# Altium project PPC_notebook_electrical_schematics_v0.7.PrjPcb (part 1 of 14)
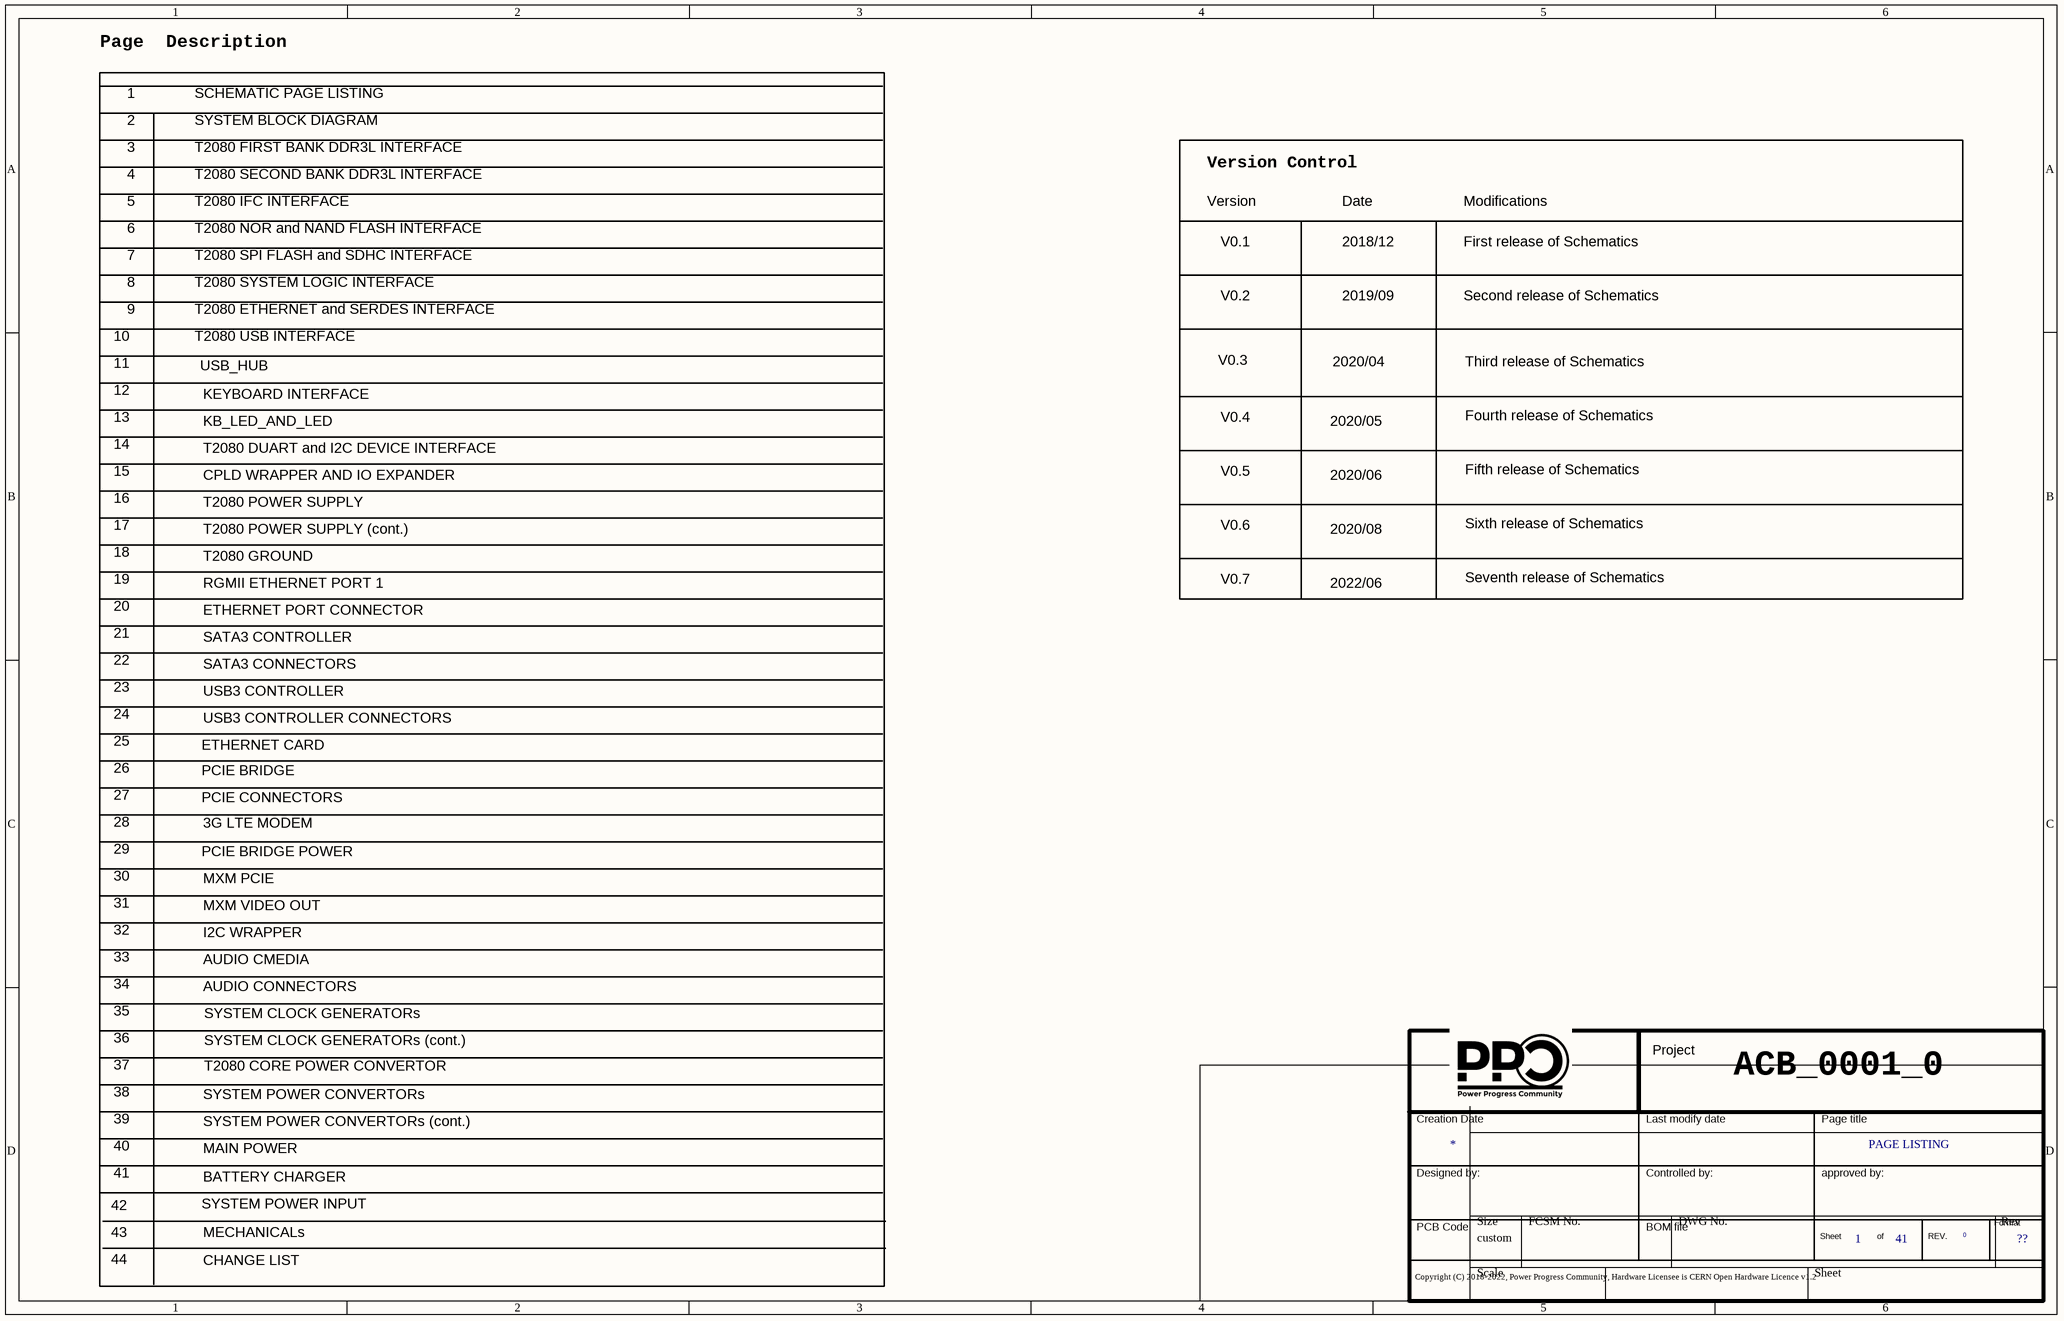
[diagram p0: 01 Page Listing.SchDoc]
44 sheets, 2242 parts. Net scope: flat (ports and power ports of the same name join across sheets).
Sheets:
  01 Page Listing.SchDoc
  02 Block Diagram.SchDoc
  03B_DDR3_2.SchDoc
  03 DDR3.SchDoc
  04 IFC.SchDoc
  05 Flash.SchDoc
  06 SPI&SDHC.SchDoc
  07 SYS.SchDoc
  08 EC&SD.SchDoc
  09A_USB_HUB.SchDoc
  09B KEYBOARD.SchDoc
  09C_KB_LED_AND_LED.SchDoc
  09 USB.SchDoc
  10B_WRAPPER.SchDoc
  10 UART&I2C.SchDoc
  11 Proc Pwr1.SchDoc
  12 Proc Pwr2.SchDoc
  13 Proc Gnd.SchDoc
  14 EC1 PHY.SchDoc
  15_ETHERNET_CONN.SchDoc
  16B Sata Connectors.SchDoc
  16 SATA3 CONTROLLER.SchDoc
  17 USB3 CONTROLLER.SchDoc
  18B_ETHERNET CARD.SchDoc
  18 USB3_ports.SchDoc
  19B WLAN_CONNECTOR.SchDoc
  19C_3G_LTE_MODEM.SchDoc
  19 PCIE BRIDGE.SchDoc
  20 PCIE BRIDGE POWER.SchDoc
  21 MXM_PCIe.SchDoc
  22 MXM_VIDEO_OUT.SchDoc
  23 I2C WRAP.SchDoc
  24 AUDIO CMEDIA.SchDoc
  25 AUDIO_CONN.SchDoc
  26 Clock 1.SchDoc
  27 Clock 2.SchDoc
  28 Core Pwr.SchDoc
  29 Other Pwr 1.SchDoc
  30A Other Pwr 2.SchDoc
  30B Main Power.SchDoc
  30C_battery_Charger.SchDoc
  31 Pwr In.SchDoc
  32 MEC.SchDoc
  33 Change List.SchDoc

## Sheet 01 Page Listing.SchDoc
size 386 x 246 mm

### Parts
(Parts that share a designator on the sheet are numbered #1, #2 ... from top to bottom, then left to right.)
*#1  Doc: PAGE LISTING  Page Count: 41  Page Number: 1  Page Size: ??  RevCode: 0  (hidden comment: Title_block_PPC)  (graphical)

### Notes on the sheet
- Page  Description
- 1
- 2
- SCHEMATIC PAGE LISTING
- SYSTEM BLOCK DIAGRAM
- 3
- 4
- T2080 FIRST BANK DDR3L INTERFACE
- T2080 SECOND BANK DDR3L INTERFACE
- Version Control
- 5
- 6
- 7
- T2080 IFC INTERFACE
- T2080 NOR and NAND FLASH INTERFACE
- T2080 SPI FLASH and SDHC INTERFACE
- Version
- V0.1
- Date
- 2018/12
- Modifications
- First release of Schematics
- 8
- 9
- T2080 SYSTEM LOGIC INTERFACE
- T2080 ETHERNET and SERDES INTERFACE
- V0.2
- 2019/09
- Second release of Schematics
- 10
- 11
- 12
- T2080 USB INTERFACE
- USB_HUB
- KEYBOARD INTERFACE
- V0.3
- 2020/04
- Third release of Schematics
- 13
- 14
- KB_LED_AND_LED
- T2080 DUART and I2C DEVICE INTERFACE
- V0.4
- 2020/05
- Fourth release of Schematics
- 15
- 16
- 17
- CPLD WRAPPER AND IO EXPANDER
- T2080 POWER SUPPLY (cont.)
- T2080 POWER SUPPLY
- V0.5
- V0.6
- 2020/06
- 2020/08
- Fifth release of Schematics
- Sixth release of Schematics
- 18
- 19
- RGMII ETHERNET PORT 1
- T2080 GROUND
- V0.7
- 2022/06
- Seventh release of Schematics
- 20
- 21
- 22
- ETHERNET PORT CONNECTOR
- SATA3 CONTROLLER
- SATA3 CONNECTORS
- 23
- 24
- USB3 CONTROLLER CONNECTORS
- USB3 CONTROLLER
- 25
- 26
- 27
- PCIE CONNECTORS
- PCIE BRIDGE
- ETHERNET CARD
- 28
- 29
- PCIE BRIDGE POWER
- 3G LTE MODEM
- 30
- 31
- 32
- MXM PCIE
- MXM VIDEO OUT
- I2C WRAPPER
- 33
- 34
- AUDIO CMEDIA
- AUDIO CONNECTORS
- 35
- 36
- 37
- T2080 CORE POWER CONVERTOR
- SYSTEM CLOCK GENERATORs (cont.)
- SYSTEM CLOCK GENERATORs
- 38
- 39
- SYSTEM POWER CONVERTORs
- SYSTEM POWER CONVERTORs (cont.)
- ACB_0001_0
- 40
- 41
- SYSTEM POWER INPUT
- MAIN POWER
- BATTERY CHARGER
- 42
- 43
- 44
- MECHANICALs
- CHANGE LIST

### Library data of the parts
*#1 = Title_block_PPC: Title: T2080PCIe; Author: MICETEK; Page Create Date: March  8, 1995; Page Title: ?; Page Modify Date: *

## Sheet 02 Block Diagram.SchDoc
size 1188 x 840 mm
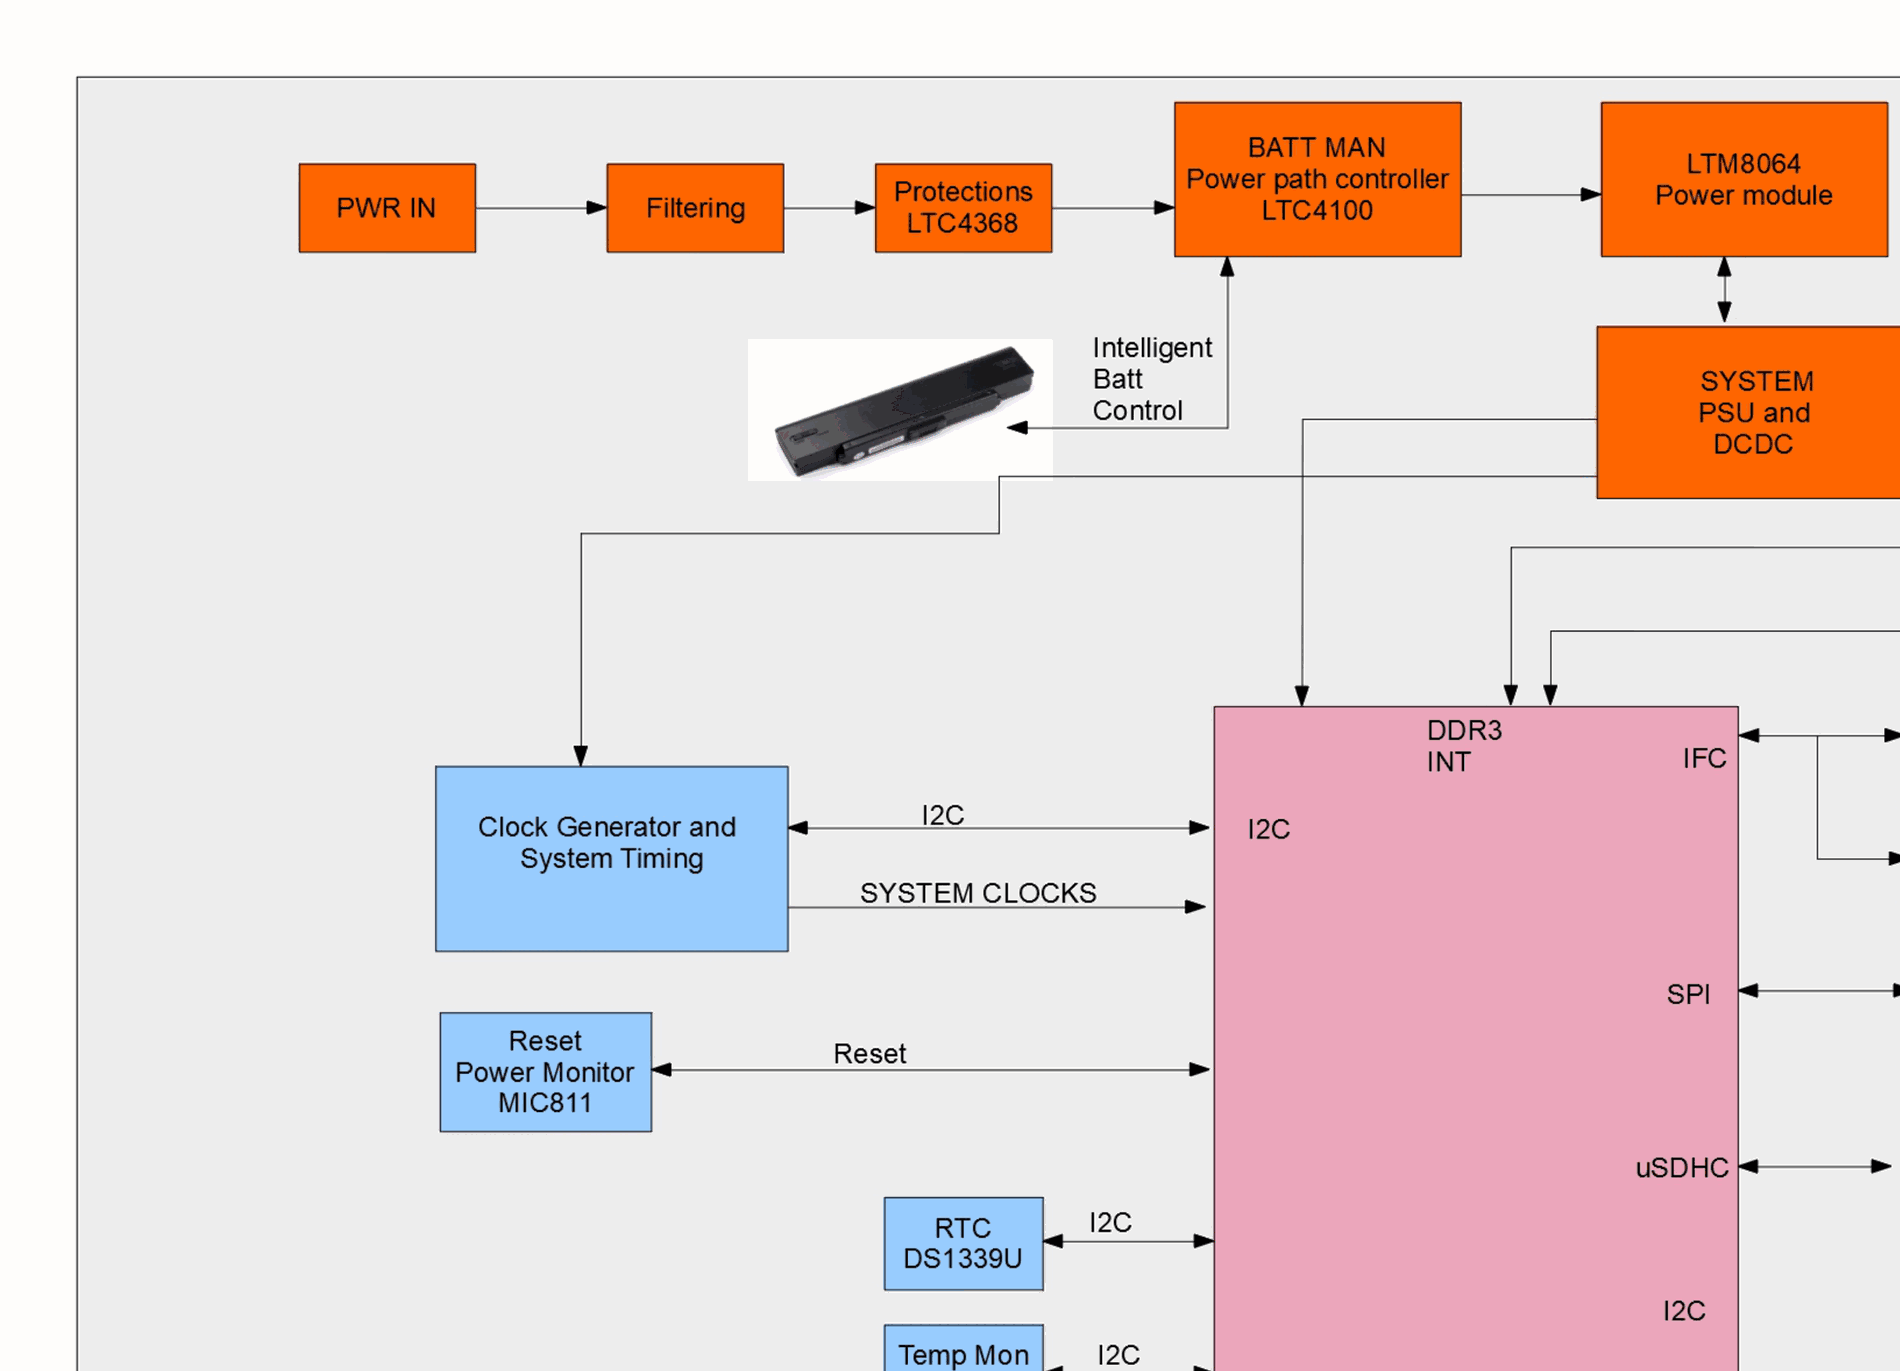
[diagram p1: 02 Block Diagram.SchDoc, top left]
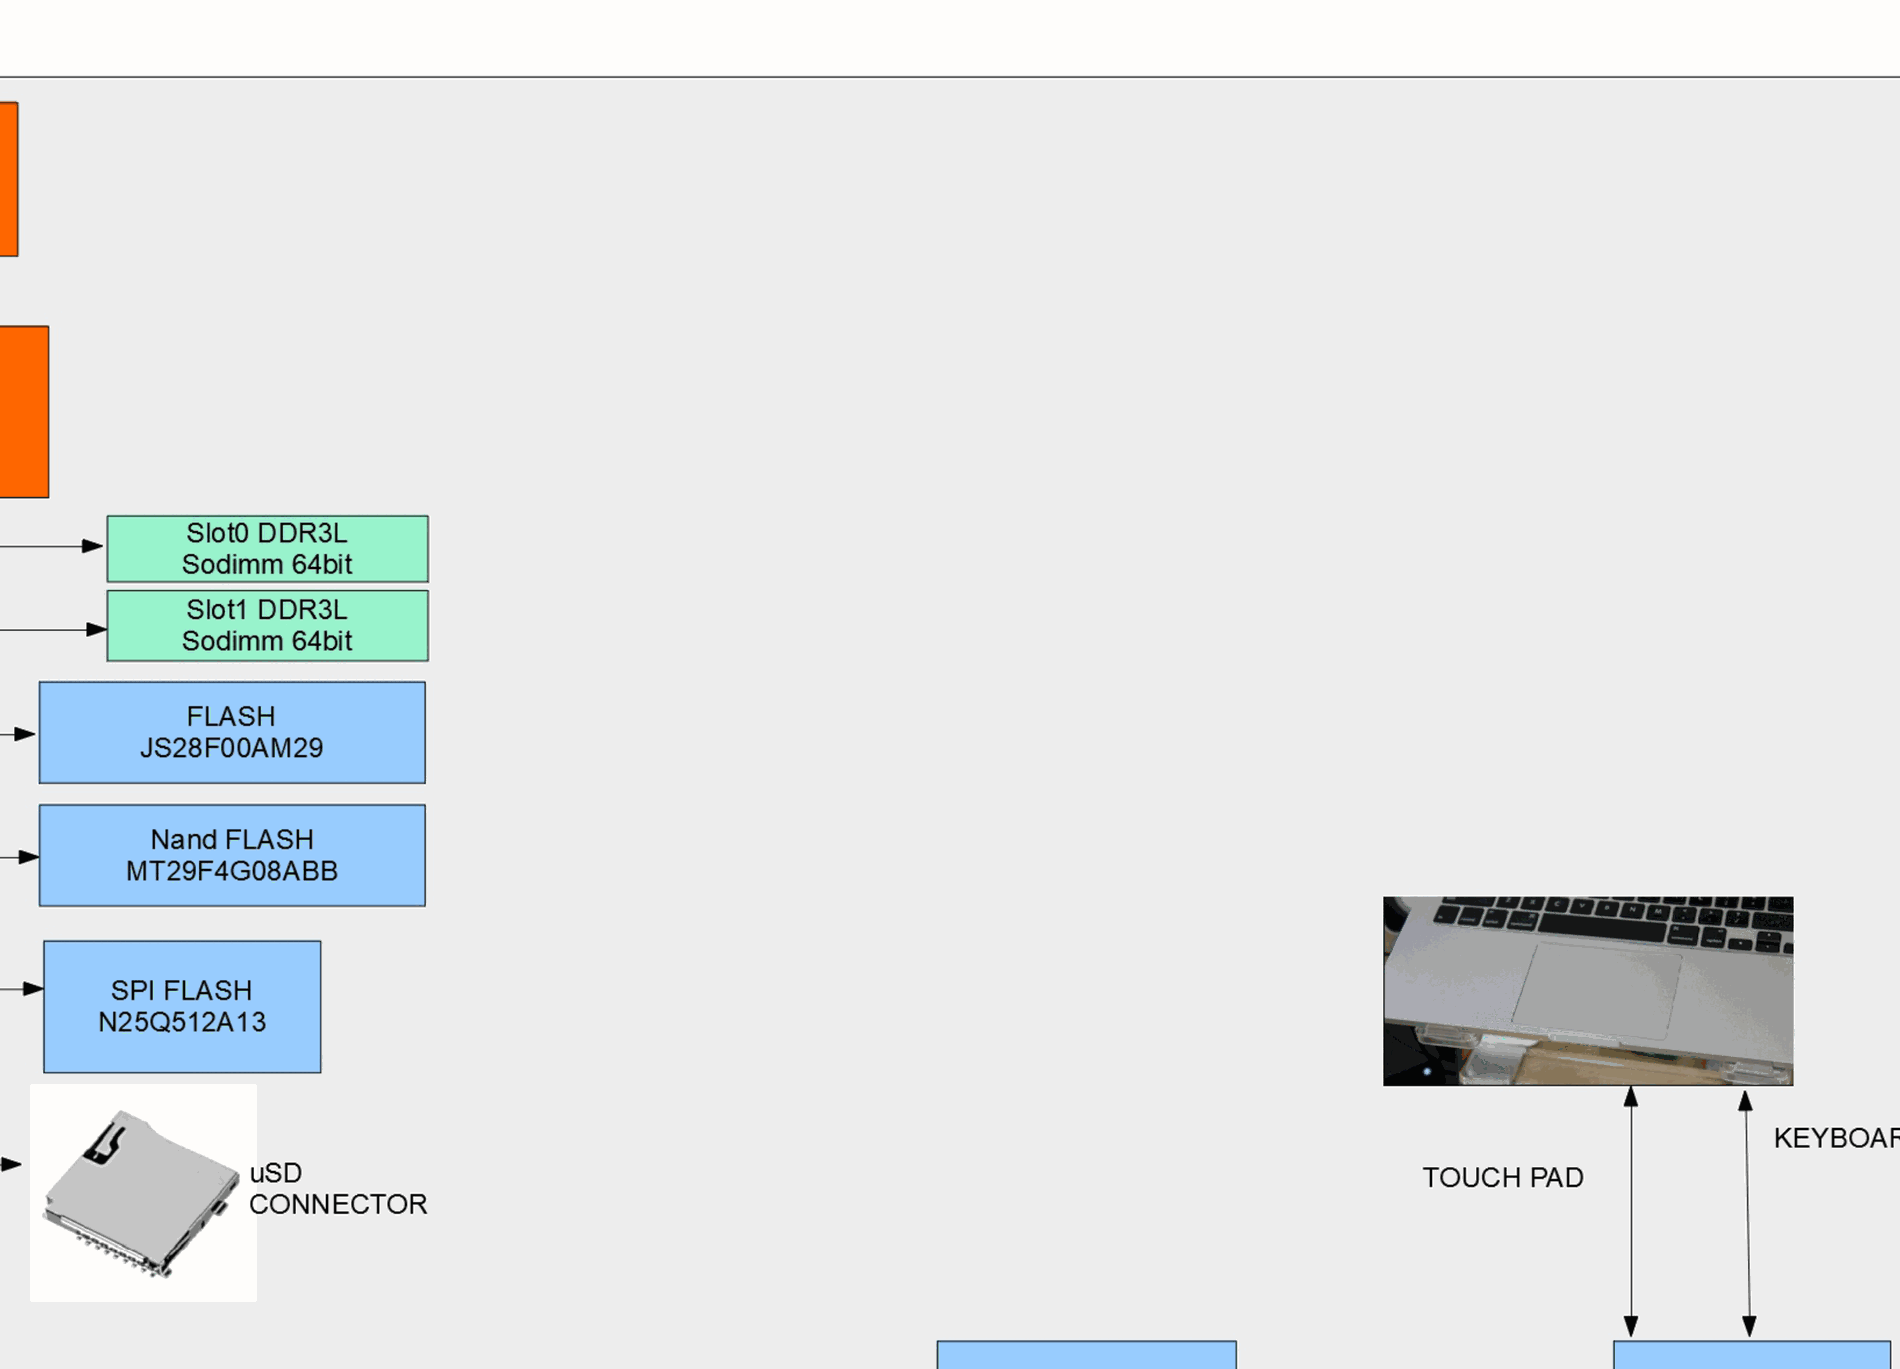
[diagram p2: 02 Block Diagram.SchDoc, top middle]
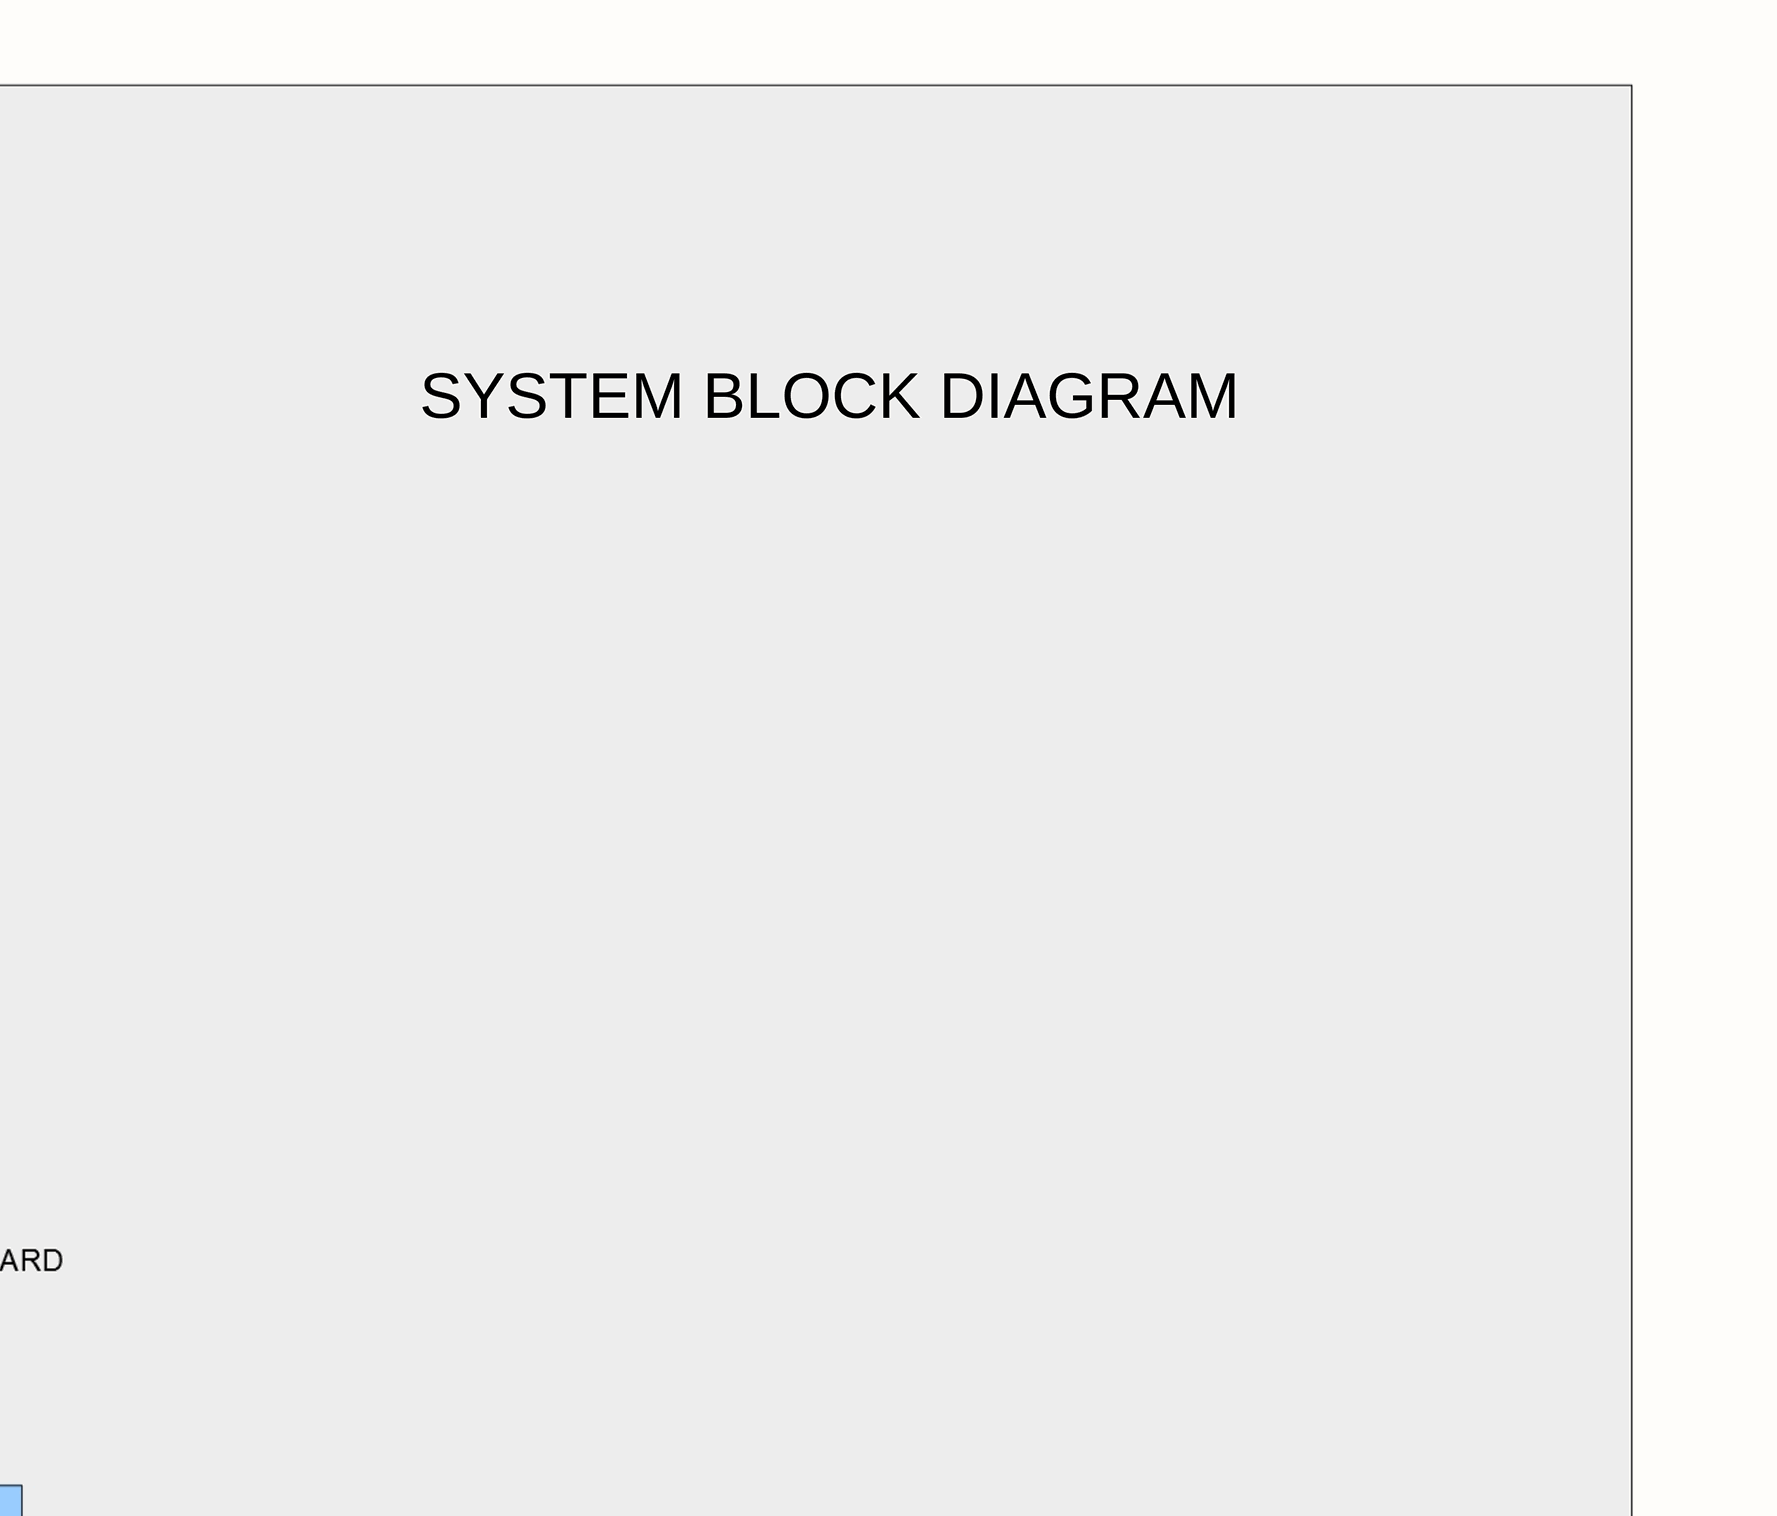
[diagram p3: 02 Block Diagram.SchDoc, top right]
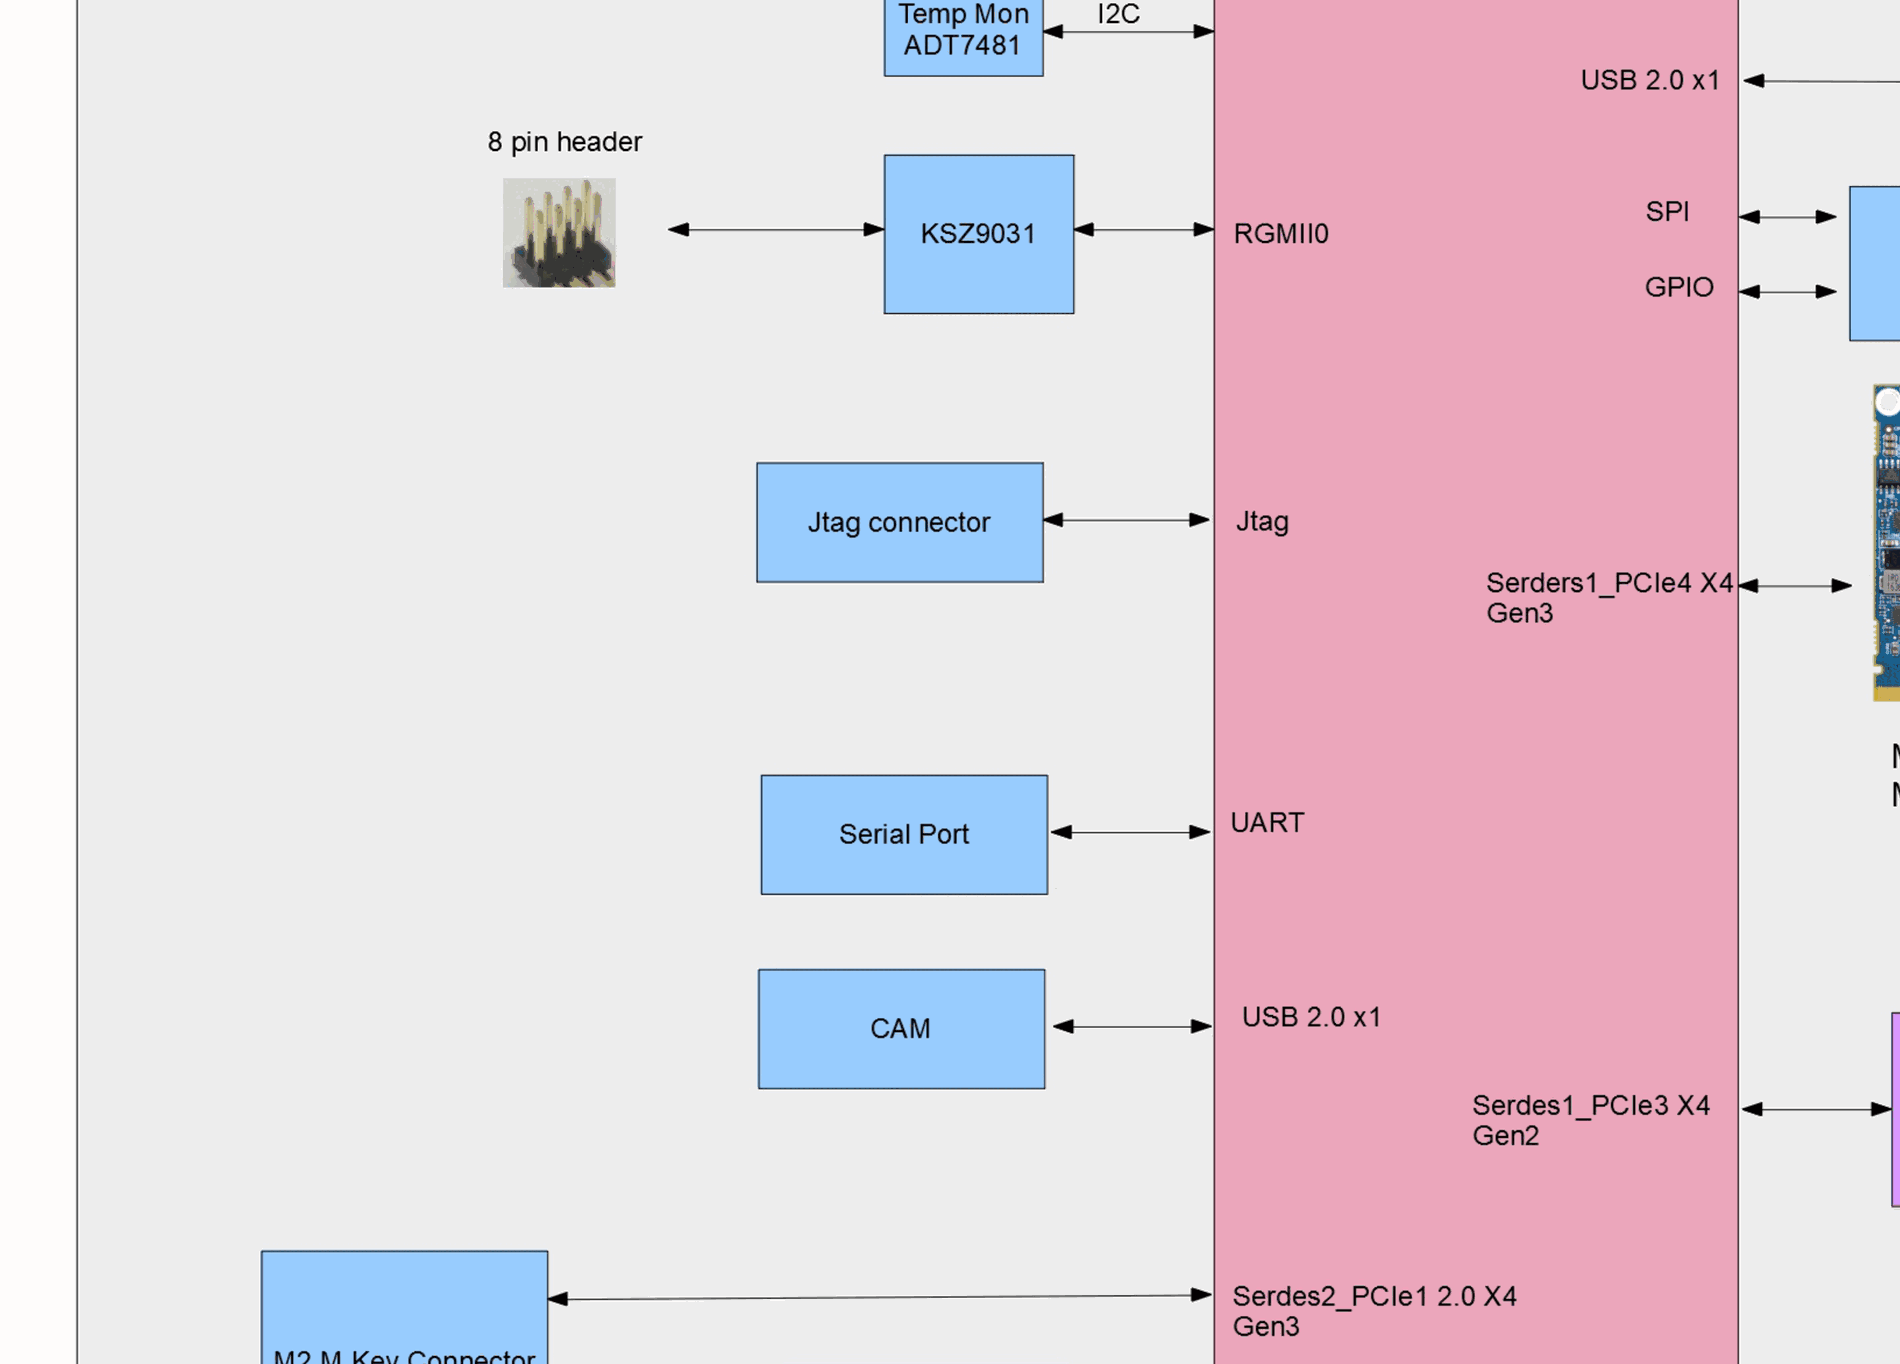
[diagram p4: 02 Block Diagram.SchDoc, centre left]
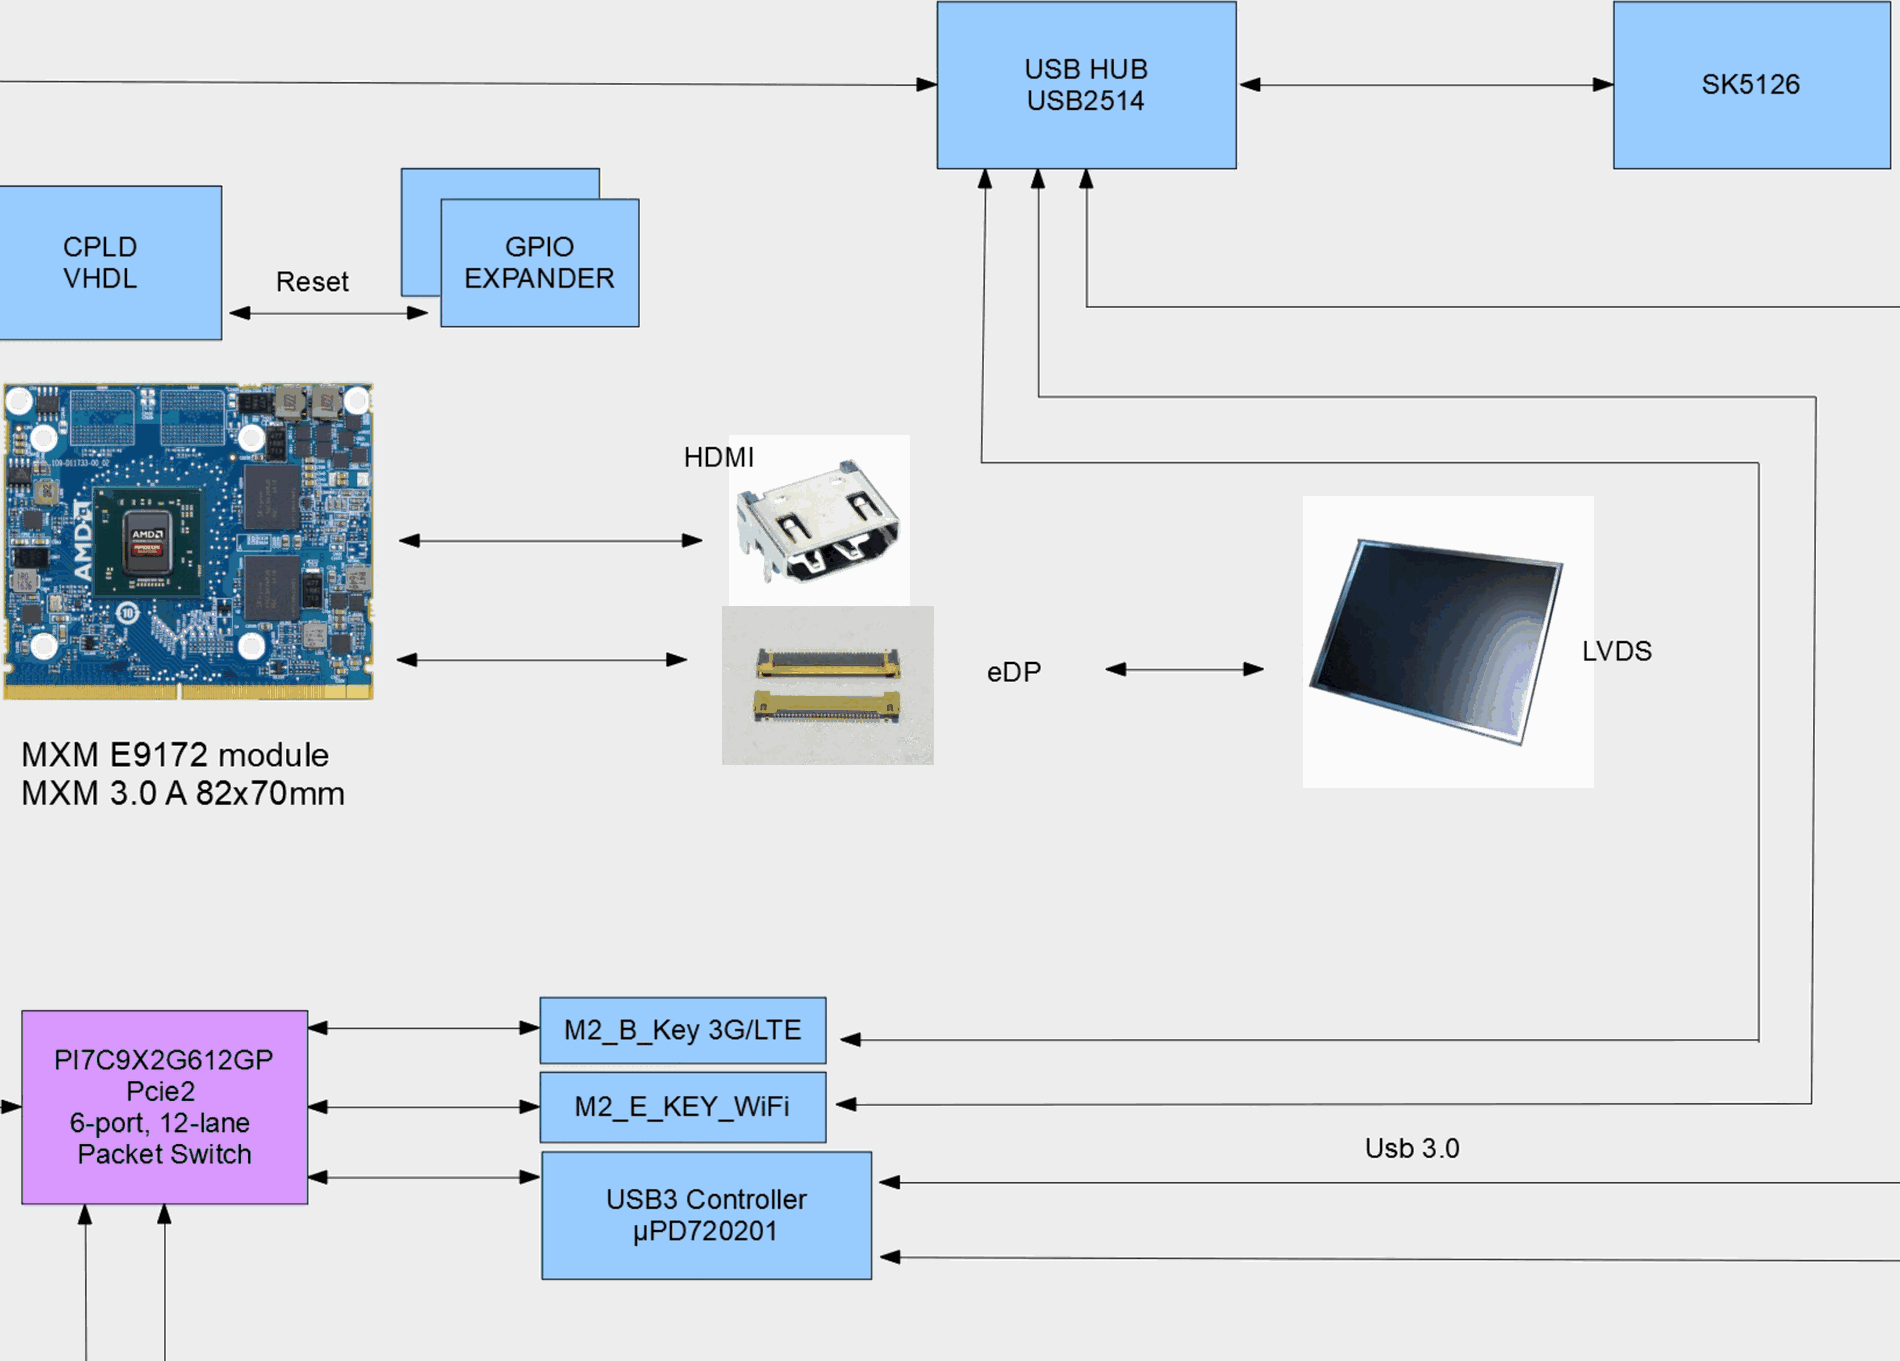
[diagram p5: 02 Block Diagram.SchDoc, centre middle]
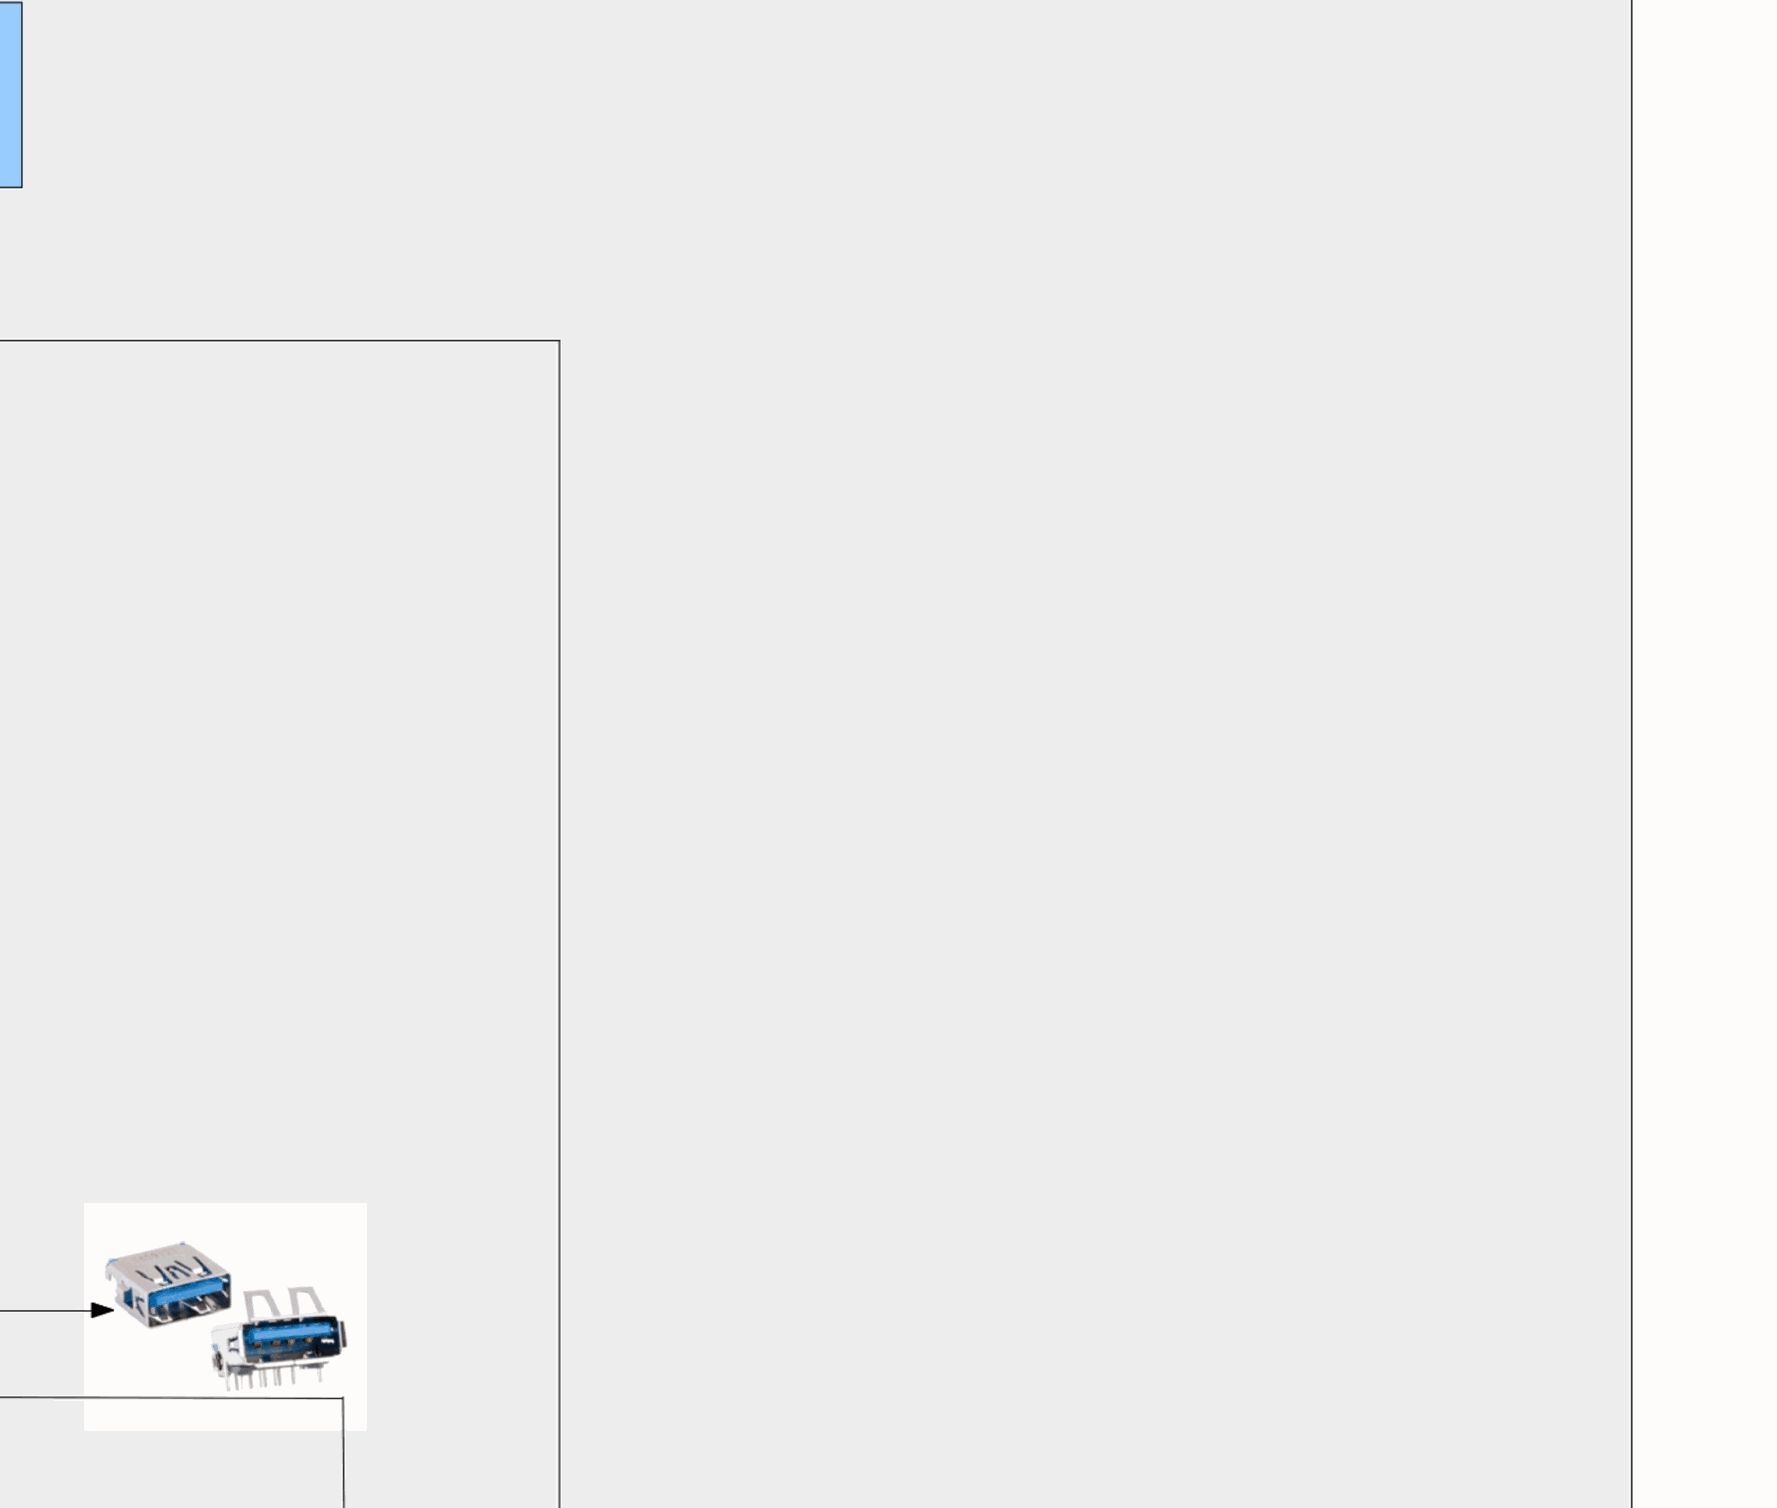
[diagram p6: 02 Block Diagram.SchDoc, centre right]
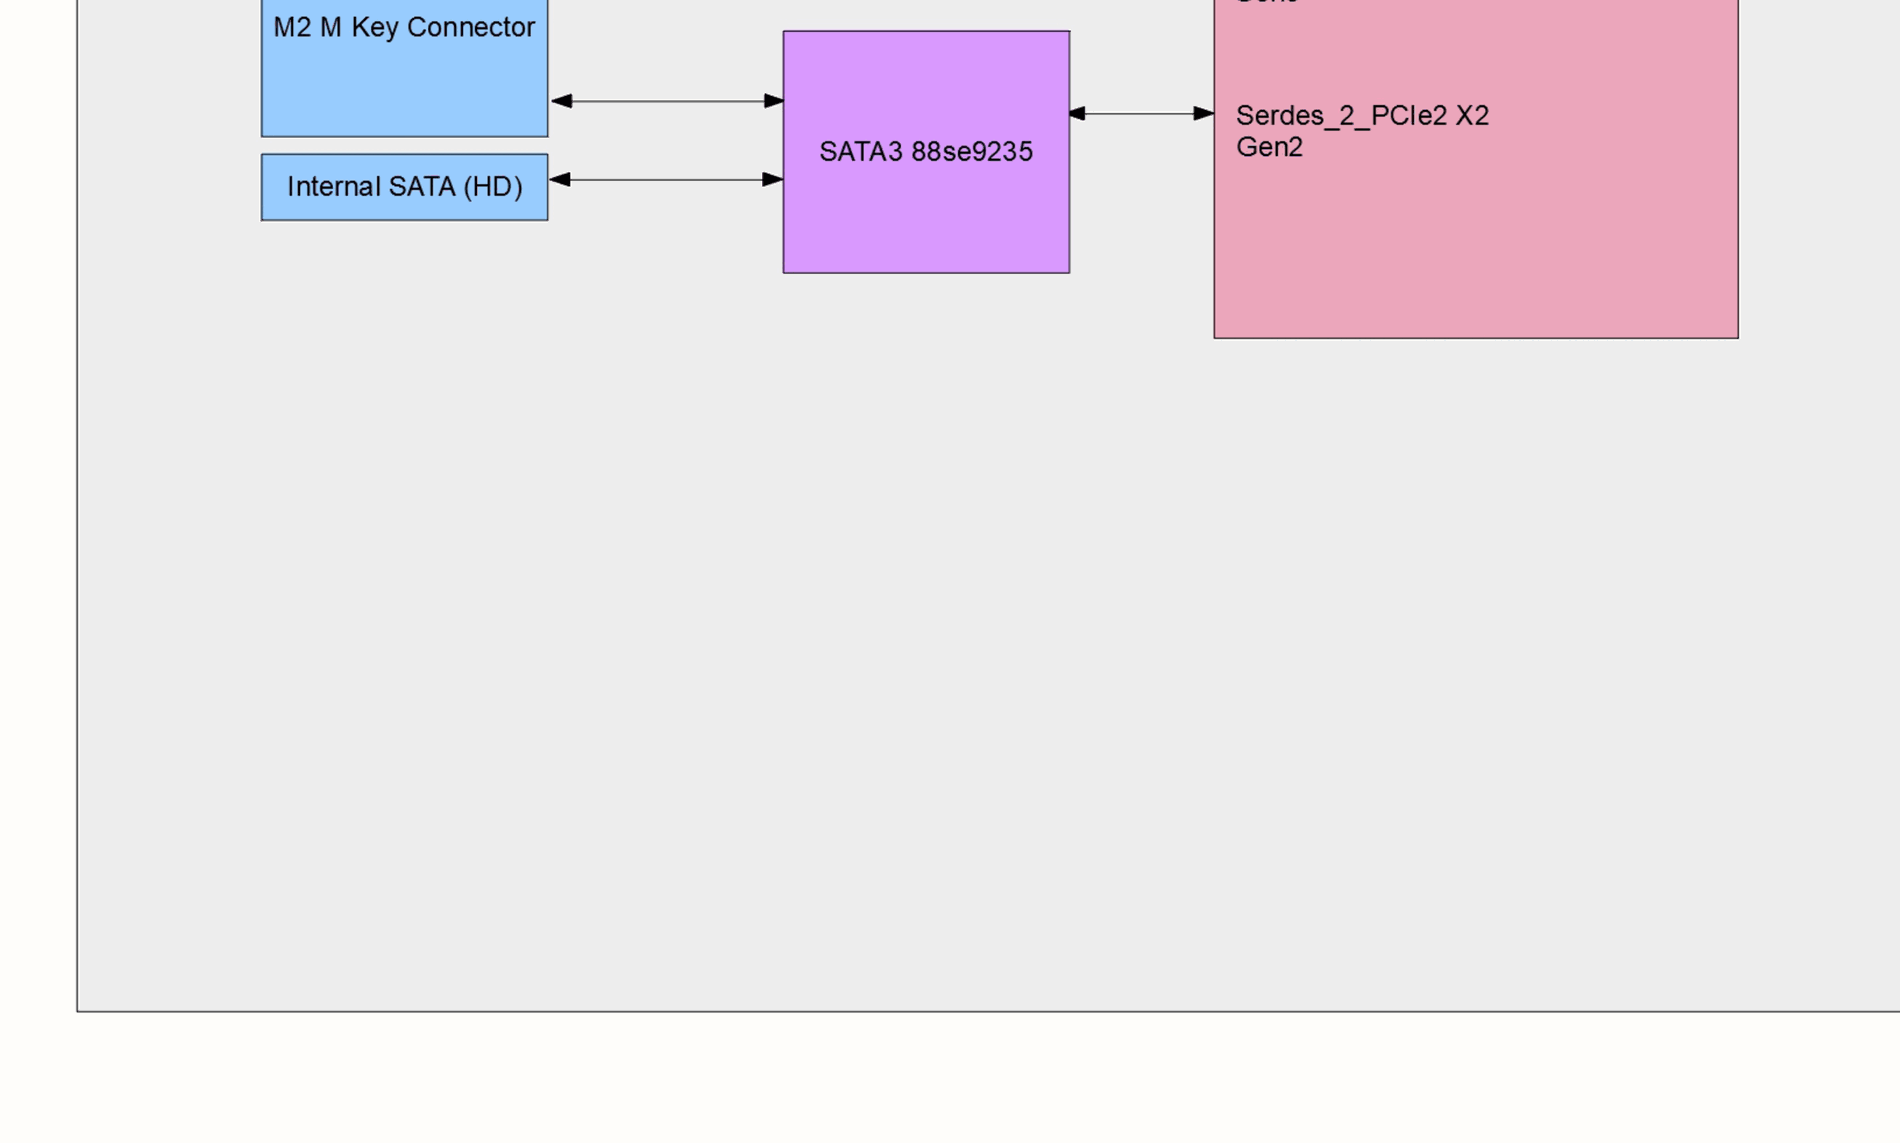
[diagram p7: 02 Block Diagram.SchDoc, bottom left]
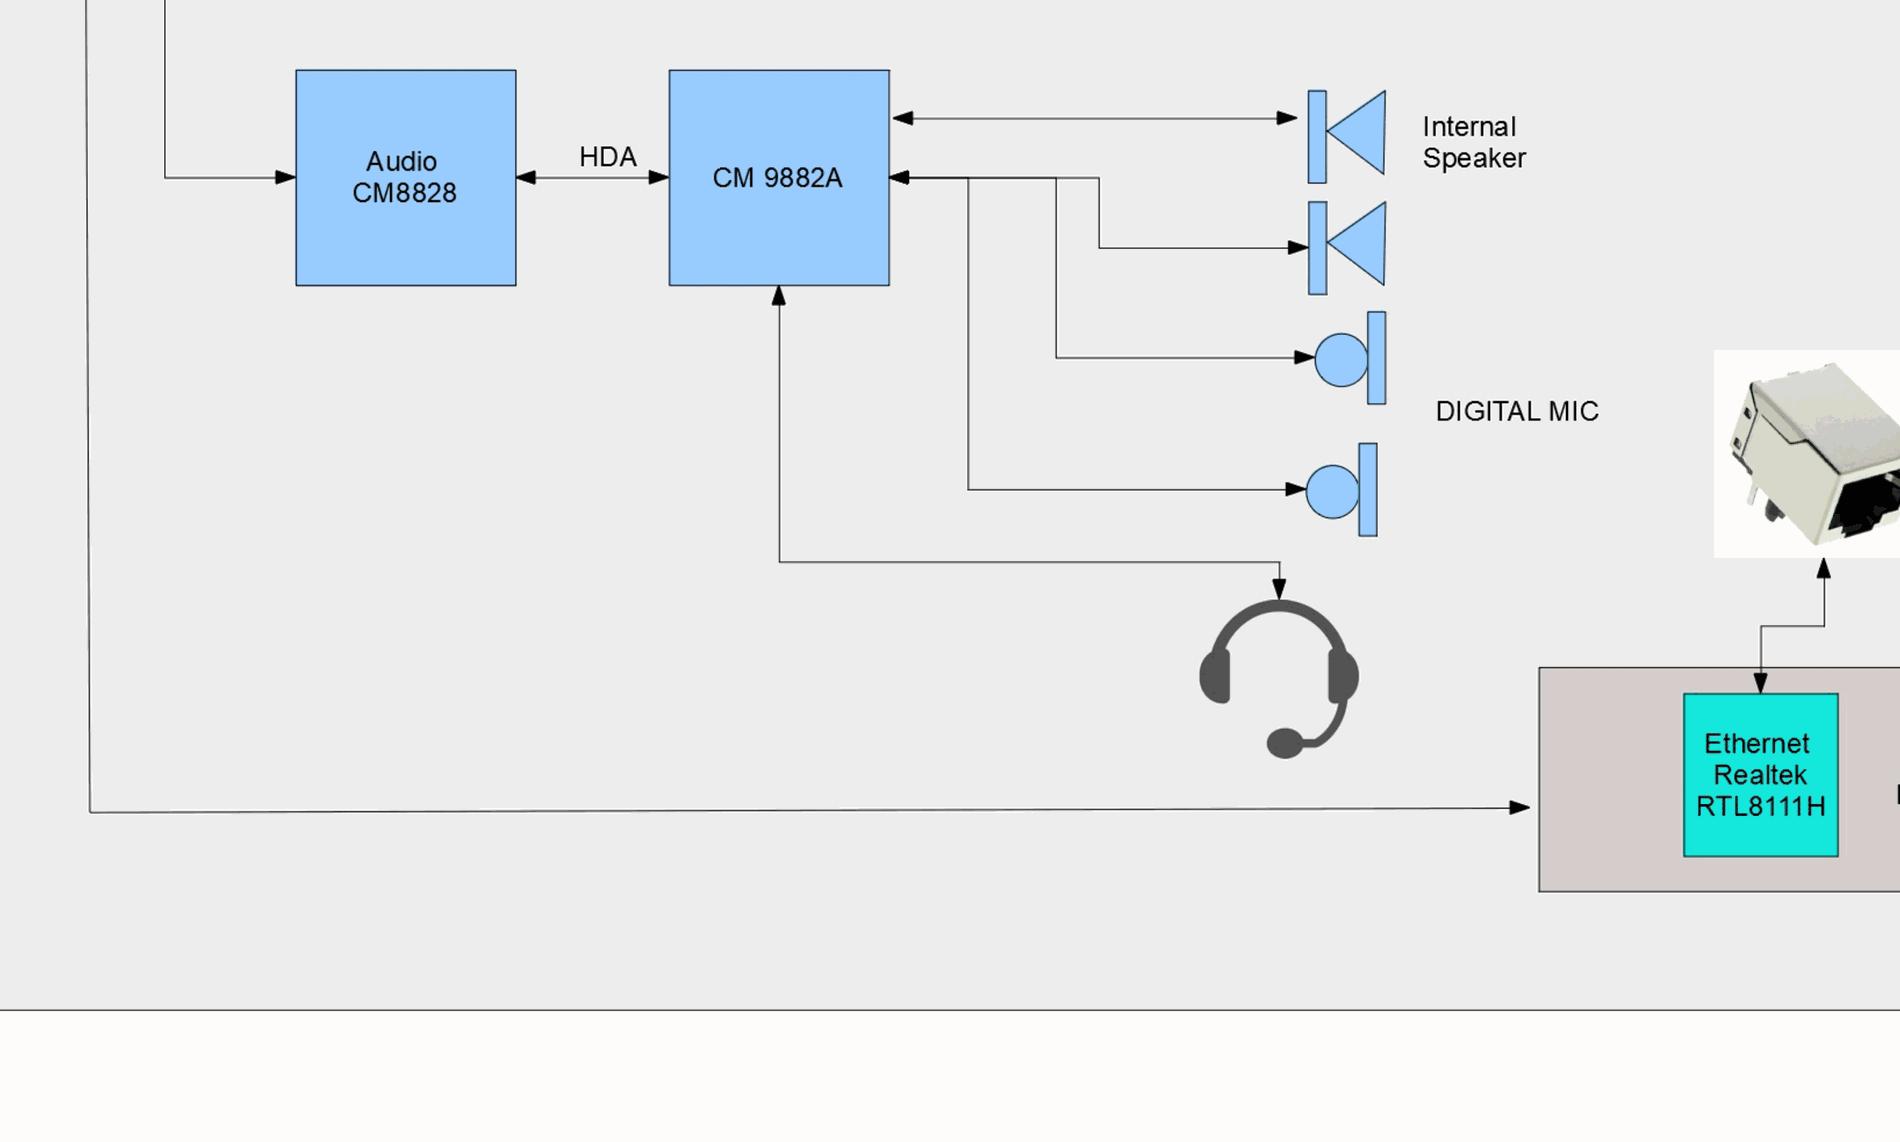
[diagram p8: 02 Block Diagram.SchDoc, bottom middle]
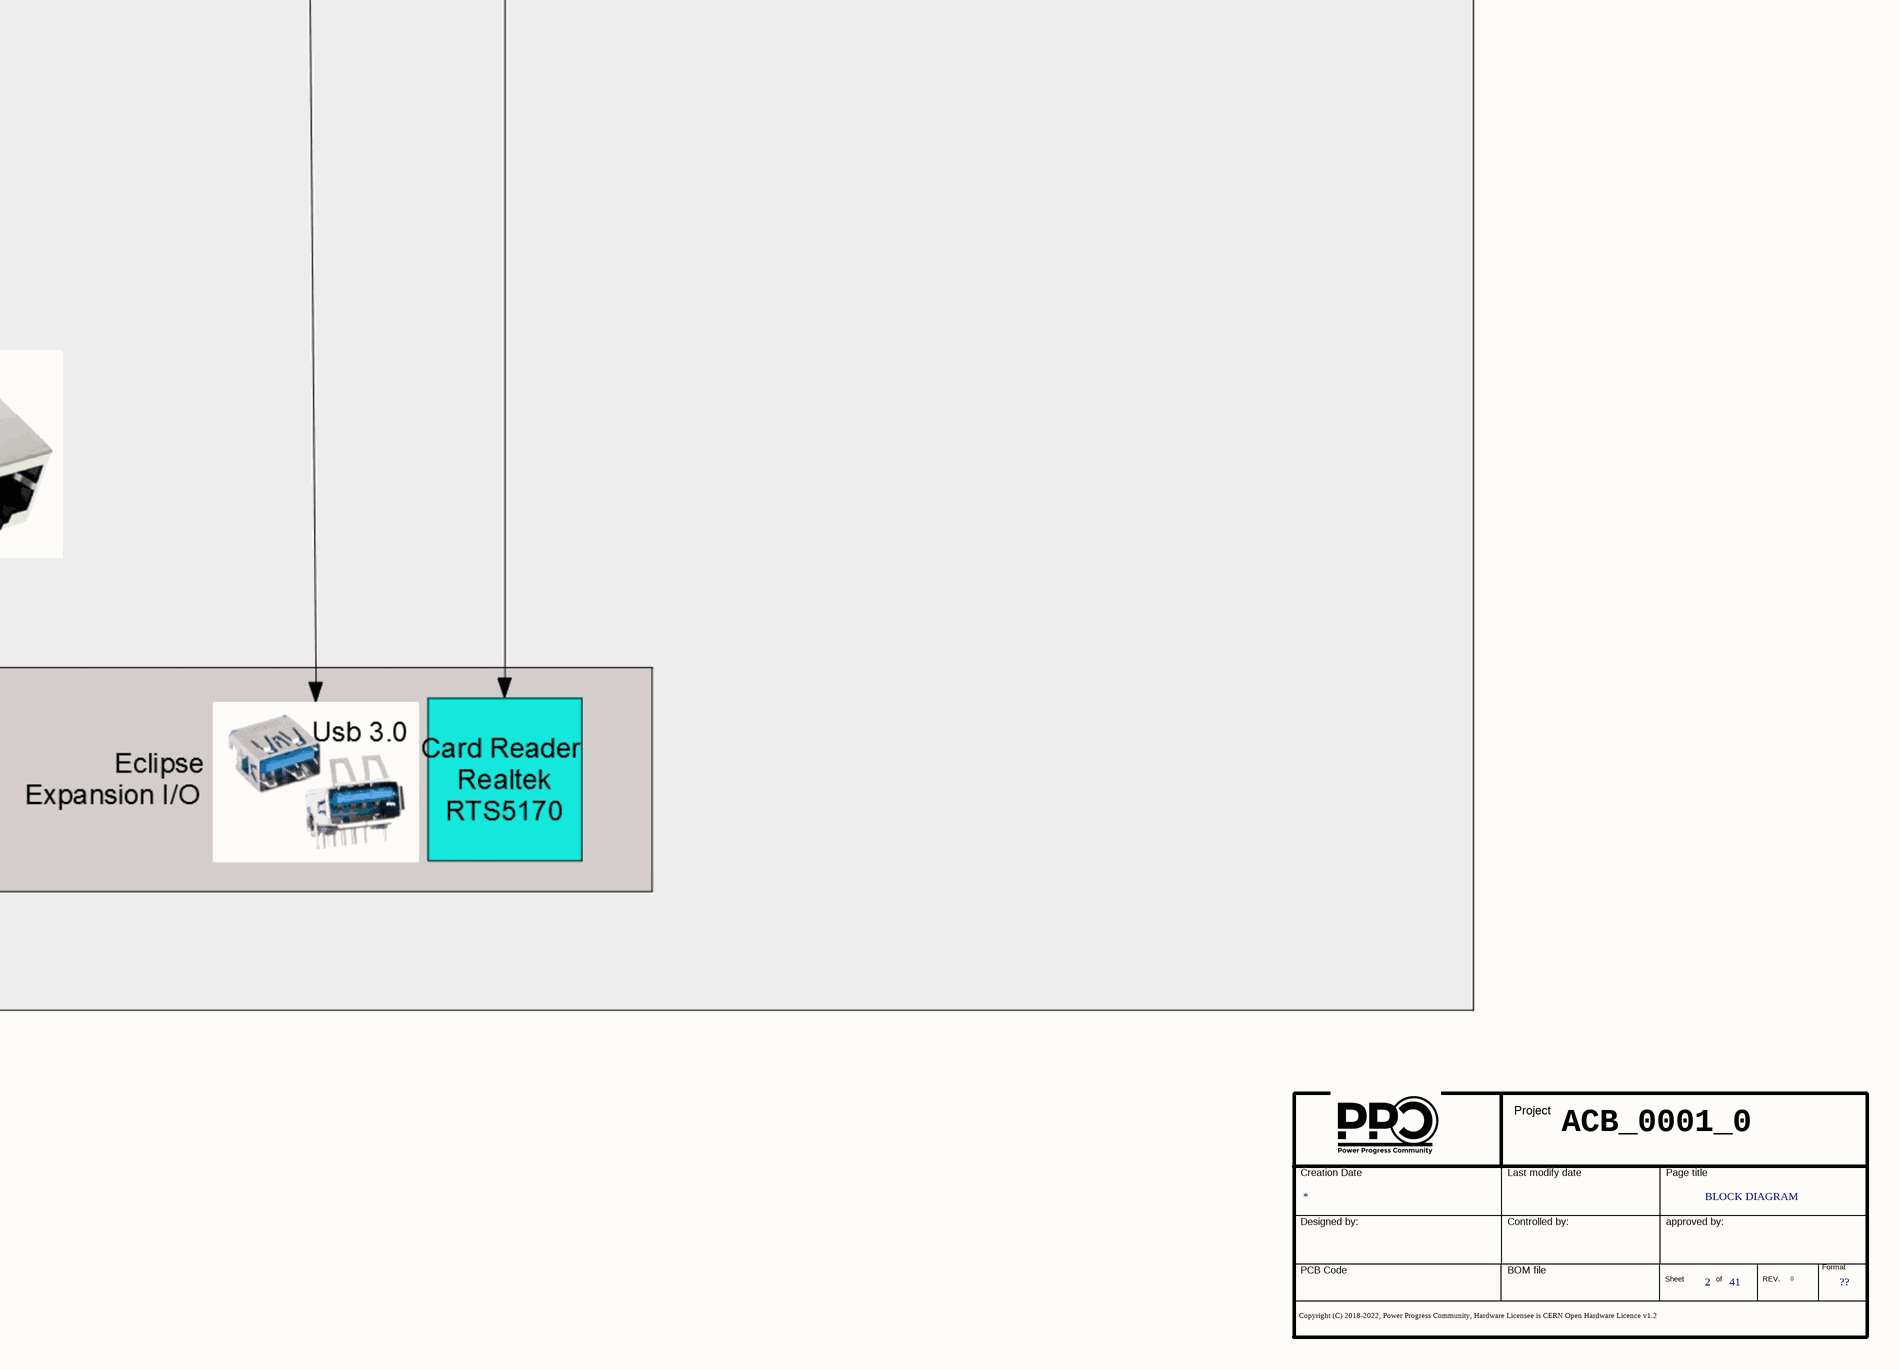
[diagram p9: 02 Block Diagram.SchDoc, bottom right]

### Parts
(Parts that share a designator on the sheet are numbered #1, #2 ... from top to bottom, then left to right.)
*#2  Doc: BLOCK DIAGRAM  Page Count: 41  Page Number: 2  Page Size: ??  RevCode: 0  (hidden comment: Title_block_PPC)  (graphical)

### Notes on the sheet
- SYSTEM BLOCK DIAGRAM
- ACB_0001_0

### Library data of the parts
*#2 = Title_block_PPC: Title: T2080PCIe; Author: MICETEK; Page Create Date: March  8, 1995; Page Title: ?; Page Modify Date: *

## Sheet 03B_DDR3_2.SchDoc
size 420 x 297 mm
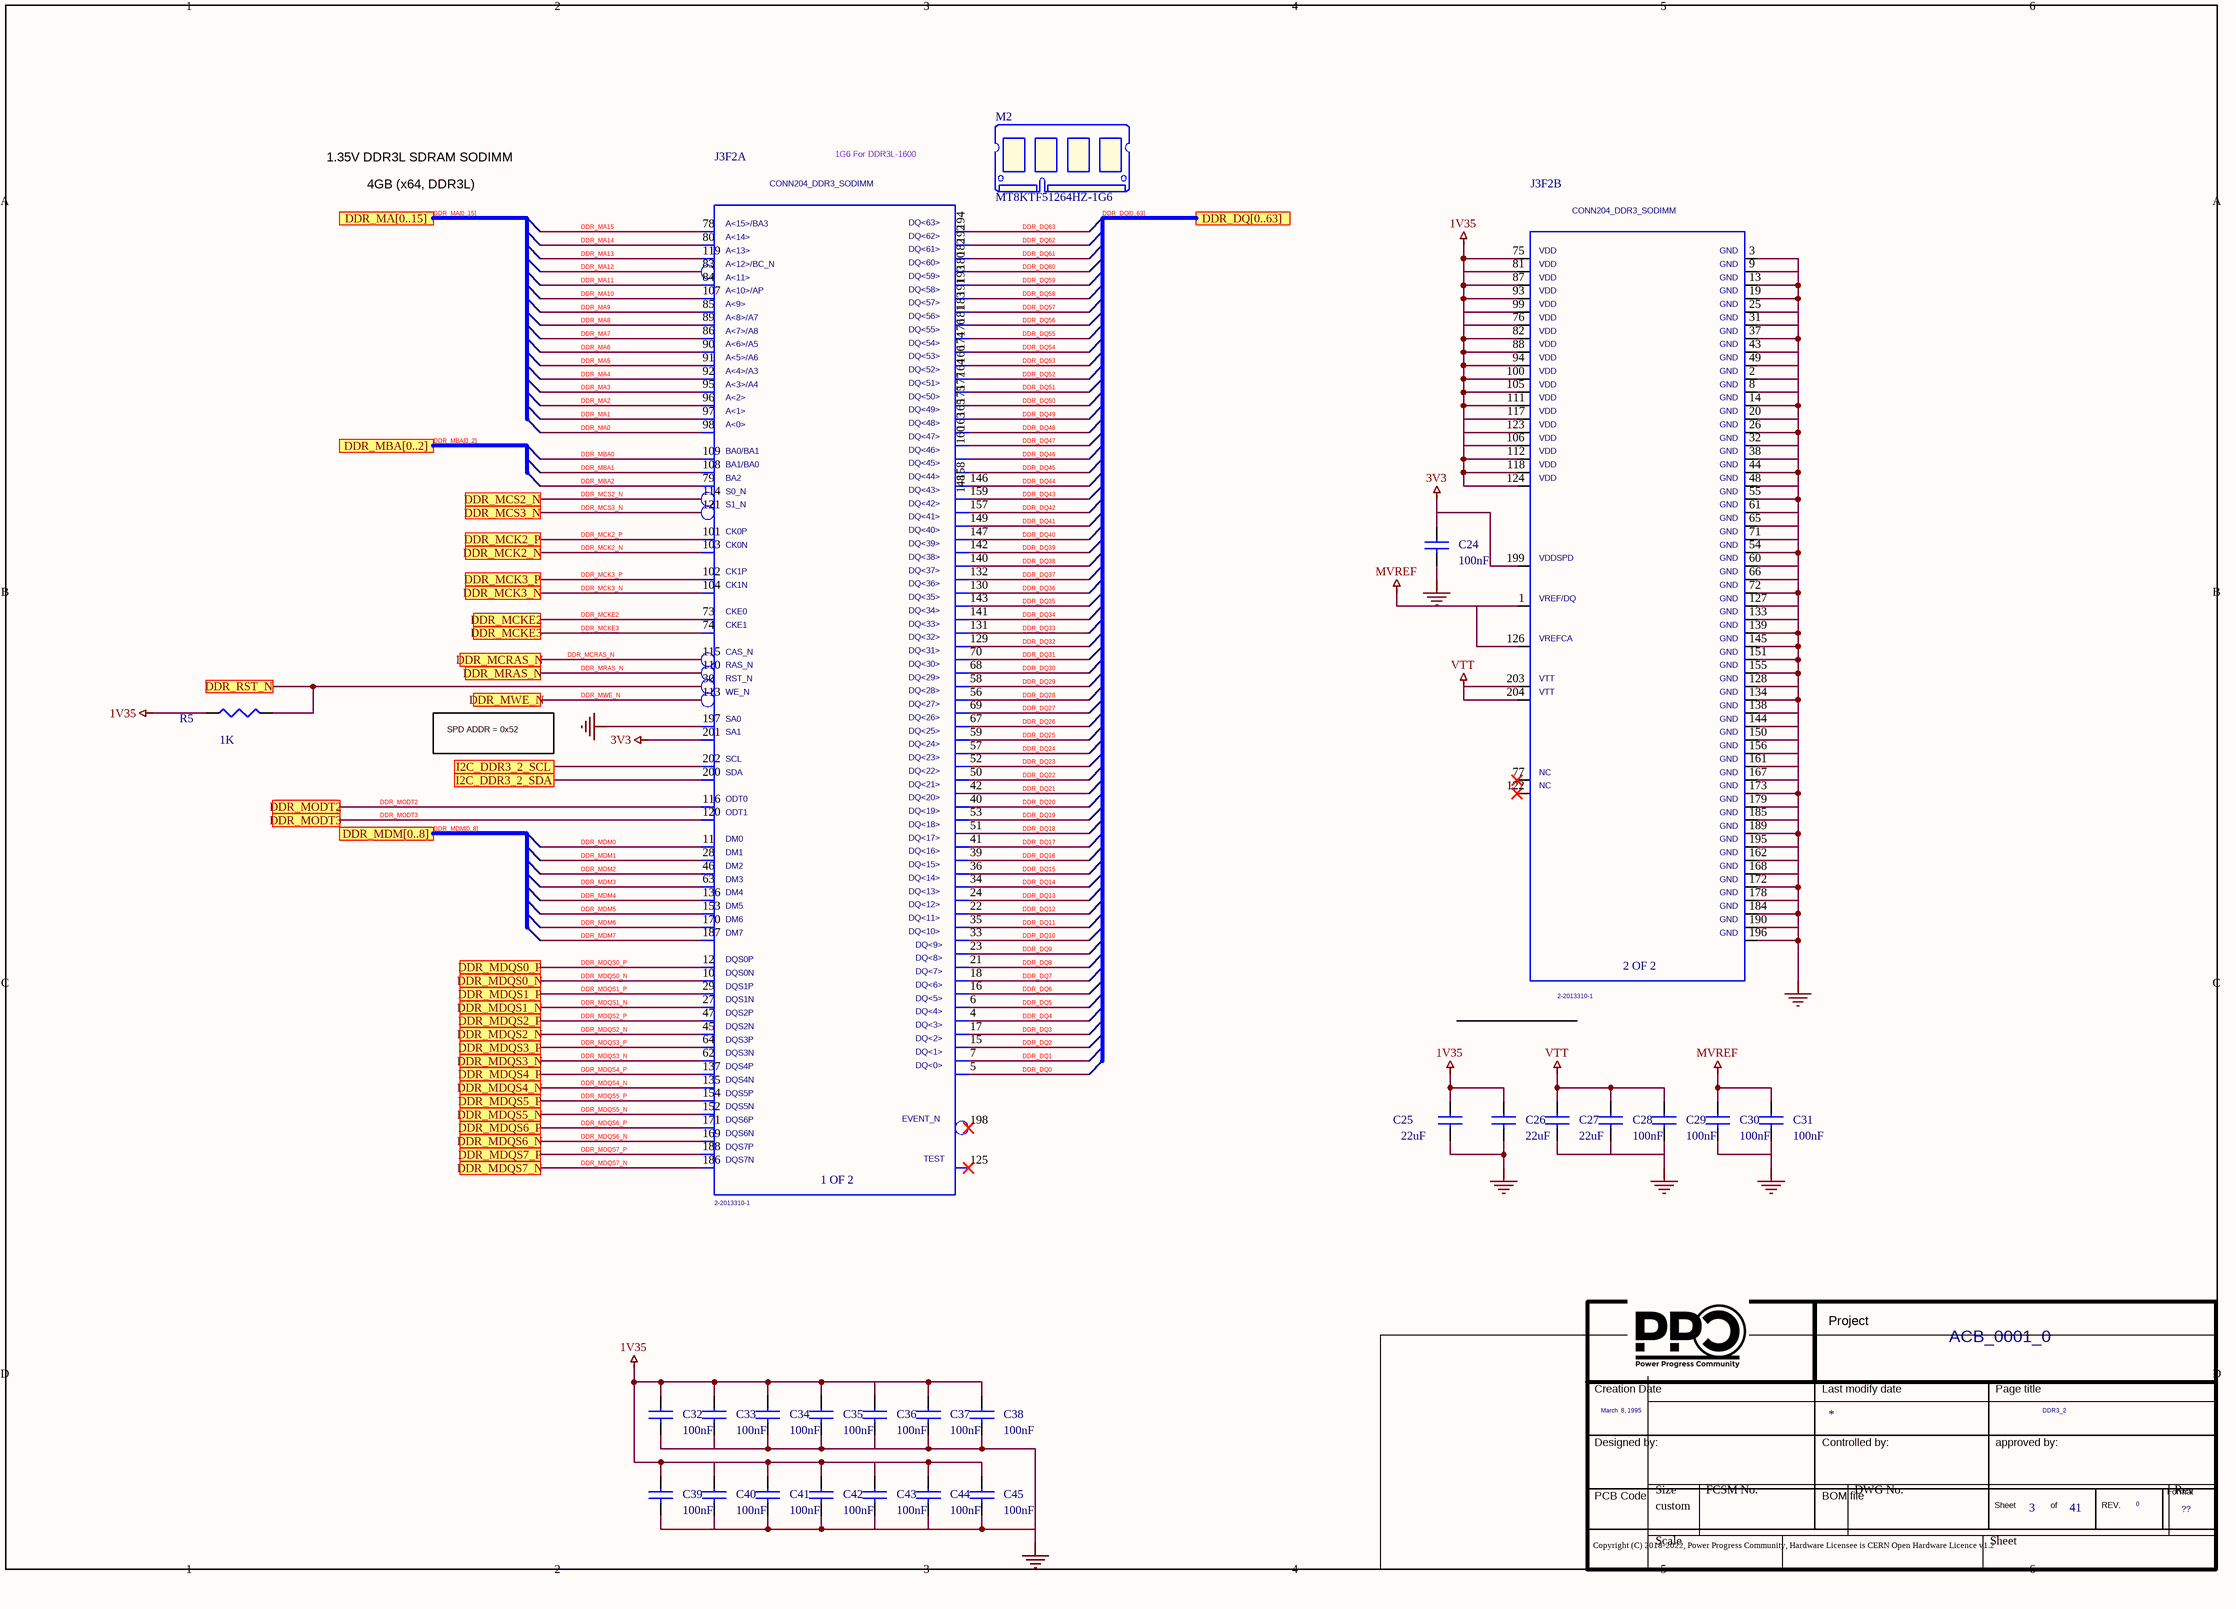
[diagram p10: 03B_DDR3_2.SchDoc]

### Parts
(Parts that share a designator on the sheet are numbered #1, #2 ... from top to bottom, then left to right.)
*#3  Page Count: 41  Page Create Date: March  8, 1995  Page Number: 3  Page Size: ??  Page Title: DDR3_2  RevCode: 0  Title: ACB_0001_0  (hidden comment: Title_block_PPC)  (graphical)
C24  100nF  [SMD_0402]
C25  22uF  [SMD_0805]
C26  22uF  [SMD_0805]
C27  22uF  [SMD_0805]
C28  100nF  [SMD_0402]
C29  100nF  [SMD_0402]
C30  100nF  [SMD_0402]
C31  100nF  [SMD_0402]
C32  100nF  [SMD_0402]
C33  100nF  [SMD_0402]
C34  100nF  [SMD_0402]
C35  100nF  [SMD_0402]
C36  100nF  [SMD_0402]
C37  100nF  [SMD_0402]
C38  100nF  [SMD_0402]
C39  100nF  [SMD_0402]
C40  100nF  [SMD_0402]
C41  100nF  [SMD_0402]
C42  100nF  [SMD_0402]
C43  100nF  [SMD_0402]
C44  100nF  [SMD_0402]
C45  100nF  [SMD_0402]
J3F2  2-2013310-1  PART_SYM_NUM: 1 OF 2  [204 PIN PASSO 0.6mm]  (parts A,B of 2)
M2  MT8KTF51264HZ-1G6  [none]
R5  1K  [SMD_0402]

### Ports
DDR_DQ[0..63], DDR_MA[0..15], DDR_MBA[0..2], DDR_MCK2_N, DDR_MCK2_P, DDR_MCK3_N, DDR_MCK3_P, DDR_MCKE2, DDR_MCKE3, DDR_MCRAS_N, DDR_MCS2_N, DDR_MCS3_N, DDR_MDM[0..8], DDR_MDQS0_N, DDR_MDQS0_P, DDR_MDQS1_N, DDR_MDQS1_P, DDR_MDQS2_N, DDR_MDQS2_P, DDR_MDQS3_N, DDR_MDQS3_P, DDR_MDQS4_N, DDR_MDQS4_P, DDR_MDQS5_N, DDR_MDQS5_P, DDR_MDQS6_N, DDR_MDQS6_P, DDR_MDQS7_N, DDR_MDQS7_P, DDR_MODT2, DDR_MODT3, DDR_MRAS_N, DDR_MWE_N, DDR_RST_N, I2C_DDR3_2_SCL, I2C_DDR3_2_SDA

### Nets
1V35: C25.1 C26.1 C32.1 C33.1 C34.1 C35.1 C36.1 C37.1 C38.1 C39.1 C40.1 C41.1 C42.1 C43.1 C44.1 C45.1 J3F2.75(VDD_75) J3F2.76(VDD_76) J3F2.81(VDD_81) J3F2.82(VDD_82) J3F2.87(VDD_87) J3F2.88(VDD_88) J3F2.93(VDD_93) J3F2.94(VDD_94) J3F2.99(VDD_99) J3F2.100(VDD_100) J3F2.105(VDD_105) J3F2.106(VDD_106) J3F2.111(VDD_111) J3F2.112(VDD_112) J3F2.117(VDD_117) J3F2.118(VDD_118) J3F2.123(VDD_123) J3F2.124(VDD_124) R5.1
3V3: C24.1 J3F2.199(VDDSPD) J3F2.201(SA1)
GND: C24.2 C25.2 C26.2 C27.2 C28.2 C29.2 C30.2 C31.2 C32.2 C33.2 C34.2 C35.2 C36.2 C37.2 C38.2 C39.2 C40.2 C41.2 C42.2 C43.2 C44.2 C45.2 J3F2.2(GND_2) J3F2.3(GND_3) J3F2.8(GND_8) J3F2.9(GND_9) J3F2.13(GND_13) J3F2.14(GND_14) J3F2.19(GND_19) J3F2.20(GND_20) J3F2.25(GND_25) J3F2.26(GND_26) J3F2.31(GND_31) J3F2.32(GND_32) J3F2.37(GND_37) J3F2.38(GND_38) J3F2.43(GND_43) J3F2.44(GND_44) J3F2.48(GND_48) J3F2.49(GND_49) J3F2.54(GND_54) J3F2.55(GND_55) J3F2.60(GND_60) J3F2.61(GND_61) J3F2.65(GND_65) J3F2.66(GND_66) J3F2.71(GND_71) J3F2.72(GND_72) J3F2.127(GND_127) J3F2.128(GND_128) J3F2.133(GND_133) J3F2.134(GND_134) J3F2.138(GND_138) J3F2.139(GND_139) J3F2.144(GND_144) J3F2.145(GND_145) J3F2.150(GND_150) J3F2.151(GND_151) J3F2.155(GND_155) J3F2.156(GND_156) J3F2.161(GND_161) J3F2.162(GND_162) J3F2.167(GND_167) J3F2.168(GND_168) J3F2.172(GND_172) J3F2.173(GND_173) J3F2.178(GND_178) J3F2.179(GND_179) J3F2.184(GND_184) J3F2.185(GND_185) J3F2.189(GND_189) J3F2.190(GND_190) J3F2.195(GND_195) J3F2.196(GND_196) J3F2.197(SA0)
MVREF: C30.1 C31.1 J3F2.1(VREF_DQ) J3F2.126(VREFCA)
VTT: C27.1 C28.1 C29.1 J3F2.203(VTT_203) J3F2.204(VTT_204)
DDR_DQ0: J3F2.5(DQ[0])
DDR_DQ1: J3F2.7(DQ[1])
DDR_DQ2: J3F2.15(DQ[2])
DDR_DQ3: J3F2.17(DQ[3])
DDR_DQ4: J3F2.4(DQ[4])
DDR_DQ5: J3F2.6(DQ[5])
DDR_DQ6: J3F2.16(DQ[6])
DDR_DQ7: J3F2.18(DQ[7])
DDR_DQ8: J3F2.21(DQ[8])
DDR_DQ9: J3F2.23(DQ[9])
DDR_DQ10: J3F2.33(DQ[10])
DDR_DQ11: J3F2.35(DQ[11])
DDR_DQ12: J3F2.22(DQ[12])
DDR_DQ13: J3F2.24(DQ[13])
DDR_DQ14: J3F2.34(DQ[14])
DDR_DQ15: J3F2.36(DQ[15])
DDR_DQ16: J3F2.39(DQ[16])
DDR_DQ17: J3F2.41(DQ[17])
DDR_DQ18: J3F2.51(DQ[18])
DDR_DQ19: J3F2.53(DQ[19])
DDR_DQ20: J3F2.40(DQ[20])
DDR_DQ21: J3F2.42(DQ[21])
DDR_DQ22: J3F2.50(DQ[22])
DDR_DQ23: J3F2.52(DQ[23])
DDR_DQ24: J3F2.57(DQ[24])
DDR_DQ25: J3F2.59(DQ[25])
DDR_DQ26: J3F2.67(DQ[26])
DDR_DQ27: J3F2.69(DQ[27])
DDR_DQ28: J3F2.56(DQ[28])
DDR_DQ29: J3F2.58(DQ[29])
DDR_DQ30: J3F2.68(DQ[30])
DDR_DQ31: J3F2.70(DQ[31])
DDR_DQ32: J3F2.129(DQ[32])
DDR_DQ33: J3F2.131(DQ[33])
DDR_DQ34: J3F2.141(DQ[34])
DDR_DQ35: J3F2.143(DQ[35])
DDR_DQ36: J3F2.130(DQ[36])
DDR_DQ37: J3F2.132(DQ[37])
DDR_DQ38: J3F2.140(DQ[38])
DDR_DQ39: J3F2.142(DQ[39])
DDR_DQ40: J3F2.147(DQ[40])
DDR_DQ41: J3F2.149(DQ[41])
DDR_DQ42: J3F2.157(DQ[42])
DDR_DQ43: J3F2.159(DQ[43])
DDR_DQ44: J3F2.146(DQ[44])
DDR_DQ45: J3F2.148(DQ[45])
DDR_DQ46: J3F2.158(DQ[46])
DDR_DQ47: J3F2.160(DQ[47])
DDR_DQ48: J3F2.163(DQ[48])
DDR_DQ49: J3F2.165(DQ[49])
DDR_DQ50: J3F2.175(DQ[50])
DDR_DQ51: J3F2.177(DQ[51])
DDR_DQ52: J3F2.164(DQ[52])
DDR_DQ53: J3F2.166(DQ[53])
DDR_DQ54: J3F2.174(DQ[54])
DDR_DQ55: J3F2.176(DQ[55])
DDR_DQ56: J3F2.181(DQ[56])
DDR_DQ57: J3F2.183(DQ[57])
DDR_DQ58: J3F2.191(DQ[58])
DDR_DQ59: J3F2.193(DQ[59])
DDR_DQ60: J3F2.180(DQ[60])
DDR_DQ61: J3F2.182(DQ[61])
DDR_DQ62: J3F2.192(DQ[62])
DDR_DQ63: J3F2.194(DQ[63])
DDR_MA0: J3F2.98(A[0])
DDR_MA1: J3F2.97(A[1])
DDR_MA2: J3F2.96(A[2])
DDR_MA3: J3F2.95(A[3])
DDR_MA4: J3F2.92(A[4])
DDR_MA5: J3F2.91(A[5])
DDR_MA6: J3F2.90(A[6])
DDR_MA7: J3F2.86(A[7])
DDR_MA8: J3F2.89(A[8])
DDR_MA9: J3F2.85(A[9])
DDR_MA10: J3F2.107(A[10])
DDR_MA11: J3F2.84(A[11])
DDR_MA12: J3F2.83(A[12])
DDR_MA13: J3F2.119(A[13])
DDR_MA14: J3F2.80(A[14])
DDR_MA15: J3F2.78(A[15])
DDR_MBA0: J3F2.109(BA0_BA1)
DDR_MBA1: J3F2.108(BA1_BA0)
DDR_MBA2: J3F2.79(BA2)
DDR_MCK2_N: J3F2.103(CK0N) ; port DDR_MCK2_N
DDR_MCK2_P: J3F2.101(CK0P) ; port DDR_MCK2_P
DDR_MCK3_N: J3F2.104(CK1N) ; port DDR_MCK3_N
DDR_MCK3_P: J3F2.102(CK1P) ; port DDR_MCK3_P
DDR_MCKE2: J3F2.73(CKE0) ; port DDR_MCKE2
DDR_MCKE3: J3F2.74(CKE1) ; port DDR_MCKE3
DDR_MCRAS_N: J3F2.115(CAS_N) ; port DDR_MCRAS_N
DDR_MCS2_N: J3F2.114(S0_N) ; port DDR_MCS2_N
DDR_MCS3_N: J3F2.121(S1_N) ; port DDR_MCS3_N
DDR_MDM0: J3F2.11(DM0)
DDR_MDM1: J3F2.28(DM1)
DDR_MDM2: J3F2.46(DM2)
DDR_MDM3: J3F2.63(DM3)
DDR_MDM4: J3F2.136(DM4)
DDR_MDM5: J3F2.153(DM5)
DDR_MDM6: J3F2.170(DM6)
DDR_MDM7: J3F2.187(DM7)
DDR_MDQS0_N: J3F2.10(DQS0N) ; port DDR_MDQS0_N
DDR_MDQS0_P: J3F2.12(DQS0P) ; port DDR_MDQS0_P
DDR_MDQS1_N: J3F2.27(DQS1N) ; port DDR_MDQS1_N
DDR_MDQS1_P: J3F2.29(DQS1P) ; port DDR_MDQS1_P
DDR_MDQS2_N: J3F2.45(DQS2N) ; port DDR_MDQS2_N
DDR_MDQS2_P: J3F2.47(DQS2P) ; port DDR_MDQS2_P
DDR_MDQS3_N: J3F2.62(DQS3N) ; port DDR_MDQS3_N
DDR_MDQS3_P: J3F2.64(DQS3P) ; port DDR_MDQS3_P
DDR_MDQS4_N: J3F2.135(DQS4N) ; port DDR_MDQS4_N
DDR_MDQS4_P: J3F2.137(DQS4P) ; port DDR_MDQS4_P
DDR_MDQS5_N: J3F2.152(DQS5N) ; port DDR_MDQS5_N
DDR_MDQS5_P: J3F2.154(DQS5P) ; port DDR_MDQS5_P
DDR_MDQS6_N: J3F2.169(DQS6N) ; port DDR_MDQS6_N
DDR_MDQS6_P: J3F2.171(DQS6P) ; port DDR_MDQS6_P
DDR_MDQS7_N: J3F2.186(DQS7N) ; port DDR_MDQS7_N
DDR_MDQS7_P: J3F2.188(DQS7P) ; port DDR_MDQS7_P
DDR_MODT2: J3F2.116(ODT0) ; port DDR_MODT2
DDR_MODT3: J3F2.120(ODT1) ; port DDR_MODT3
DDR_MRAS_N: J3F2.110(RAS_N) ; port DDR_MRAS_N
DDR_MWE_N: J3F2.113(WE_N) ; port DDR_MWE_N
NetJ3F1_30: J3F2.30(RST_N) R5.2 ; port DDR_RST_N
NetJ3F2_200: J3F2.200(SDA) ; port I2C_DDR3_2_SDA
NetJ3F2_202: J3F2.202(SCL) ; port I2C_DDR3_2_SCL

Not connected (* = marked no-connect by the designer): J3F2 77(NC_77)* 122(NC_122)* 125(TEST)* 198(EVENT_N)*

### Buses and harness runs
bus DDR_DQ[0..63] = port DDR_DQ[0..63]
bus DDR_MA[0..15] = port DDR_MA[0..15]
bus DDR_MBA[0..2] = port DDR_MBA[0..2]
bus DDR_MDM[0..8] = port DDR_MDM[0..8]

### Notes on the sheet
- 1.35V DDR3L SDRAM SODIMM
- 4GB (x64, DDR3L)
- 1G6 For DDR3L-1600
- SPD ADDR = 0x52
- (in symbol CONN204_DDR3_SODIMM, part A) A<15>/BA3; DQ<63>; A<14>; DQ<62>; A<13>; DQ<61>; A<12>/BC_N; DQ<60>; A<11>; DQ<59>; A<10>/AP; DQ<58>; A<9>; DQ<57>; A<8>/A7; DQ<56>; A<7>/A8; DQ<55>; A<6>/A5; DQ<54>; A<5>/A6; DQ<53>; A<4>/A3; DQ<52>; A<3>/A4; DQ<51>; A<2>; DQ<50>; A<1>; DQ<49>; A<0>; DQ<48>; DQ<47>; BA0/BA1; DQ<46>; BA1/BA0; DQ<45>; DQ<44>; DQ<43>; DQ<42>; DQ<41>; DQ<40>; DQ<39>; DQ<38>; DQ<37>; DQ<36>; DQ<35>; DQ<34>; DQ<33>; DQ<32>; DQ<31>; DQ<30>; DQ<29>; DQ<28>; DQ<27>; DQ<26>; DQ<25>; DQ<24>; DQ<23>; DQ<22>; DQ<21>; DQ<20>; DQ<19>; DQ<18>; DQ<17>; DQ<16>; DQ<15>; DQ<14>; DQ<13>; DQ<12>; DQ<11>; DQ<10>; DQ<9>; DQ<8>; DQ<7>; DQ<6>; DQ<5>; DQ<4>; DQ<3>; DQ<2>; DQ<1>; DQ<0>
- (in symbol CONN204_DDR3_SODIMM, part B) VDD; GND; VREF/DQ; VTT; NC

### Library data of the parts
C24 C28-C45 = CAP NP_Dup3: COND.CER. 100NF 50V 0402 X7R SMD; Part Number: PASSIVE_24; Manufacturer 1: TDK; Manufacturer Part Number 1: CGA2B3X7R1H104M050BD; RSM: RC0402; Part Type: Capacitors\Ceramic\SMD\0402; PCB Footprint: SMD_0402
C25 = CAP NP_Dup3: 22UF 35V 20% 0805; Part Number: PASSIVE_224; Manufacturer 1: TDK; Manufacturer Part Number 1: C2012X5R1V226M125AC; RSM: RC0805; PCB Footprint: SMD_0805; Part Type: Capacitors\Ceramic\SMD\0805
C26 C27 = CAP NP_Dup3: 22UF 35V 20% 0805; Manufacturer Part Number 1: C2012X5R1V226M125AC; Manufacturer 1: TDK; Part Number: PASSIVE_224; RSM: RC0805; PCB Footprint: SMD_0805; Part Type: Capacitors\Ceramic\SMD\0805
J3F2 = CONN204_DDR3_SODIMM: DIMM EMBOSS TAPE DDR3 204P 9.2H STD; PART_NUMBER: E85705-003; Manufacturer 1: TE; Part Number: CONNECTORS_696; CDS_PART_NAME: CONN204_DDR3_SODIMM_SMLF-E85705-003; OriginalSymbolOrigin: (-500,1850); PACK_TYPE: SMLF; RSM: TE-2-2013310-1; CDS_LIB: lf_for_review_only; DRAWING: @OXBOW_HILL_LIB.OXBOW_HILL(SCH_1):PAGE284; LOCATION: J3F1; PHYS_PAGE: 28; ROT: 0; VER: 1; XY: (900,1475); CaptureCellPackProp: CONN204_DDR3_SODIMMA; MATERIAL: CONN; PCB Footprint: 204 PIN PASSO 0.6mm; Distributor 1: MOUSER(571-2-2013310-1); Manufacturer Part Number 1: 2-2013310-1; Part Type: DIMM; CDS_PHYS_PART_NAME: CONN204_DDR3_SODIMM_SMLF-E85705-003; CHIPS_PART_NAME: CONN204_DDR3_SODIMM; SEC_TYPE: SMLF
M2 = DDR_MDL: MPN: MT18KSF51272HZ-1G6; Vendor: Micron; PCB Footprint: none; TYPE: MEC
R5 = R_Dup6: RESIS.CHIP 1K 1% 0402 SMD; Manufacturer 1: ROYAL OHM; Part Number: PASSIVE_628; RSM: RC0402; Manufacturer Part Number 1: RESIS.CHIP 1K 1% 0402 SMD; Part Type: Resistors\Fixed\SMD\0402\1%; PCB Footprint: SMD_0402
*#3 = Title_block_PPC: Page Modify Date: *

## Sheet 03 DDR3.SchDoc
size 420 x 297 mm
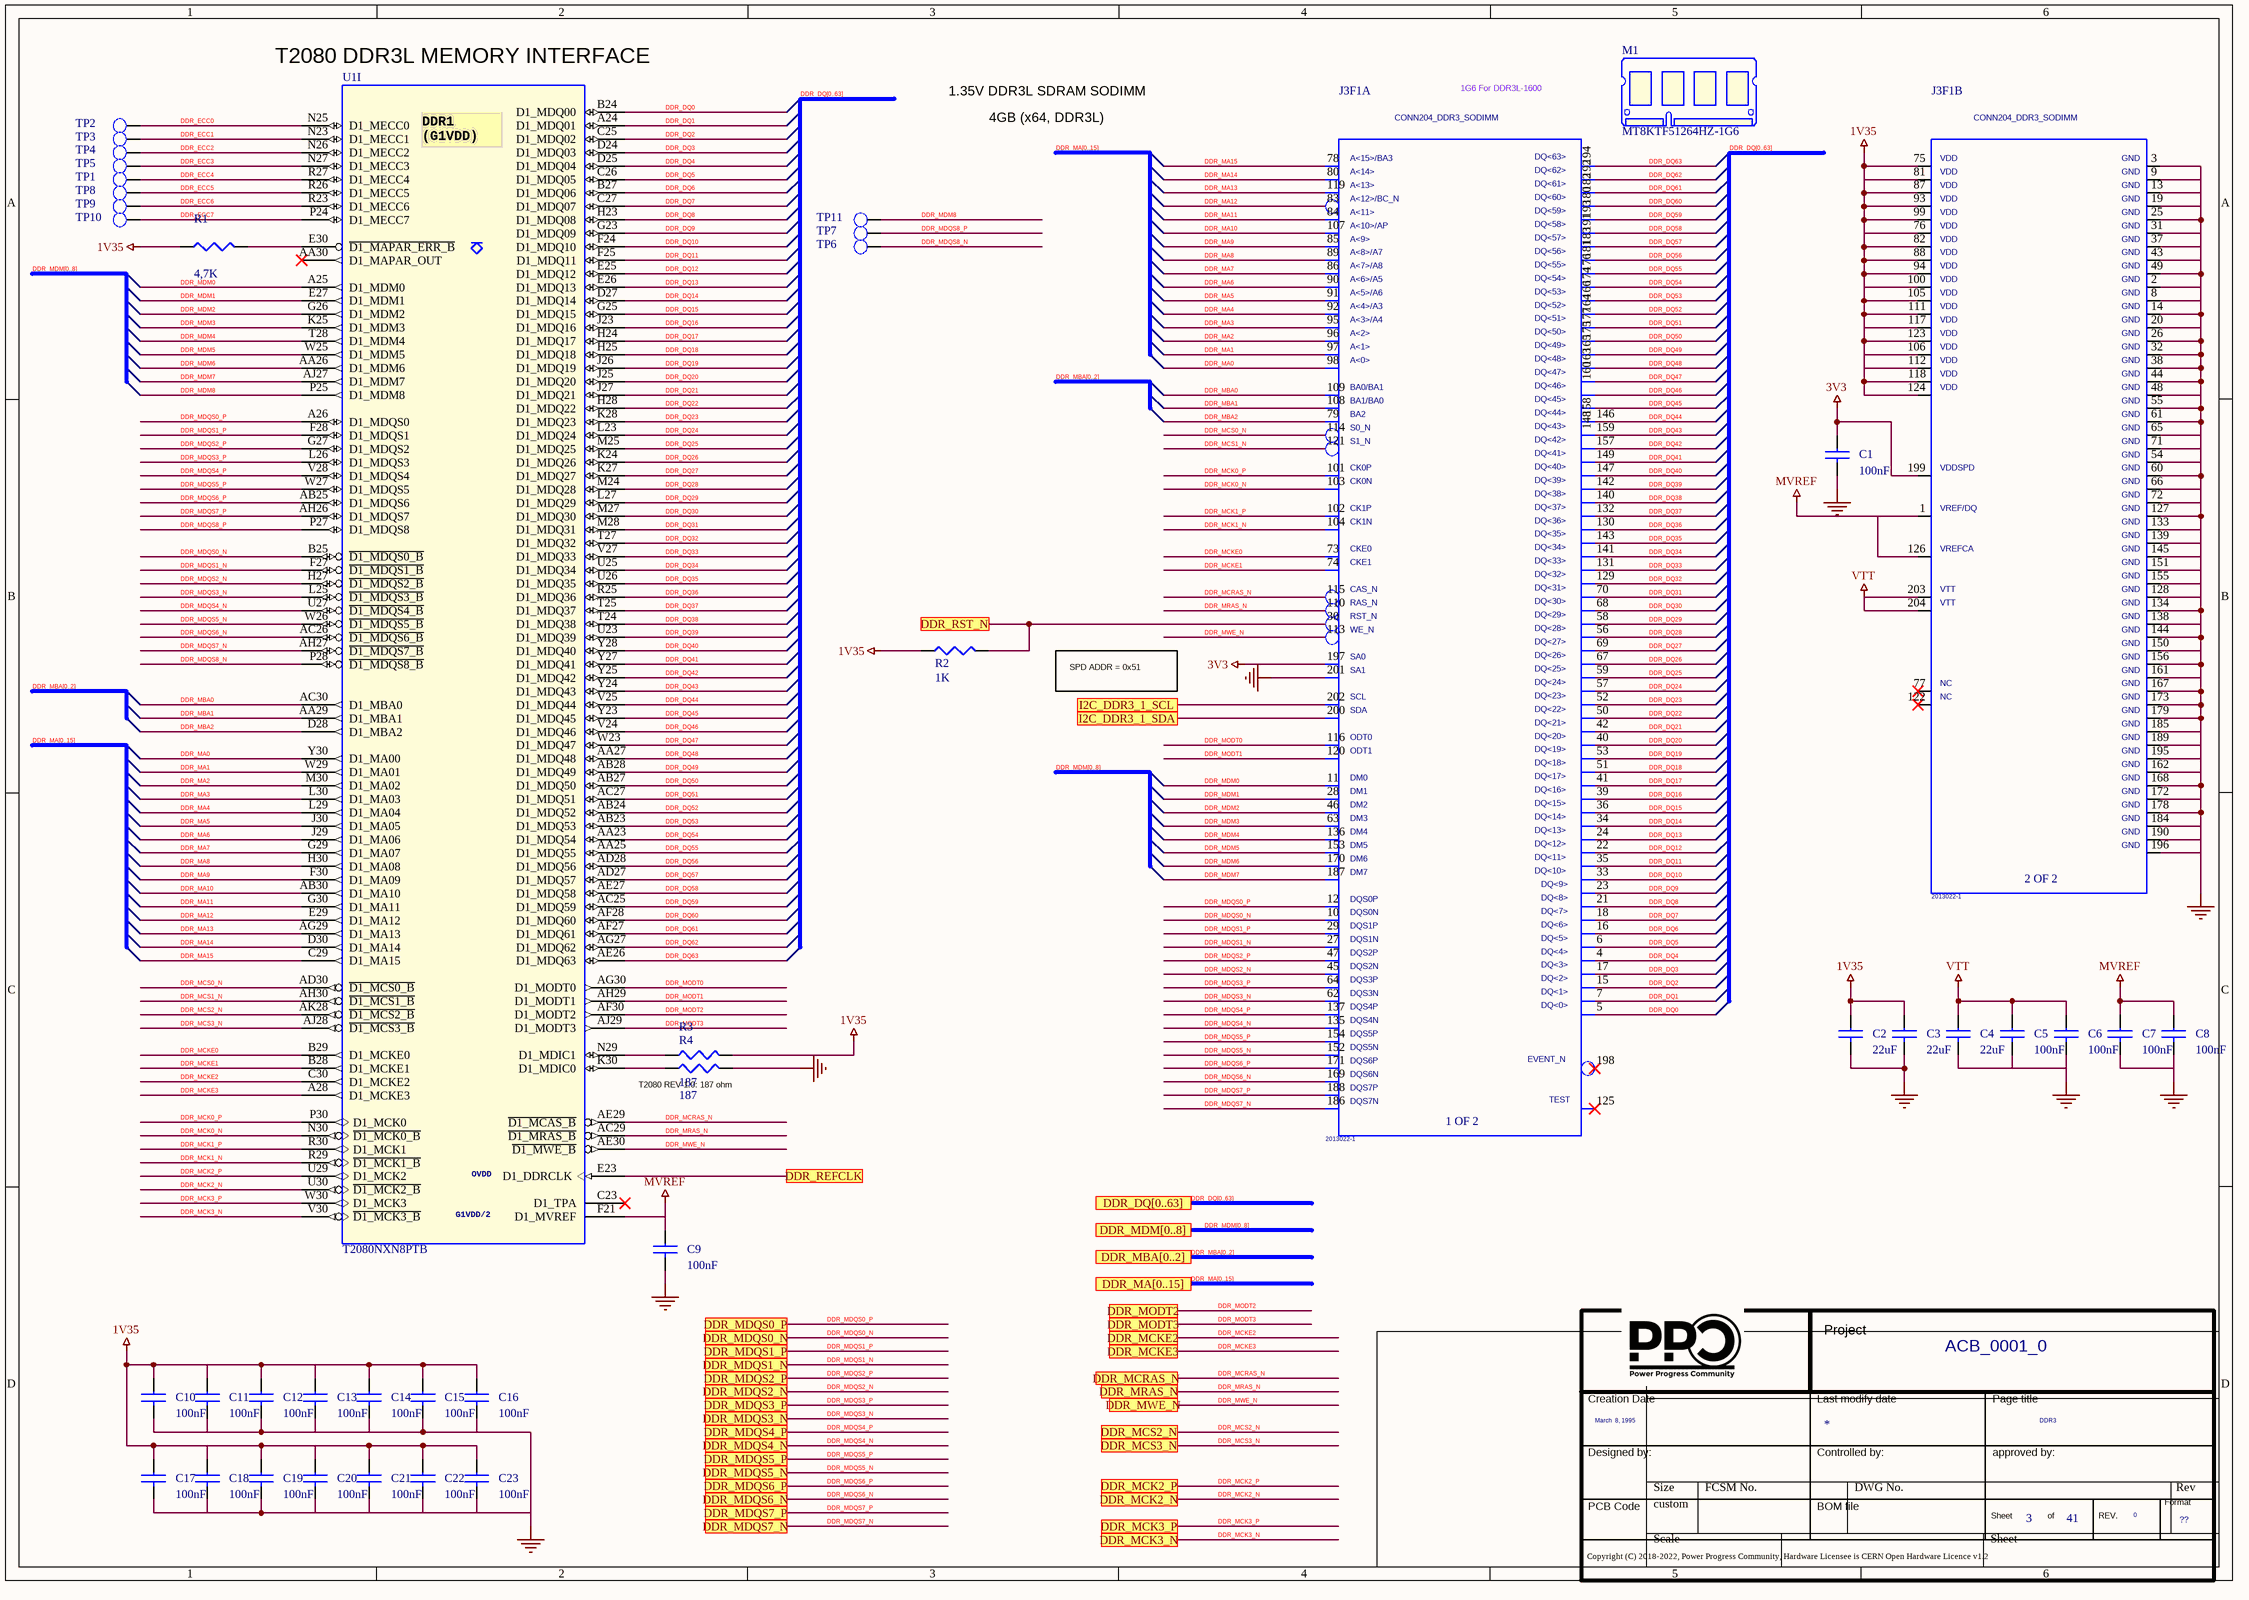
[diagram p11: 03 DDR3.SchDoc]

### Parts
(Parts that share a designator on the sheet are numbered #1, #2 ... from top to bottom, then left to right.)
*#4  Page Count: 41  Page Create Date: March  8, 1995  Page Number: 3  Page Size: ??  Page Title: DDR3  RevCode: 0  Title: ACB_0001_0  (hidden comment: Title_block_PPC)  (graphical)
C1  100nF  [SMD_0402]
C2  22uF  [SMD_0805]
C3  22uF  [SMD_0805]
C4  22uF  [SMD_0805]
C5  100nF  [SMD_0402]
C6  100nF  [SMD_0402]
C7  100nF  [SMD_0402]
C8  100nF  [SMD_0402]
C9  100nF  [SMD_0402]
C10  100nF  [SMD_0402]
C11  100nF  [SMD_0402]
C12  100nF  [SMD_0402]
C13  100nF  [SMD_0402]
C14  100nF  [SMD_0402]
C15  100nF  [SMD_0402]
C16  100nF  [SMD_0402]
C17  100nF  [SMD_0402]
C18  100nF  [SMD_0402]
C19  100nF  [SMD_0402]
C20  100nF  [SMD_0402]
C21  100nF  [SMD_0402]
C22  100nF  [SMD_0402]
C23  100nF  [SMD_0402]
J3F1  2013022-1  PART_SYM_NUM: 1 OF 2  [204 PIN PASSO 0.6mm]  (parts A,B of 2)
M1  MT8KTF51264HZ-1G6  [none]
R1  4,7K  [SMD_0402]
R2  1K  [SMD_0402]
R3  187  [SMD_0402]
R4  187  [SMD_0402]
TP1  TEST POINT  [PCB]  (value not drawn)
TP2  TEST POINT  [PCB]  (value not drawn)
TP3  TEST POINT  [PCB]  (value not drawn)
TP4  TEST POINT  [PCB]  (value not drawn)
TP5  TEST POINT  [PCB]  (value not drawn)
TP6  TEST POINT  [PCB]  (value not drawn)
TP7  TEST POINT  [PCB]  (value not drawn)
TP8  TEST POINT  [PCB]  (value not drawn)
TP9  TEST POINT  [PCB]  (value not drawn)
TP10  TEST POINT  [PCB]  (value not drawn)
TP11  TEST POINT  [PCB]  (value not drawn)
U1  T2080NXN8PTB  [bga]  (part I of 14)

### Ports
DDR_DQ[0..63], DDR_MA[0..15], DDR_MBA[0..2], DDR_MCK2_N, DDR_MCK2_P, DDR_MCK3_N, DDR_MCK3_P, DDR_MCKE2, DDR_MCKE3, DDR_MCRAS_N, DDR_MCS2_N, DDR_MCS3_N, DDR_MDM[0..8], DDR_MDQS0_N, DDR_MDQS0_P, DDR_MDQS1_N, DDR_MDQS1_P, DDR_MDQS2_N, DDR_MDQS2_P, DDR_MDQS3_N, DDR_MDQS3_P, DDR_MDQS4_N, DDR_MDQS4_P, DDR_MDQS5_N, DDR_MDQS5_P, DDR_MDQS6_N, DDR_MDQS6_P, DDR_MDQS7_N, DDR_MDQS7_P, DDR_MODT2, DDR_MODT3, DDR_MRAS_N, DDR_MWE_N, DDR_REFCLK, DDR_RST_N, I2C_DDR3_1_SCL, I2C_DDR3_1_SDA

### Nets
1V35: C2.1 C3.1 C10.1 C11.1 C12.1 C13.1 C14.1 C15.1 C16.1 C17.1 C18.1 C19.1 C20.1 C21.1 C22.1 C23.1 J3F1.75(VDD_75) J3F1.76(VDD_76) J3F1.81(VDD_81) J3F1.82(VDD_82) J3F1.87(VDD_87) J3F1.88(VDD_88) J3F1.93(VDD_93) J3F1.94(VDD_94) J3F1.99(VDD_99) J3F1.100(VDD_100) J3F1.105(VDD_105) J3F1.106(VDD_106) J3F1.111(VDD_111) J3F1.112(VDD_112) J3F1.117(VDD_117) J3F1.118(VDD_118) J3F1.123(VDD_123) J3F1.124(VDD_124) R1.1 R2.1 R3.2
3V3: C1.1 J3F1.197(SA0) J3F1.199(VDDSPD)
GND: C1.2 C2.2 C3.2 C4.2 C5.2 C6.2 C7.2 C8.2 C9.2 C10.2 C11.2 C12.2 C13.2 C14.2 C15.2 C16.2 C17.2 C18.2 C19.2 C20.2 C21.2 C22.2 C23.2 J3F1.2(GND_2) J3F1.3(GND_3) J3F1.8(GND_8) J3F1.9(GND_9) J3F1.13(GND_13) J3F1.14(GND_14) J3F1.19(GND_19) J3F1.20(GND_20) J3F1.25(GND_25) J3F1.26(GND_26) J3F1.31(GND_31) J3F1.32(GND_32) J3F1.37(GND_37) J3F1.38(GND_38) J3F1.43(GND_43) J3F1.44(GND_44) J3F1.48(GND_48) J3F1.49(GND_49) J3F1.54(GND_54) J3F1.55(GND_55) J3F1.60(GND_60) J3F1.61(GND_61) J3F1.65(GND_65) J3F1.66(GND_66) J3F1.71(GND_71) J3F1.72(GND_72) J3F1.127(GND_127) J3F1.128(GND_128) J3F1.133(GND_133) J3F1.134(GND_134) J3F1.138(GND_138) J3F1.139(GND_139) J3F1.144(GND_144) J3F1.145(GND_145) J3F1.150(GND_150) J3F1.151(GND_151) J3F1.155(GND_155) J3F1.156(GND_156) J3F1.161(GND_161) J3F1.162(GND_162) J3F1.167(GND_167) J3F1.168(GND_168) J3F1.172(GND_172) J3F1.173(GND_173) J3F1.178(GND_178) J3F1.179(GND_179) J3F1.184(GND_184) J3F1.185(GND_185) J3F1.189(GND_189) J3F1.190(GND_190) J3F1.195(GND_195) J3F1.196(GND_196) J3F1.201(SA1) R4.2
MVREF: C7.1 C8.1 C9.1 J3F1.1(VREF_DQ) J3F1.126(VREFCA) U1.F21(D1_MVREF)
VTT: C4.1 C5.1 C6.1 J3F1.203(VTT_203) J3F1.204(VTT_204)
DDR_DQ0: J3F1.5(DQ[0]) U1.B24(D1_MDQ00)
DDR_DQ1: J3F1.7(DQ[1]) U1.A24(D1_MDQ01)
DDR_DQ2: J3F1.15(DQ[2]) U1.C25(D1_MDQ02)
DDR_DQ3: J3F1.17(DQ[3]) U1.D24(D1_MDQ03)
DDR_DQ4: J3F1.4(DQ[4]) U1.D25(D1_MDQ04)
DDR_DQ5: J3F1.6(DQ[5]) U1.C26(D1_MDQ05)
DDR_DQ6: J3F1.16(DQ[6]) U1.B27(D1_MDQ06)
DDR_DQ7: J3F1.18(DQ[7]) U1.C27(D1_MDQ07)
DDR_DQ8: J3F1.21(DQ[8]) U1.H23(D1_MDQ08)
DDR_DQ9: J3F1.23(DQ[9]) U1.G23(D1_MDQ09)
DDR_DQ10: J3F1.33(DQ[10]) U1.F24(D1_MDQ10)
DDR_DQ11: J3F1.35(DQ[11]) U1.F25(D1_MDQ11)
DDR_DQ12: J3F1.22(DQ[12]) U1.E25(D1_MDQ12)
DDR_DQ13: J3F1.24(DQ[13]) U1.E26(D1_MDQ13)
DDR_DQ14: J3F1.34(DQ[14]) U1.D27(D1_MDQ14)
DDR_DQ15: J3F1.36(DQ[15]) U1.G25(D1_MDQ15)
DDR_DQ16: J3F1.39(DQ[16]) U1.J23(D1_MDQ16)
DDR_DQ17: J3F1.41(DQ[17]) U1.H24(D1_MDQ17)
DDR_DQ18: J3F1.51(DQ[18]) U1.H25(D1_MDQ18)
DDR_DQ19: J3F1.53(DQ[19]) U1.J26(D1_MDQ19)
DDR_DQ20: J3F1.40(DQ[20]) U1.J25(D1_MDQ20)
DDR_DQ21: J3F1.42(DQ[21]) U1.J27(D1_MDQ21)
DDR_DQ22: J3F1.50(DQ[22]) U1.H28(D1_MDQ22)
DDR_DQ23: J3F1.52(DQ[23]) U1.K28(D1_MDQ23)
DDR_DQ24: J3F1.57(DQ[24]) U1.L23(D1_MDQ24)
DDR_DQ25: J3F1.59(DQ[25]) U1.M25(D1_MDQ25)
DDR_DQ26: J3F1.67(DQ[26]) U1.K24(D1_MDQ26)
DDR_DQ27: J3F1.69(DQ[27]) U1.K27(D1_MDQ27)
DDR_DQ28: J3F1.56(DQ[28]) U1.M24(D1_MDQ28)
DDR_DQ29: J3F1.58(DQ[29]) U1.L27(D1_MDQ29)
DDR_DQ30: J3F1.68(DQ[30]) U1.M27(D1_MDQ30)
DDR_DQ31: J3F1.70(DQ[31]) U1.M28(D1_MDQ31)
DDR_DQ32: J3F1.129(DQ[32]) U1.T27(D1_MDQ32)
DDR_DQ33: J3F1.131(DQ[33]) U1.V27(D1_MDQ33)
DDR_DQ34: J3F1.141(DQ[34]) U1.U25(D1_MDQ34)
DDR_DQ35: J3F1.143(DQ[35]) U1.U26(D1_MDQ35)
DDR_DQ36: J3F1.130(DQ[36]) U1.R25(D1_MDQ36)
DDR_DQ37: J3F1.132(DQ[37]) U1.T25(D1_MDQ37)
DDR_DQ38: J3F1.140(DQ[38]) U1.T24(D1_MDQ38)
DDR_DQ39: J3F1.142(DQ[39]) U1.U23(D1_MDQ39)
DDR_DQ40: J3F1.147(DQ[40]) U1.Y28(D1_MDQ40)
DDR_DQ41: J3F1.149(DQ[41]) U1.Y27(D1_MDQ41)
DDR_DQ42: J3F1.157(DQ[42]) U1.Y25(D1_MDQ42)
DDR_DQ43: J3F1.159(DQ[43]) U1.Y24(D1_MDQ43)
DDR_DQ44: J3F1.146(DQ[44]) U1.V25(D1_MDQ44)
DDR_DQ45: J3F1.148(DQ[45]) U1.Y23(D1_MDQ45)
DDR_DQ46: J3F1.158(DQ[46]) U1.V24(D1_MDQ46)
DDR_DQ47: J3F1.160(DQ[47]) U1.W23(D1_MDQ47)
DDR_DQ48: J3F1.163(DQ[48]) U1.AA27(D1_MDQ48)
DDR_DQ49: J3F1.165(DQ[49]) U1.AB28(D1_MDQ49)
DDR_DQ50: J3F1.175(DQ[50]) U1.AB27(D1_MDQ50)
DDR_DQ51: J3F1.177(DQ[51]) U1.AC27(D1_MDQ51)
DDR_DQ52: J3F1.164(DQ[52]) U1.AB24(D1_MDQ52)
DDR_DQ53: J3F1.166(DQ[53]) U1.AB23(D1_MDQ53)
DDR_DQ54: J3F1.174(DQ[54]) U1.AA23(D1_MDQ54)
DDR_DQ55: J3F1.176(DQ[55]) U1.AA25(D1_MDQ55)
DDR_DQ56: J3F1.181(DQ[56]) U1.AD28(D1_MDQ56)
DDR_DQ57: J3F1.183(DQ[57]) U1.AD27(D1_MDQ57)
DDR_DQ58: J3F1.191(DQ[58]) U1.AE27(D1_MDQ58)
DDR_DQ59: J3F1.193(DQ[59]) U1.AC25(D1_MDQ59)
DDR_DQ60: J3F1.180(DQ[60]) U1.AF28(D1_MDQ60)
DDR_DQ61: J3F1.182(DQ[61]) U1.AF27(D1_MDQ61)
DDR_DQ62: J3F1.192(DQ[62]) U1.AG27(D1_MDQ62)
DDR_DQ63: J3F1.194(DQ[63]) U1.AE26(D1_MDQ63)
DDR_ECC0: TP2.1(TP) U1.N25(D1_MECC0)
DDR_ECC1: TP3.1(TP) U1.N23(D1_MECC1)
DDR_ECC2: TP4.1(TP) U1.N26(D1_MECC2)
DDR_ECC3: TP5.1(TP) U1.N27(D1_MECC3)
DDR_ECC4: TP1.1(TP) U1.R27(D1_MECC4)
DDR_ECC5: TP8.1(TP) U1.R26(D1_MECC5)
DDR_ECC6: TP9.1(TP) U1.R23(D1_MECC6)
DDR_ECC7: TP10.1(TP) U1.P24(D1_MECC7)
DDR_MA0: J3F1.98(A[0]) U1.Y30(D1_MA00)
DDR_MA1: J3F1.97(A[1]) U1.W29(D1_MA01)
DDR_MA2: J3F1.96(A[2]) U1.M30(D1_MA02)
DDR_MA3: J3F1.95(A[3]) U1.L30(D1_MA03)
DDR_MA4: J3F1.92(A[4]) U1.L29(D1_MA04)
DDR_MA5: J3F1.91(A[5]) U1.J30(D1_MA05)
DDR_MA6: J3F1.90(A[6]) U1.J29(D1_MA06)
DDR_MA7: J3F1.86(A[7]) U1.G29(D1_MA07)
DDR_MA8: J3F1.89(A[8]) U1.H30(D1_MA08)
DDR_MA9: J3F1.85(A[9]) U1.F30(D1_MA09)
DDR_MA10: J3F1.107(A[10]) U1.AB30(D1_MA10)
DDR_MA11: J3F1.84(A[11]) U1.G30(D1_MA11)
DDR_MA12: J3F1.83(A[12]) U1.E29(D1_MA12)
DDR_MA13: J3F1.119(A[13]) U1.AG29(D1_MA13)
DDR_MA14: J3F1.80(A[14]) U1.D30(D1_MA14)
DDR_MA15: J3F1.78(A[15]) U1.C29(D1_MA15)
DDR_MBA0: J3F1.109(BA0_BA1) U1.AC30(D1_MBA0)
DDR_MBA1: J3F1.108(BA1_BA0) U1.AA29(D1_MBA1)
DDR_MBA2: J3F1.79(BA2) U1.D28(D1_MBA2)
DDR_MCK0_N: J3F1.103(CK0N) U1.N30(~{D1_MCK0_B})
DDR_MCK0_P: J3F1.101(CK0P) U1.P30(D1_MCK0)
DDR_MCK1_N: J3F1.104(CK1N) U1.R29(~{D1_MCK1_B})
DDR_MCK1_P: J3F1.102(CK1P) U1.R30(D1_MCK1)
DDR_MCK2_N: U1.U30(~{D1_MCK2_B}) ; port DDR_MCK2_N
DDR_MCK2_P: U1.U29(D1_MCK2) ; port DDR_MCK2_P
DDR_MCK3_N: U1.V30(~{D1_MCK3_B}) ; port DDR_MCK3_N
DDR_MCK3_P: U1.W30(D1_MCK3) ; port DDR_MCK3_P
DDR_MCKE0: J3F1.73(CKE0) U1.B29(D1_MCKE0)
DDR_MCKE1: J3F1.74(CKE1) U1.B28(D1_MCKE1)
DDR_MCKE2: U1.C30(D1_MCKE2) ; port DDR_MCKE2
DDR_MCKE3: U1.A28(D1_MCKE3) ; port DDR_MCKE3
DDR_MCRAS_N: J3F1.115(CAS_N) U1.AE29(~{D1_MCAS_B}) ; port DDR_MCRAS_N
DDR_MCS0_N: J3F1.114(S0_N) U1.AD30(~{D1_MCS0_B})
DDR_MCS1_N: J3F1.121(S1_N) U1.AH30(~{D1_MCS1_B})
DDR_MCS2_N: U1.AK28(~{D1_MCS2_B}) ; port DDR_MCS2_N
DDR_MCS3_N: U1.AJ28(~{D1_MCS3_B}) ; port DDR_MCS3_N
DDR_MDM0: J3F1.11(DM0) U1.A25(D1_MDM0)
DDR_MDM1: J3F1.28(DM1) U1.E27(D1_MDM1)
DDR_MDM2: J3F1.46(DM2) U1.G26(D1_MDM2)
DDR_MDM3: J3F1.63(DM3) U1.K25(D1_MDM3)
DDR_MDM4: J3F1.136(DM4) U1.T28(D1_MDM4)
DDR_MDM5: J3F1.153(DM5) U1.W25(D1_MDM5)
DDR_MDM6: J3F1.170(DM6) U1.AA26(D1_MDM6)
DDR_MDM7: J3F1.187(DM7) U1.AJ27(D1_MDM7)
DDR_MDM8: TP11.1(TP) U1.P25(D1_MDM8)
DDR_MDQS0_N: J3F1.10(DQS0N) U1.B25(~{D1_MDQS0_B}) ; port DDR_MDQS0_N
DDR_MDQS0_P: J3F1.12(DQS0P) U1.A26(D1_MDQS0) ; port DDR_MDQS0_P
DDR_MDQS1_N: J3F1.27(DQS1N) U1.F27(~{D1_MDQS1_B}) ; port DDR_MDQS1_N
DDR_MDQS1_P: J3F1.29(DQS1P) U1.F28(D1_MDQS1) ; port DDR_MDQS1_P
DDR_MDQS2_N: J3F1.45(DQS2N) U1.H27(~{D1_MDQS2_B}) ; port DDR_MDQS2_N
DDR_MDQS2_P: J3F1.47(DQS2P) U1.G27(D1_MDQS2) ; port DDR_MDQS2_P
DDR_MDQS3_N: J3F1.62(DQS3N) U1.L25(~{D1_MDQS3_B}) ; port DDR_MDQS3_N
DDR_MDQS3_P: J3F1.64(DQS3P) U1.L26(D1_MDQS3) ; port DDR_MDQS3_P
DDR_MDQS4_N: J3F1.135(DQS4N) U1.U27(~{D1_MDQS4_B}) ; port DDR_MDQS4_N
DDR_MDQS4_P: J3F1.137(DQS4P) U1.V28(D1_MDQS4) ; port DDR_MDQS4_P
DDR_MDQS5_N: J3F1.152(DQS5N) U1.W26(~{D1_MDQS5_B}) ; port DDR_MDQS5_N
DDR_MDQS5_P: J3F1.154(DQS5P) U1.W27(D1_MDQS5) ; port DDR_MDQS5_P
DDR_MDQS6_N: J3F1.169(DQS6N) U1.AC26(~{D1_MDQS6_B}) ; port DDR_MDQS6_N
DDR_MDQS6_P: J3F1.171(DQS6P) U1.AB25(D1_MDQS6) ; port DDR_MDQS6_P
DDR_MDQS7_N: J3F1.186(DQS7N) U1.AH27(~{D1_MDQS7_B}) ; port DDR_MDQS7_N
DDR_MDQS7_P: J3F1.188(DQS7P) U1.AH26(D1_MDQS7) ; port DDR_MDQS7_P
DDR_MDQS8_N: TP6.1(TP) U1.P28(~{D1_MDQS8_B})
DDR_MDQS8_P: TP7.1(TP) U1.P27(D1_MDQS8)
DDR_MODT0: J3F1.116(ODT0) U1.AG30(D1_MODT0)
DDR_MODT1: J3F1.120(ODT1) U1.AH29(D1_MODT1)
DDR_MODT2: U1.AF30(D1_MODT2) ; port DDR_MODT2
DDR_MODT3: U1.AJ29(D1_MODT3) ; port DDR_MODT3
DDR_MRAS_N: J3F1.110(RAS_N) U1.AC29(~{D1_MRAS_B}) ; port DDR_MRAS_N
DDR_MWE_N: J3F1.113(WE_N) U1.AE30(~{D1_MWE_B}) ; port DDR_MWE_N
NetJ3F1_30: J3F1.30(RST_N) R2.2 ; port DDR_RST_N
NetJ3F1_200: J3F1.200(SDA) ; port I2C_DDR3_1_SDA
NetJ3F1_202: J3F1.202(SCL) ; port I2C_DDR3_1_SCL
NetR1_2: R1.2 U1.E30(~{D1_MAPAR_ERR_B})
NetR3_1: R3.1 U1.N29(D1_MDIC1)
NetR4_1: R4.1 U1.K30(D1_MDIC0)
NetR705_2: U1.E23(D1_DDRCLK) ; port DDR_REFCLK

Not connected (* = marked no-connect by the designer): J3F1 77(NC_77)* 122(NC_122)* 125(TEST)* 198(EVENT_N)*; U1 AA30(D1_MAPAR_OUT)* C23(D1_TPA)*

### Buses and harness runs
bus DDR_DQ[0..63]
bus DDR_DQ[0..63] = port DDR_DQ[0..63]
bus DDR_MA[0..15]
bus DDR_MA[0..15] = port DDR_MA[0..15]
bus DDR_MBA[0..2]
bus DDR_MBA[0..2] = port DDR_MBA[0..2]
bus DDR_MDM[0..8]
bus DDR_MDM[0..8] = port DDR_MDM[0..8]

### Notes on the sheet
- (near U1) T2080 DDR3L MEMORY INTERFACE
- 1.35V DDR3L SDRAM SODIMM
- 4GB (x64, DDR3L)
- 1G6 For DDR3L-1600
- SPD ADDR = 0x51
- (near R4) T2080 REV 1.0: 187 ohm
- (in symbol CONN204_DDR3_SODIMM, part A) A<15>/BA3; DQ<63>; A<14>; DQ<62>; A<13>; DQ<61>; A<12>/BC_N; DQ<60>; A<11>; DQ<59>; A<10>/AP; DQ<58>; A<9>; DQ<57>; A<8>/A7; DQ<56>; A<7>/A8; DQ<55>; A<6>/A5; DQ<54>; A<5>/A6; DQ<53>; A<4>/A3; DQ<52>; A<3>/A4; DQ<51>; A<2>; DQ<50>; A<1>; DQ<49>; A<0>; DQ<48>; DQ<47>; BA0/BA1; DQ<46>; BA1/BA0; DQ<45>; DQ<44>; DQ<43>; DQ<42>; DQ<41>; DQ<40>; DQ<39>; DQ<38>; DQ<37>; DQ<36>; DQ<35>; DQ<34>; DQ<33>; DQ<32>; DQ<31>; DQ<30>; DQ<29>; DQ<28>; DQ<27>; DQ<26>; DQ<25>; DQ<24>; DQ<23>; DQ<22>; DQ<21>; DQ<20>; DQ<19>; DQ<18>; DQ<17>; DQ<16>; DQ<15>; DQ<14>; DQ<13>; DQ<12>; DQ<11>; DQ<10>; DQ<9>; DQ<8>; DQ<7>; DQ<6>; DQ<5>; DQ<4>; DQ<3>; DQ<2>; DQ<1>; DQ<0>
- (in symbol CONN204_DDR3_SODIMM, part B) VDD; GND; VREF/DQ; VTT; NC
- (in symbol T2080, part I) DDR1 / (G1VDD); OVDD; G1VDD/2

### Library data of the parts
C1 C9 = CAP NP_Dup3: COND.CER. 100NF 50V 0402 X7R SMD; Manufacturer Part Number 1: CGA2B3X7R1H104M050BD; Manufacturer 1: TDK; Part Number: PASSIVE_24; RSM: RC0402; PCB Footprint: SMD_0402; Part Type: Capacitors\Ceramic\SMD\0402
C2-C4 = CAP NP_Dup3: as C25 on sheet 03B_DDR3_2; Part Type: Capacitors\Ceramic\SMD\0805; PCB Footprint: SMD_0805
C5-C8 C10-C23 = CAP NP_Dup3: as C24 on sheet 03B_DDR3_2; Part Type: Capacitors\Ceramic\SMD\0402; PCB Footprint: SMD_0402
J3F1 = CONN204_DDR3_SODIMM: Connettori DIMM SEMI-HARD TRAY DDR3 204P 4H STD; PART_NUMBER: E85705-003; Manufacturer 1: TE CONNECTIVITY; Part Number: CONNECTORS_683; CDS_PART_NAME: CONN204_DDR3_SODIMM_SMLF-E85705-003; OriginalSymbolOrigin: (-500,1850); PACK_TYPE: SMLF; RSM: TE-2013022-1; CDS_LIB: lf_for_review_only; DRAWING: @OXBOW_HILL_LIB.OXBOW_HILL(SCH_1):PAGE284; LOCATION: J3F1; PHYS_PAGE: 28; ROT: 0; VER: 1; XY: (900,1475); CaptureCellPackProp: CONN204_DDR3_SODIMMA; MATERIAL: CONN; PCB Footprint: 204 PIN PASSO 0.6mm; Distributor 1: MOUSER(571-2013022-1); Manufacturer Part Number 1: 2013022-1; Part Type: DIMM; CDS_PHYS_PART_NAME: CONN204_DDR3_SODIMM_SMLF-E85705-003; CHIPS_PART_NAME: CONN204_DDR3_SODIMM; SEC_TYPE: SMLF
M1 = DDR_MDL: MPN: MT18KSF51272HZ-1G6; Vendor: Micron; TYPE: MEC; PCB Footprint: none
R1 = R_Dup6: RESIS.CHIP 4,7K 5% 0402 SMD; Manufacturer 1: ROYAL OHM; Part Number: PASSIVE_861; RSM: RC0402; PCB Footprint: SMD_0402; Manufacturer Part Number 1: RESIS.CHIP 4,7K 5% 0402 SMD; Part Type: Resistors\Fixed\SMD\0402\5%
R2 = R_Dup6: RESIS.CHIP 1K 1% 0402 SMD; Part Number: PASSIVE_628; Manufacturer 1: ROYAL OHM; RSM: RC0402; Part Type: Resistors\Fixed\SMD\0402\1%; Manufacturer Part Number 1: RESIS.CHIP 1K 1% 0402 SMD; PCB Footprint: SMD_0402
R3 R4 = R_Dup6: RESIS.CHIP 187R 1% 0402 SMD; Manufacturer Part Number 1: CR0402-FX-1870GLF; Manufacturer 1: bourns; Part Number: PASSIVE_1445; RSM: RC0402; Part Type: Resistors\Fixed\SMD\0402\1%; PCB Footprint: SMD_0402
TP1-TP11 = T POINT R_Dup1: TEST POINT SU PCB; Part Number: CONNECTORS_542; RSM: AE-TESTPOINT; Part Type: Tpoint; PCB Footprint: PCB
U1 = T2080: QRIQ MPU 1.87GT/s DDR3/3L 4x10GE; Manufacturer 1: NXP; Part Number: MICROPROCESSOR_65; PCB Footprint: BGA896; Vendor: Freescale; RSM: PBGA896-0_8MM-25X25; Distributor 1: MOUSER(841-T2080NXN8PTB); Manufacturer Part Number 1: T2080NXN8PTB; Part Type: 32 BIT; MPN: T2080; TYPE: IC
*#4 = Title_block_PPC: Page Modify Date: *

## Sheet 04 IFC.SchDoc
size 420 x 297 mm
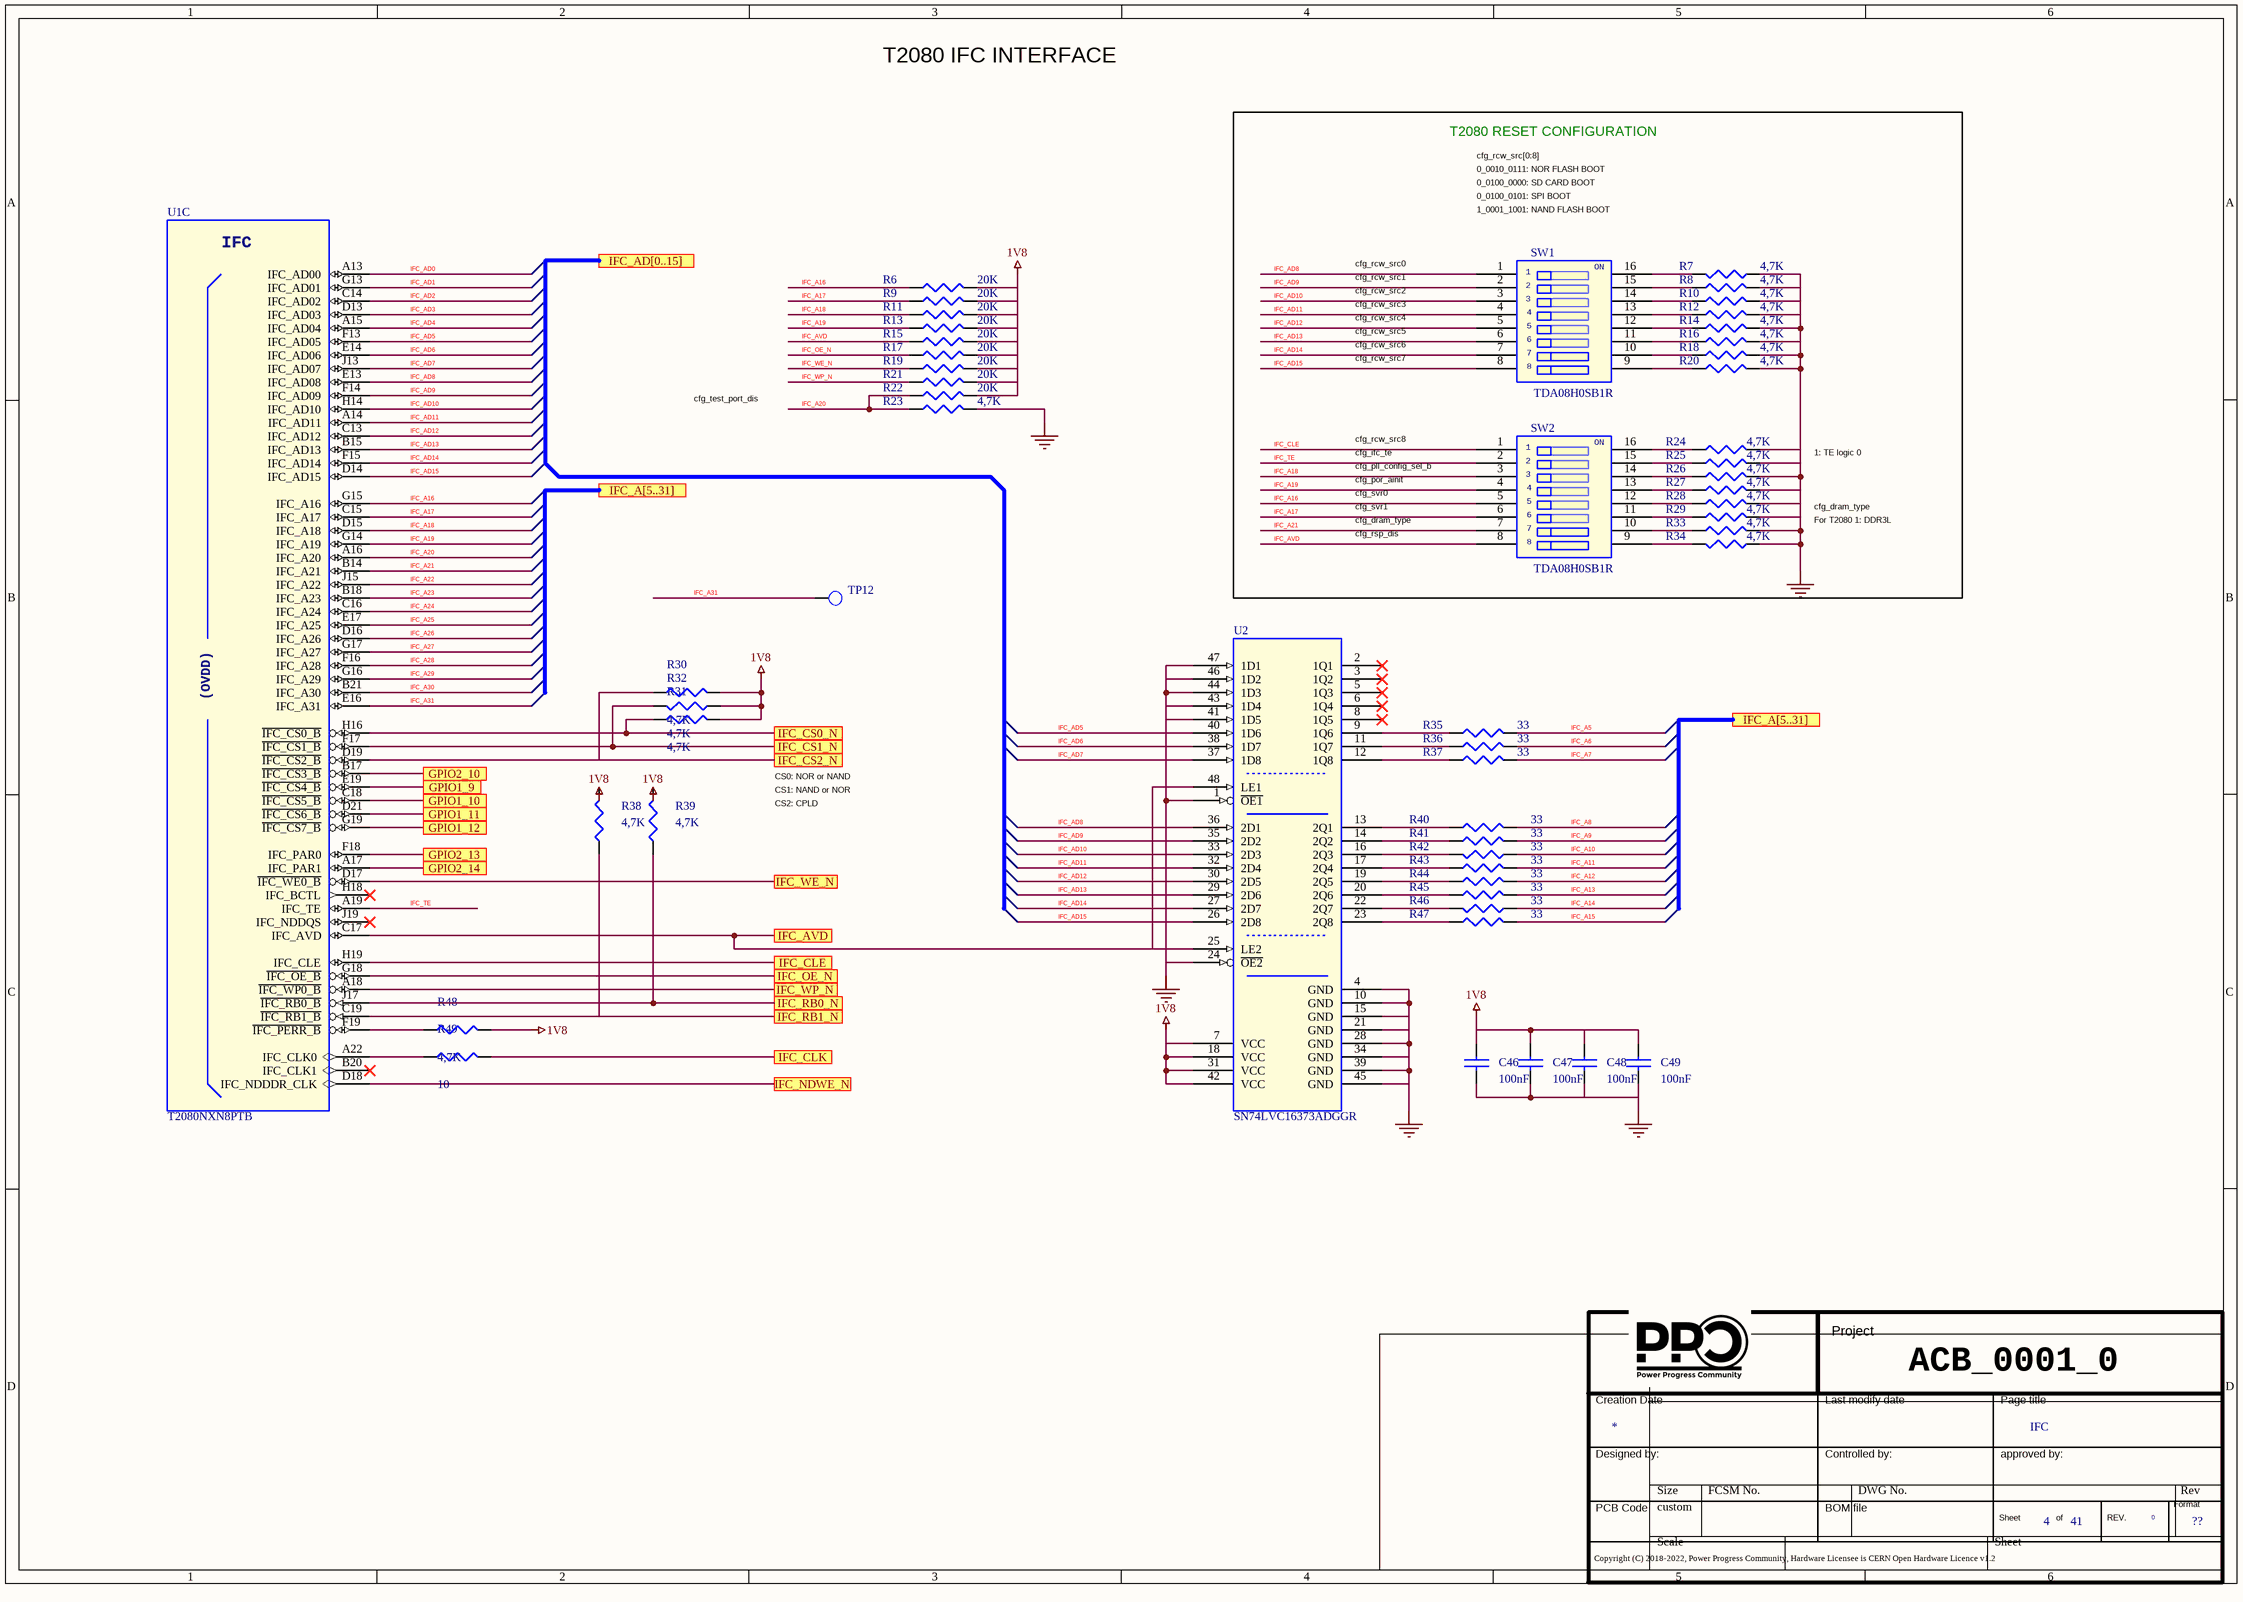
[diagram p12: 04 IFC.SchDoc]

### Parts
(Parts that share a designator on the sheet are numbered #1, #2 ... from top to bottom, then left to right.)
*#5  Doc: IFC  Page Count: 41  Page Number: 4  Page Size: ??  RevCode: 0  (hidden comment: Title_block_PPC)  (graphical)
C46  100nF  [SMD_0402]
C47  100nF  [SMD_0402]
C48  100nF  [SMD_0402]
C49  100nF  [SMD_0402]
R6  20K  [SMD_0402]
R7  4,7K  [SMD_0402]
R8  4,7K  [SMD_0402]
R9  20K  [SMD_0402]
R10  4,7K  [SMD_0402]
R11  20K  [SMD_0402]
R12  4,7K  [SMD_0402]
R13  20K  [SMD_0402]
R14  4,7K  [SMD_0402]
R15  20K  [SMD_0402]
R16  4,7K  [SMD_0402]
R17  20K  [SMD_0402]
R18  4,7K  [SMD_0402]
R19  20K  [SMD_0402]
R20  4,7K  [SMD_0402]
R21  20K  [SMD_0402]
R22  20K  [SMD_0402]
R23  4,7K  [SMD_0402]
R24  4,7K  [SMD_0402]
R25  4,7K  [SMD_0402]
R26  4,7K  [SMD_0402]
R27  4,7K  [SMD_0402]
R28  4,7K  [SMD_0402]
R29  4,7K  [SMD_0402]
R30  4,7K  [SMD_0402]
R31  4,7K  [SMD_0402]
R32  4,7K  [SMD_0402]
R33  4,7K  [SMD_0402]
R34  4,7K  [SMD_0402]
R35  33  [SMD_0402]
R36  33  [SMD_0402]
R37  33  [SMD_0402]
R38  4,7K  [SMD_0402]
R39  4,7K  [SMD_0402]
R40  33  [SMD_0402]
R41  33  [SMD_0402]
R42  33  [SMD_0402]
R43  33  [SMD_0402]
R44  33  [SMD_0402]
R45  33  [SMD_0402]
R46  33  [SMD_0402]
R47  33  [SMD_0402]
R48  4,7K  [SMD_0402]
R49  10  [SMD_0402]
SW1  TDA08H0SB1R  [2X8 PASSO 1.27mm]
SW2  TDA08H0SB1R  [2X8 PASSO 1.27mm]
TP12  TEST POINT  [PCB]  (value not drawn)
U1  T2080NXN8PTB  [bga]  (part C of 14)
U2  SN74LVC16373ADGGR  [tssop_48w]

### Blocks framed on the sheet
T2080 RESET CONFIGURATION: R7 R8 R10 R12 R14 R16 R18 R20 R24-R29 R33 R34 SW1 SW2

### Ports
GPIO1_9, GPIO1_10, GPIO1_11, GPIO1_12, GPIO2_10, GPIO2_13, GPIO2_14, IFC_A[5..31], IFC_AD[0..15], IFC_AVD, IFC_CLE, IFC_CLK, IFC_CS0_N, IFC_CS1_N, IFC_CS2_N, IFC_NDWE_N, IFC_OE_N, IFC_RB0_N, IFC_RB1_N, IFC_WE_N, IFC_WP_N

### Nets
1V8: C46.1 C47.1 C48.1 C49.1 R6.2 R9.2 R11.2 R13.2 R15.2 R17.2 R19.2 R21.2 R22.2 R30.2 R31.2 R32.1 R38.2 R39.2 R48.2 U2.7(VCC) U2.18(VCC) U2.31(VCC) U2.42(VCC)
GND: C46.2 C47.2 C48.2 C49.2 R7.1 R8.2 R10.2 R12.2 R14.2 R16.2 R18.2 R20.2 R23.2 R24.2 R25.2 R26.2 R27.2 R28.2 R29.2 R33.2 R34.1 U2.1(~{OE1}) U2.4(GND) U2.10(GND) U2.15(GND) U2.21(GND) U2.24(~{OE2}) U2.28(GND) U2.34(GND) U2.39(GND) U2.41(1D5) U2.43(1D4) U2.44(1D3) U2.45(GND) U2.46(1D2) U2.47(1D1)
IFC_A5: R35.2
IFC_A6: R36.2
IFC_A7: R37.2
IFC_A8: R40.2
IFC_A9: R41.2
IFC_A10: R42.1
IFC_A11: R43.2
IFC_A12: R44.2
IFC_A13: R45.2
IFC_A14: R46.1
IFC_A15: R47.2
IFC_A16: R6.1 SW2.5 U1.G15(IFC_A16)
IFC_A17: R9.1 SW2.6 U1.C15(IFC_A17)
IFC_A18: R11.1 SW2.3 U1.D15(IFC_A18)
IFC_A19: R13.1 SW2.4 U1.G14(IFC_A19)
IFC_A20: R22.1 R23.1 U1.A16(IFC_A20)
IFC_A21: SW2.7 U1.B14(IFC_A21)
IFC_A22: U1.J15(IFC_A22)
IFC_A23: U1.B18(IFC_A23)
IFC_A24: U1.C16(IFC_A24)
IFC_A25: U1.E17(IFC_A25)
IFC_A26: U1.D16(IFC_A26)
IFC_A27: U1.G17(IFC_A27)
IFC_A28: U1.F16(IFC_A28)
IFC_A29: U1.G16(IFC_A29)
IFC_A30: U1.B21(IFC_A30)
IFC_A31: TP12.1(TP) U1.E16(IFC_A31)
IFC_AD0: U1.A13(IFC_AD00)
IFC_AD1: U1.G13(IFC_AD01)
IFC_AD2: U1.C14(IFC_AD02)
IFC_AD3: U1.D13(IFC_AD03)
IFC_AD4: U1.A15(IFC_AD04)
IFC_AD5: U1.F13(IFC_AD05) U2.40(1D6)
IFC_AD6: U1.E14(IFC_AD06) U2.38(1D7)
IFC_AD7: U1.J13(IFC_AD07) U2.37(1D8)
IFC_AD8: SW1.1 U1.E13(IFC_AD08) U2.36(2D1)
IFC_AD9: SW1.2 U1.F14(IFC_AD09) U2.35(2D2)
IFC_AD10: SW1.3 U1.H14(IFC_AD10) U2.33(2D3)
IFC_AD11: SW1.4 U1.A14(IFC_AD11) U2.32(2D4)
IFC_AD12: SW1.5 U1.C13(IFC_AD12) U2.30(2D5)
IFC_AD13: SW1.6 U1.B15(IFC_AD13) U2.29(2D6)
IFC_AD14: SW1.7 U1.F15(IFC_AD14) U2.27(2D7)
IFC_AD15: SW1.8 U1.D14(IFC_AD15) U2.26(2D8)
IFC_AVD: R15.1 SW2.8
IFC_CLE: SW2.1
IFC_OE_N: R17.1
IFC_TE: SW2.2 U1.A19(IFC_TE)
IFC_WE_N: R19.1
IFC_WP_N: R21.1
NetR7_2: R7.2 SW1.16
NetR8_1: R8.1 SW1.15
NetR10_1: R10.1 SW1.14
NetR12_1: R12.1 SW1.13
NetR14_1: R14.1 SW1.12
NetR16_1: R16.1 SW1.11
NetR18_1: R18.1 SW1.10
NetR20_1: R20.1 SW1.9
NetR24_1: R24.1 SW2.16
NetR25_1: R25.1 SW2.15
NetR26_1: R26.1 SW2.14
NetR27_1: R27.1 SW2.13
NetR28_1: R28.1 SW2.12
NetR29_1: R29.1 SW2.11
NetR30_1: R30.1 U1.D19(~{IFC_CS2_B}) ; port IFC_CS2_N
NetR31_1: R31.1 U1.H16(~{IFC_CS0_B}) ; port IFC_CS0_N
NetR32_2: R32.2 U1.F17(~{IFC_CS1_B}) ; port IFC_CS1_N
NetR33_1: R33.1 SW2.10
NetR34_2: R34.2 SW2.9
NetR35_1: R35.1 U2.9(1Q6)
NetR36_1: R36.1 U2.11(1Q7)
NetR37_1: R37.1 U2.12(1Q8)
NetR38_1: R38.1 U1.C19(~{IFC_RB1_B}) ; port IFC_RB1_N
NetR39_1: R39.1 U1.J17(~{IFC_RB0_B}) ; port IFC_RB0_N
NetR40_1: R40.1 U2.13(2Q1)
NetR41_1: R41.1 U2.14(2Q2)
NetR42_2: R42.2 U2.16(2Q3)
NetR43_1: R43.1 U2.17(2Q4)
NetR44_1: R44.1 U2.19(2Q5)
NetR45_1: R45.1 U2.20(2Q6)
NetR46_2: R46.2 U2.22(2Q7)
NetR47_1: R47.1 U2.23(2Q8)
NetR48_1: R48.1 U1.F19(~{IFC_PERR_B})
NetR49_1: R49.1 U1.A22(IFC_CLK0)
NetR49_2: R49.2 ; port IFC_CLK
NetU1_A17: U1.A17(IFC_PAR1) ; port GPIO2_14
NetU1_A18: U1.A18(~{IFC_WP0_B}) ; port IFC_WP_N
NetU1_B17: U1.B17(~{IFC_CS3_B}) ; port GPIO2_10
NetU1_C17: U1.C17(IFC_AVD) U2.25(LE2) U2.48(LE1) ; port IFC_AVD
NetU1_C18: U1.C18(~{IFC_CS5_B}) ; port GPIO1_10
NetU1_D17: U1.D17(~{IFC_WE0_B}) ; port IFC_WE_N
NetU1_D18: U1.D18(IFC_NDDDR_CLK) ; port IFC_NDWE_N
NetU1_D21: U1.D21(~{IFC_CS6_B}) ; port GPIO1_11
NetU1_E19: U1.E19(~{IFC_CS4_B}) ; port GPIO1_9
NetU1_F18: U1.F18(IFC_PAR0) ; port GPIO2_13
NetU1_G18: U1.G18(~{IFC_OE_B}) ; port IFC_OE_N
NetU1_G19: U1.G19(~{IFC_CS7_B}) ; port GPIO1_12
NetU1_H19: U1.H19(IFC_CLE) ; port IFC_CLE

Not connected (* = marked no-connect by the designer): U1 B20(IFC_CLK1)* H18(IFC_BCTL)* J19(IFC_NDDQS)*; U2 2(1Q1)* 3(1Q2)* 5(1Q3)* 6(1Q4)* 8(1Q5)*

### Notes on the sheet
- T2080 IFC INTERFACE
- 0_0010_0111: NOR FLASH BOOT
- 0_0100_0000: SD CARD BOOT
- cfg_rcw_src[0:8]
- 0_0100_0101: SPI BOOT
- 1_0001_1001: NAND FLASH BOOT
- cfg_rcw_src0
- cfg_rcw_src1
- cfg_rcw_src2
- cfg_rcw_src3
- cfg_rcw_src4
- cfg_rcw_src5
- cfg_rcw_src6
- cfg_rcw_src7
- cfg_test_port_dis
- cfg_rcw_src8
- cfg_ifc_te
- 1: TE logic 0
- cfg_pll_config_sel_b
- cfg_por_ainit
- cfg_svr0
- cfg_svr1
- cfg_dram_type
- For T2080 1: DDR3L
- cfg_rsp_dis
- CS0: NOR or NAND
- CS1: NAND or NOR
- CS2: CPLD
- ACB_0001_0
- (in symbol DIP_SWITCH_8) ON
- (in symbol T2080, part C) IFC; (OVDD)

### Library data of the parts
*#5 = Title_block_PPC: Title: T2080PCIe; Author: MICETEK; Page Create Date: March  8, 1995; Page Title: ?; Page Modify Date: *
C46-C49 = CAP NP_Dup3: as C24 on sheet 03B_DDR3_2; Part Type: Capacitors\Ceramic\SMD\0402; PCB Footprint: SMD_0402
R6 R9 R13 R15 R17 R21 R22 = R_Dup6: RESIS.CHIP 20K 1% 0402 SMD; Part Number: PASSIVE_641; Manufacturer 1: YAGEO; Manufacturer Part Number 1: RC0402FR-1320KL; RSM: RC0402; PCB Footprint: SMD_0402; Part Type: Resistors\Fixed\SMD\0402\1%
R7 R8 R10 R12 = R_Dup6: as R1 on sheet 03 DDR3; PCB Footprint: SMD_0402; Manufacturer Part Number 1: RESIS.CHIP 4,7K 5% 0402 SMD; Part Type: Resistors\Fixed\SMD\0402\5%
R11 R19 = R_Dup6: RESIS.CHIP 20K 1% 0402 SMD; Manufacturer Part Number 1: RC0402FR-1320KL; Manufacturer 1: YAGEO; Part Number: PASSIVE_641; RSM: RC0402; PCB Footprint: SMD_0402; Part Type: Resistors\Fixed\SMD\0402\1%
R14 R16 R18 R20 R23-R34 R38 R39 R48 = R_Dup6: RESIS.CHIP 4,7K 5% 0402 SMD; Part Number: PASSIVE_861; Manufacturer 1: ROYAL OHM; RSM: RC0402; PCB Footprint: SMD_0402; Part Type: Resistors\Fixed\SMD\0402\5%; Manufacturer Part Number 1: RESIS.CHIP 4,7K 5% 0402 SMD
R35-R37 R42-R45 R47 = R_Dup6: RESIS.CHIP 33R 5% 0402 SMD; Part Number: PASSIVE_853; Manufacturer 1: ROYAL OHM; RSM: RC0402; PCB Footprint: SMD_0402; Part Type: Resistors\Fixed\SMD\0402\5%; Manufacturer Part Number 1: RESIS.CHIP 33R 5% 0402 SMD
R40 R41 R46 = R_Dup6: RESIS.CHIP 33R 5% 0402 SMD; Manufacturer 1: ROYAL OHM; Part Number: PASSIVE_853; RSM: RC0402; PCB Footprint: SMD_0402; Manufacturer Part Number 1: RESIS.CHIP 33R 5% 0402 SMD; Part Type: Resistors\Fixed\SMD\0402\5%
R49 = R_Dup6: RESIS.CHIP 10R 5% 0402 SMD; Part Number: PASSIVE_811; Manufacturer 1: ROYAL OHM; RSM: RC0402; PCB Footprint: SMD_0402; Part Type: Resistors\Fixed\SMD\0402\5%; Manufacturer Part Number 1: RESIS.CHIP 10R 5% 0402 SMD
SW1 = DIP_SWITCH_8: SWITCH DIP SIP HALF 8POS SMD; Manufacturer 1: C&k; Part Number: CONNECTORS_645; RSM: DSW-GDH8; Distributor 1: MOUSER(611-TDA08H0SB1R); Manufacturer Part Number 1: TDA08H0SB1R; Part Type: DIPSWITCH; PCB Footprint: 2X8 PASSO 1.27mm
SW2 = DIP_SWITCH_8: SWITCH DIP SIP HALF 8POS SMD; Part Number: CONNECTORS_645; Manufacturer 1: C&k; RSM: DSW-GDH8; Part Type: DIPSWITCH; Manufacturer Part Number 1: TDA08H0SB1R; Distributor 1: MOUSER(611-TDA08H0SB1R); PCB Footprint: 2X8 PASSO 1.27mm
TP12 = T POINT R: TEST POINT SU PCB; Part Number: CONNECTORS_542; RSM: AE-TESTPOINT; Part Type: Tpoint; PCB Footprint: PCB
U1 = T2080: QRIQ MPU 1.87GT/s DDR3/3L 4x10GE; Part Number: MICROPROCESSOR_65; Manufacturer 1: NXP; Vendor: Freescale; PCB Footprint: BGA896; RSM: PBGA896-0_8MM-25X25; TYPE: IC; MPN: T2080; Part Type: 32 BIT; Manufacturer Part Number 1: T2080NXN8PTB; Distributor 1: MOUSER(841-T2080NXN8PTB)
U2 = 74LVC16373: IC TRANS D-TYP LATCH 3ST 48TSSOP; Part Number: LOGIC_350; Manufacturer 1: TEXAS; Vendor: TI; PCB Footprint: TSSOP-48; MPN: SN74LVC16373ADGGR; TYPE: IC; Part Type: LVC\STD; Manufacturer Part Number 1: SN74LVC16373ADGGR; Distributor 1: DIGIKEY(296-13241-1-ND); RSM: TSSOP-48

## Sheet 05 Flash.SchDoc
size 420 x 297 mm
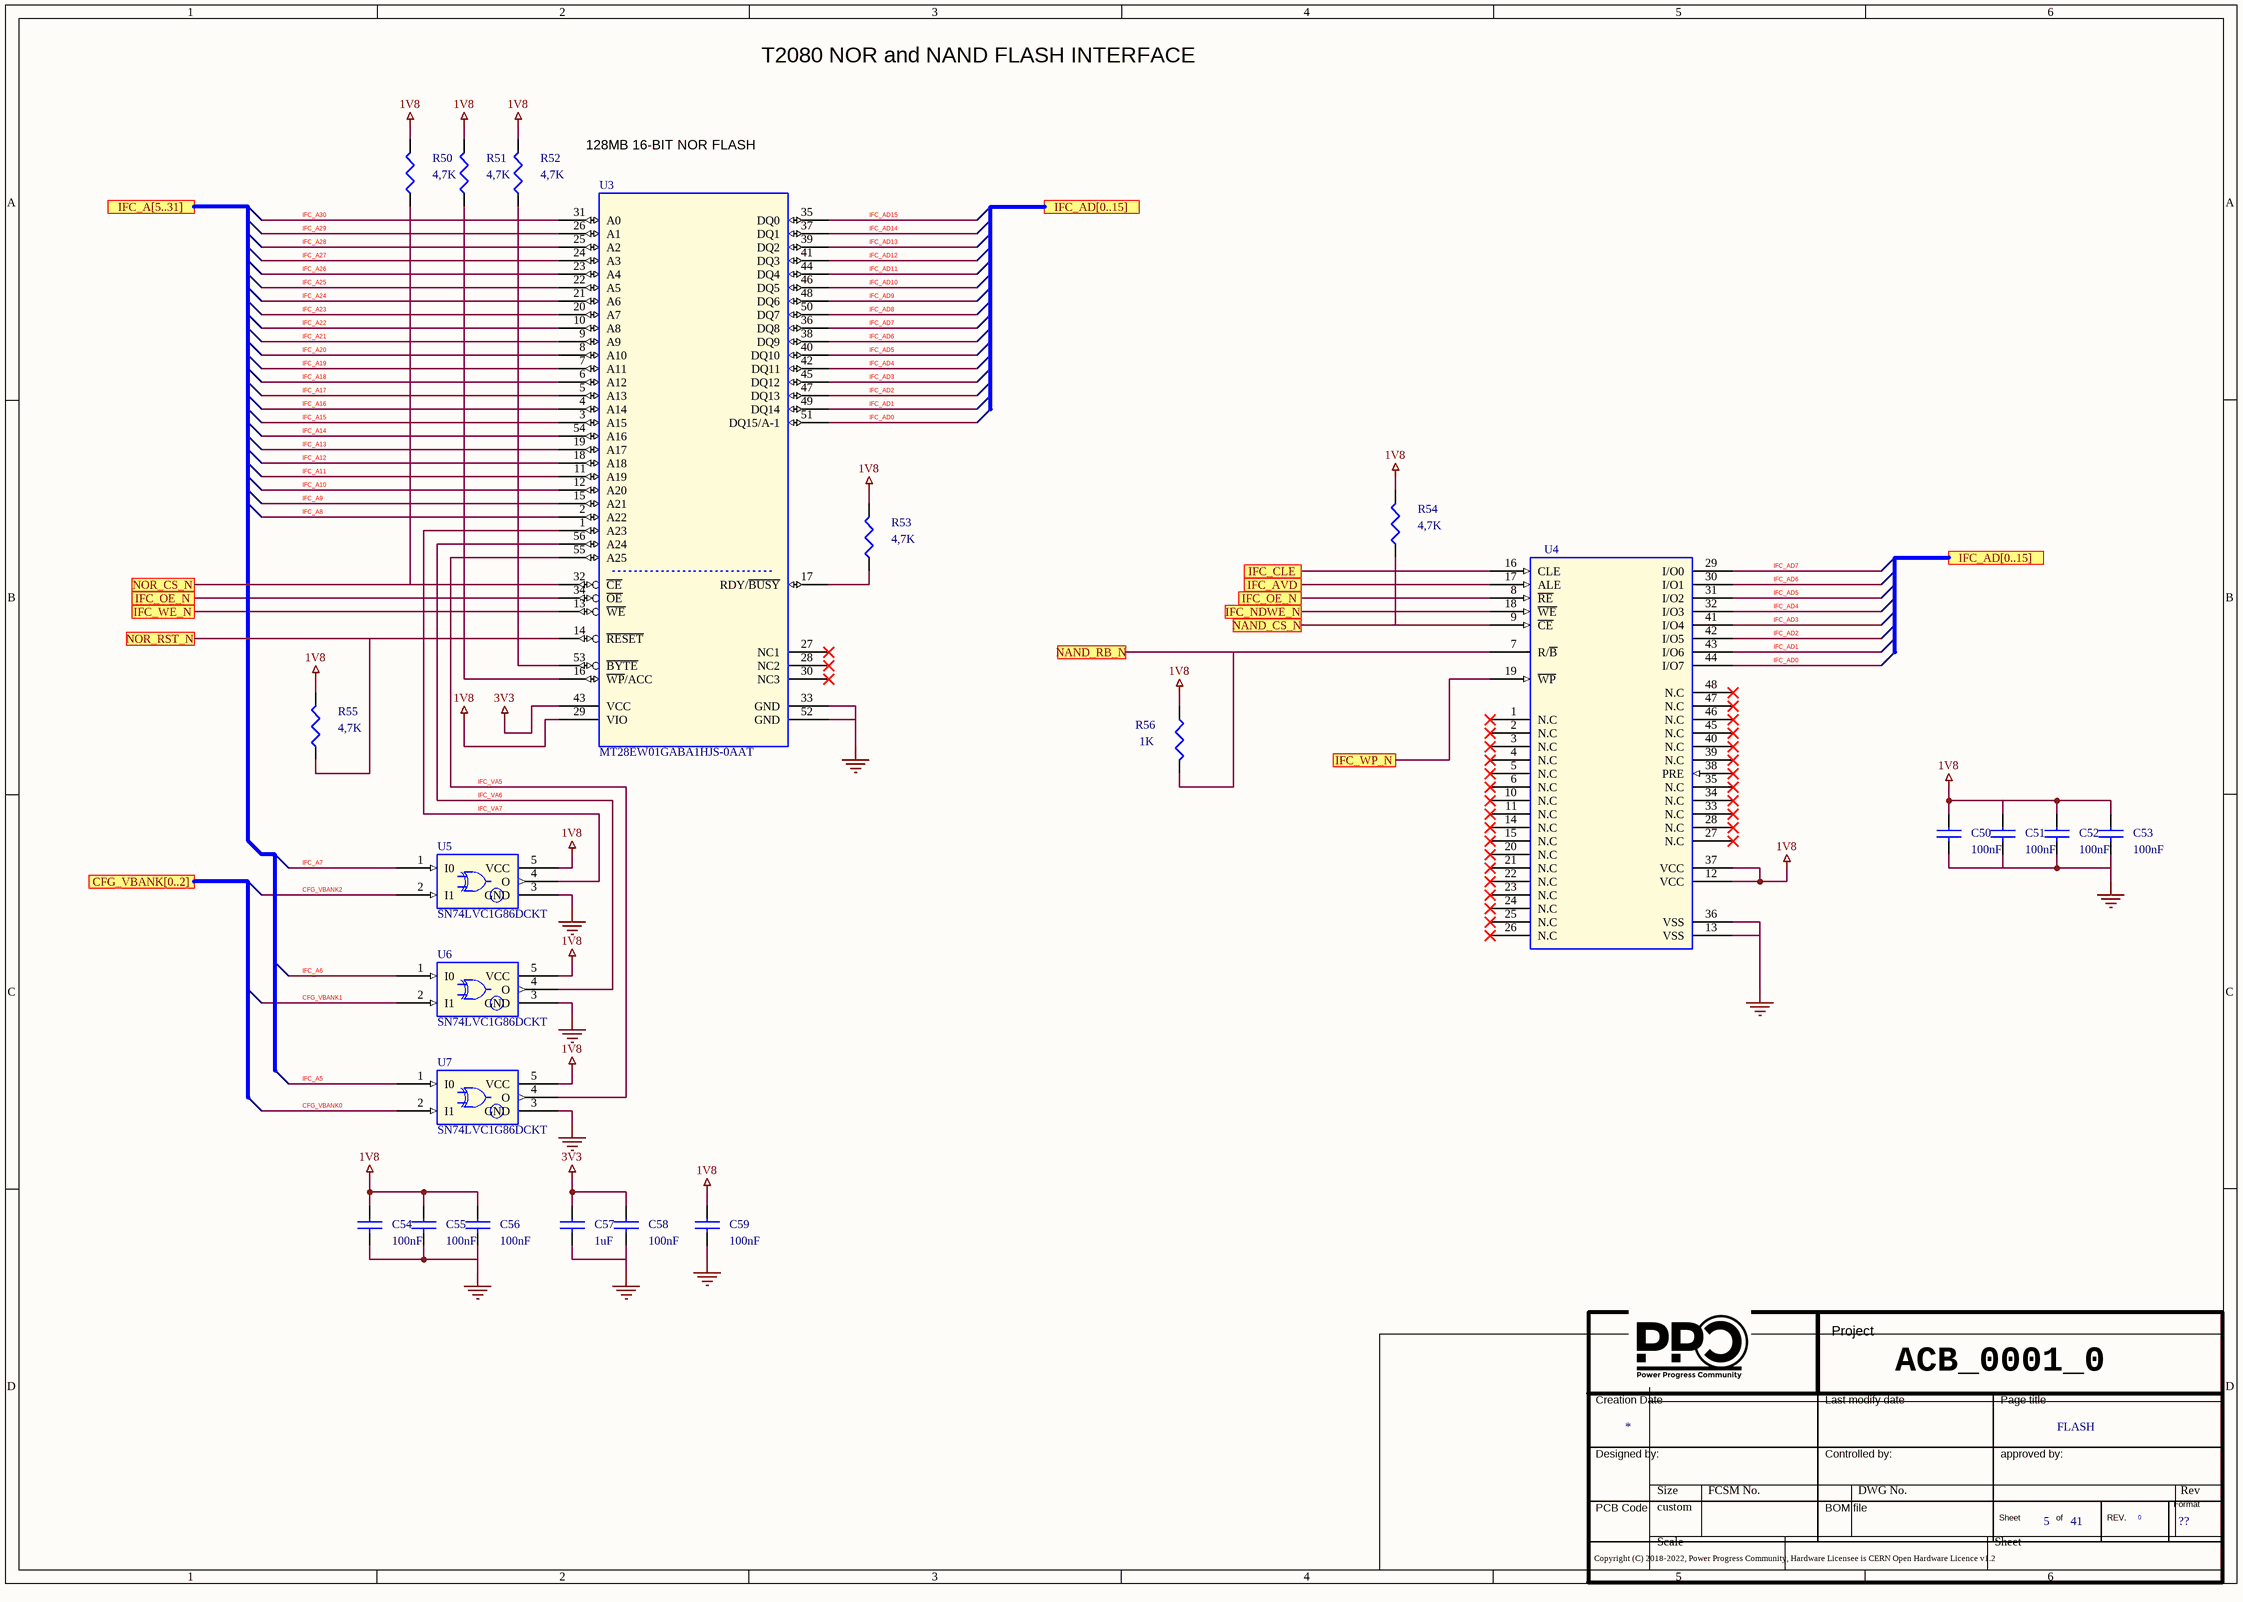
[diagram p13: 05 Flash.SchDoc]

### Parts
(Parts that share a designator on the sheet are numbered #1, #2 ... from top to bottom, then left to right.)
*#6  Doc: FLASH  Page Count: 41  Page Number: 5  Page Size: ??  RevCode: 0  (hidden comment: Title_block_PPC)  (graphical)
C50  100nF  [SMD_0402]
C51  100nF  [SMD_0402]
C52  100nF  [SMD_0402]
C53  100nF  [SMD_0402]
C54  100nF  [SMD_0402]
C55  100nF  [SMD_0402]
C56  100nF  [SMD_0402]
C57  1uF  [SMD_0402]
C58  100nF  [SMD_0402]
C59  100nF  [SMD_0402]
R50  4,7K  [SMD_0402]
R51  4,7K  [SMD_0402]
R52  4,7K  [SMD_0402]
R53  4,7K  [SMD_0402]
R54  4,7K  [SMD_0402]
R55  4,7K  [SMD_0402]
R56  1K  [SMD_0402]
U3  MT28EW01GABA1HJS-0AAT  [tsop1_56]
U4  MT29F4G08ABADAWP-IT:D  [TSOP_48]  (value not drawn)
U5  SN74LVC1G86DCKT  [sc70_5]
U6  SN74LVC1G86DCKT  [sc70_5]
U7  SN74LVC1G86DCKT  [sc70_5]

### Ports
CFG_VBANK[0..2], IFC_A[5..31], IFC_AD[0..15], IFC_AVD, IFC_CLE, IFC_NDWE_N, IFC_OE_N, IFC_WE_N, IFC_WP_N, NAND_CS_N, NAND_RB_N, NOR_CS_N, NOR_RST_N

### Nets
1V8: C50.1 C51.1 C52.1 C53.1 C54.1 C55.1 C56.1 C59.1 R50.2 R51.2 R52.2 R53.2 R54.2 R55.2 R56.2 U3.29(VIO) U4.12(VCC) U4.37(VCC) U5.5(VCC) U6.5(VCC) U7.5(VCC)
3V3: C57.1 C58.1 U3.43(VCC)
GND: C50.2 C51.2 C52.2 C53.2 C54.2 C55.2 C56.2 C57.2 C58.2 C59.2 U3.33(GND) U3.52(GND) U4.13(VSS) U4.36(VSS) U5.3(GND) U6.3(GND) U7.3(GND)
CFG_VBANK0: U7.2(I1)
CFG_VBANK1: U6.2(I1)
CFG_VBANK2: U5.2(I1)
IFC_A5: U7.1(I0)
IFC_A6: U6.1(I0)
IFC_A7: U5.1(I0)
IFC_A8: U3.2(A22)
IFC_A9: U3.15(A21)
IFC_A10: U3.12(A20)
IFC_A11: U3.11(A19)
IFC_A12: U3.18(A18)
IFC_A13: U3.19(A17)
IFC_A14: U3.54(A16)
IFC_A15: U3.3(A15)
IFC_A16: U3.4(A14)
IFC_A17: U3.5(A13)
IFC_A18: U3.6(A12)
IFC_A19: U3.7(A11)
IFC_A20: U3.8(A10)
IFC_A21: U3.9(A9)
IFC_A22: U3.10(A8)
IFC_A23: U3.20(A7)
IFC_A24: U3.21(A6)
IFC_A25: U3.22(A5)
IFC_A26: U3.23(A4)
IFC_A27: U3.24(A3)
IFC_A28: U3.25(A2)
IFC_A29: U3.26(A1)
IFC_A30: U3.31(A0)
IFC_AD0: U3.51(DQ15/A-1) U4.44(I/O7)
IFC_AD1: U3.49(DQ14) U4.43(I/O6)
IFC_AD2: U3.47(DQ13) U4.42(I/O5)
IFC_AD3: U3.45(DQ12) U4.41(I/O4)
IFC_AD4: U3.42(DQ11) U4.32(I/O3)
IFC_AD5: U3.40(DQ10) U4.31(I/O2)
IFC_AD6: U3.38(DQ9) U4.30(I/O1)
IFC_AD7: U3.36(DQ8) U4.29(I/O0)
IFC_AD8: U3.50(DQ7)
IFC_AD9: U3.48(DQ6)
IFC_AD10: U3.46(DQ5)
IFC_AD11: U3.44(DQ4)
IFC_AD12: U3.41(DQ3)
IFC_AD13: U3.39(DQ2)
IFC_AD14: U3.37(DQ1)
IFC_AD15: U3.35(DQ0)
IFC_VA5: U3.55(A25) U7.4(O)
IFC_VA6: U3.56(A24) U6.4(O)
IFC_VA7: U3.1(A23) U5.4(O)
NetR50_1: R50.1 U3.32(~{CE}) ; port NOR_CS_N
NetR51_1: R51.1 U3.16(~{WP}/ACC)
NetR52_1: R52.1 U3.53(~{BYTE})
NetR53_1: R53.1 U3.17(RDY/~{BUSY})
NetR54_1: R54.1 U4.9(~{CE}) ; port NAND_CS_N
NetR55_1: R55.1 U3.14(~{RESET}) ; port NOR_RST_N
NetR56_1: R56.1 U4.7(R/~{B}) ; port NAND_RB_N
NetU1_A18: U4.19(~{WP}) ; port IFC_WP_N
NetU1_C17: U4.17(ALE) ; port IFC_AVD
NetU1_D17: U3.13(~{WE}) ; port IFC_WE_N
NetU1_D18: U4.18(~{WE}) ; port IFC_NDWE_N
NetU1_G18: U3.34(~{OE}) U4.8(~{RE}) ; port IFC_OE_N
NetU1_H19: U4.16(CLE) ; port IFC_CLE

Not connected (* = marked no-connect by the designer): U3 27(NC1)* 28(NC2)* 30(NC3)*; U4 1(N.C)* 2(N.C)* 3(N.C)* 4(N.C)* 5(N.C)* 6(N.C)* 10(N.C)* 11(N.C)* 14(N.C)* 15(N.C)* 20(N.C)* 21(N.C)* 22(N.C)* 23(N.C)* 24(N.C)* 25(N.C)* 26(N.C)* 27(N.C)* 28(N.C)* 33(N.C)* 34(N.C)* 35(N.C)* 38(PRE)* 39(N.C)* 40(N.C)* 45(N.C)* 46(N.C)* 47(N.C)* 48(N.C)*

### Notes on the sheet
- T2080 NOR and NAND FLASH INTERFACE
- 128MB 16-BIT NOR FLASH
- ACB_0001_0

### Library data of the parts
*#6 = Title_block_PPC: Title: T2080PCIe; Author: MICETEK; Page Create Date: March  8, 1995; Page Title: ?; Page Modify Date: *
C50-C56 C58 C59 = CAP NP_Dup3: as C24 on sheet 03B_DDR3_2; Part Type: Capacitors\Ceramic\SMD\0402; PCB Footprint: SMD_0402
C57 = CAP NP_Dup3: CAP CER 1UF 25V X6S 0402; Part Number: PASSIVE_1446; Manufacturer 1: Murata; Manufacturer Part Number 1: GRM155C81E105KE11D; RSM: RC0402; Part Type: Capacitors\Ceramic\SMD\0402; PCB Footprint: SMD_0402
R50-R55 = R_Dup6: as R1 on sheet 03 DDR3; Manufacturer Part Number 1: RESIS.CHIP 4,7K 5% 0402 SMD; Part Type: Resistors\Fixed\SMD\0402\5%; PCB Footprint: SMD_0402
R56 = R_Dup6: as R2 on sheet 03 DDR3; Part Type: Resistors\Fixed\SMD\0402\1%; Manufacturer Part Number 1: RESIS.CHIP 1K 1% 0402 SMD; PCB Footprint: SMD_0402
U3 = FLASH-NOR-64Mx16: NOR Flash EW-SERIES FLASH NOR SLC 64MX16 TSOP; MPN: JS28F00AM29EWHA; Part Number: MEMORIES_103; Vendor: Micron; PCB Footprint: TSOP-56; TYPE: IC; Part Type: FLASH; Manufacturer 1: Micron; Manufacturer Part Number 1: MT28EW01GABA1HJS-0AAT; Distributor 1: MOUSER(340-279939-TRAY); RSM: TSOP-56
U4 = K9F2G08U0M-PCB0: IC NAND FLASH 4GB 3.3V 48-TSOP LONGEVITY; Part Number: MEMORIES_36; Manufacturer 1: Micron; RSM: TSOP-48; PCB Footprint: TSOP_48; Part Type: FLASH; Manufacturer Part Number 1: MT29F4G08ABADAWP-IT:D; Distributor 1: AVNET EXPRESS
U5-U7 = 74LVC1G86: Porte logiche SNGL 2 Input Exclusive OR Gate; Manufacturer 1: TEXAS; Part Number: LOGIC_348; MPN: SN74LVC1G86DCKR; PCB Footprint: sc70-5; Vendor: TI; RSM: SC-70-5; Distributor 1: MOUSER(595-SN74LVC1G86DCKT); Manufacturer Part Number 1: SN74LVC1G86DCKT; Part Type: LVC\SINGLE GATE; TYPE: IC

## Sheet 06 SPI&SDHC.SchDoc
size 420 x 297 mm
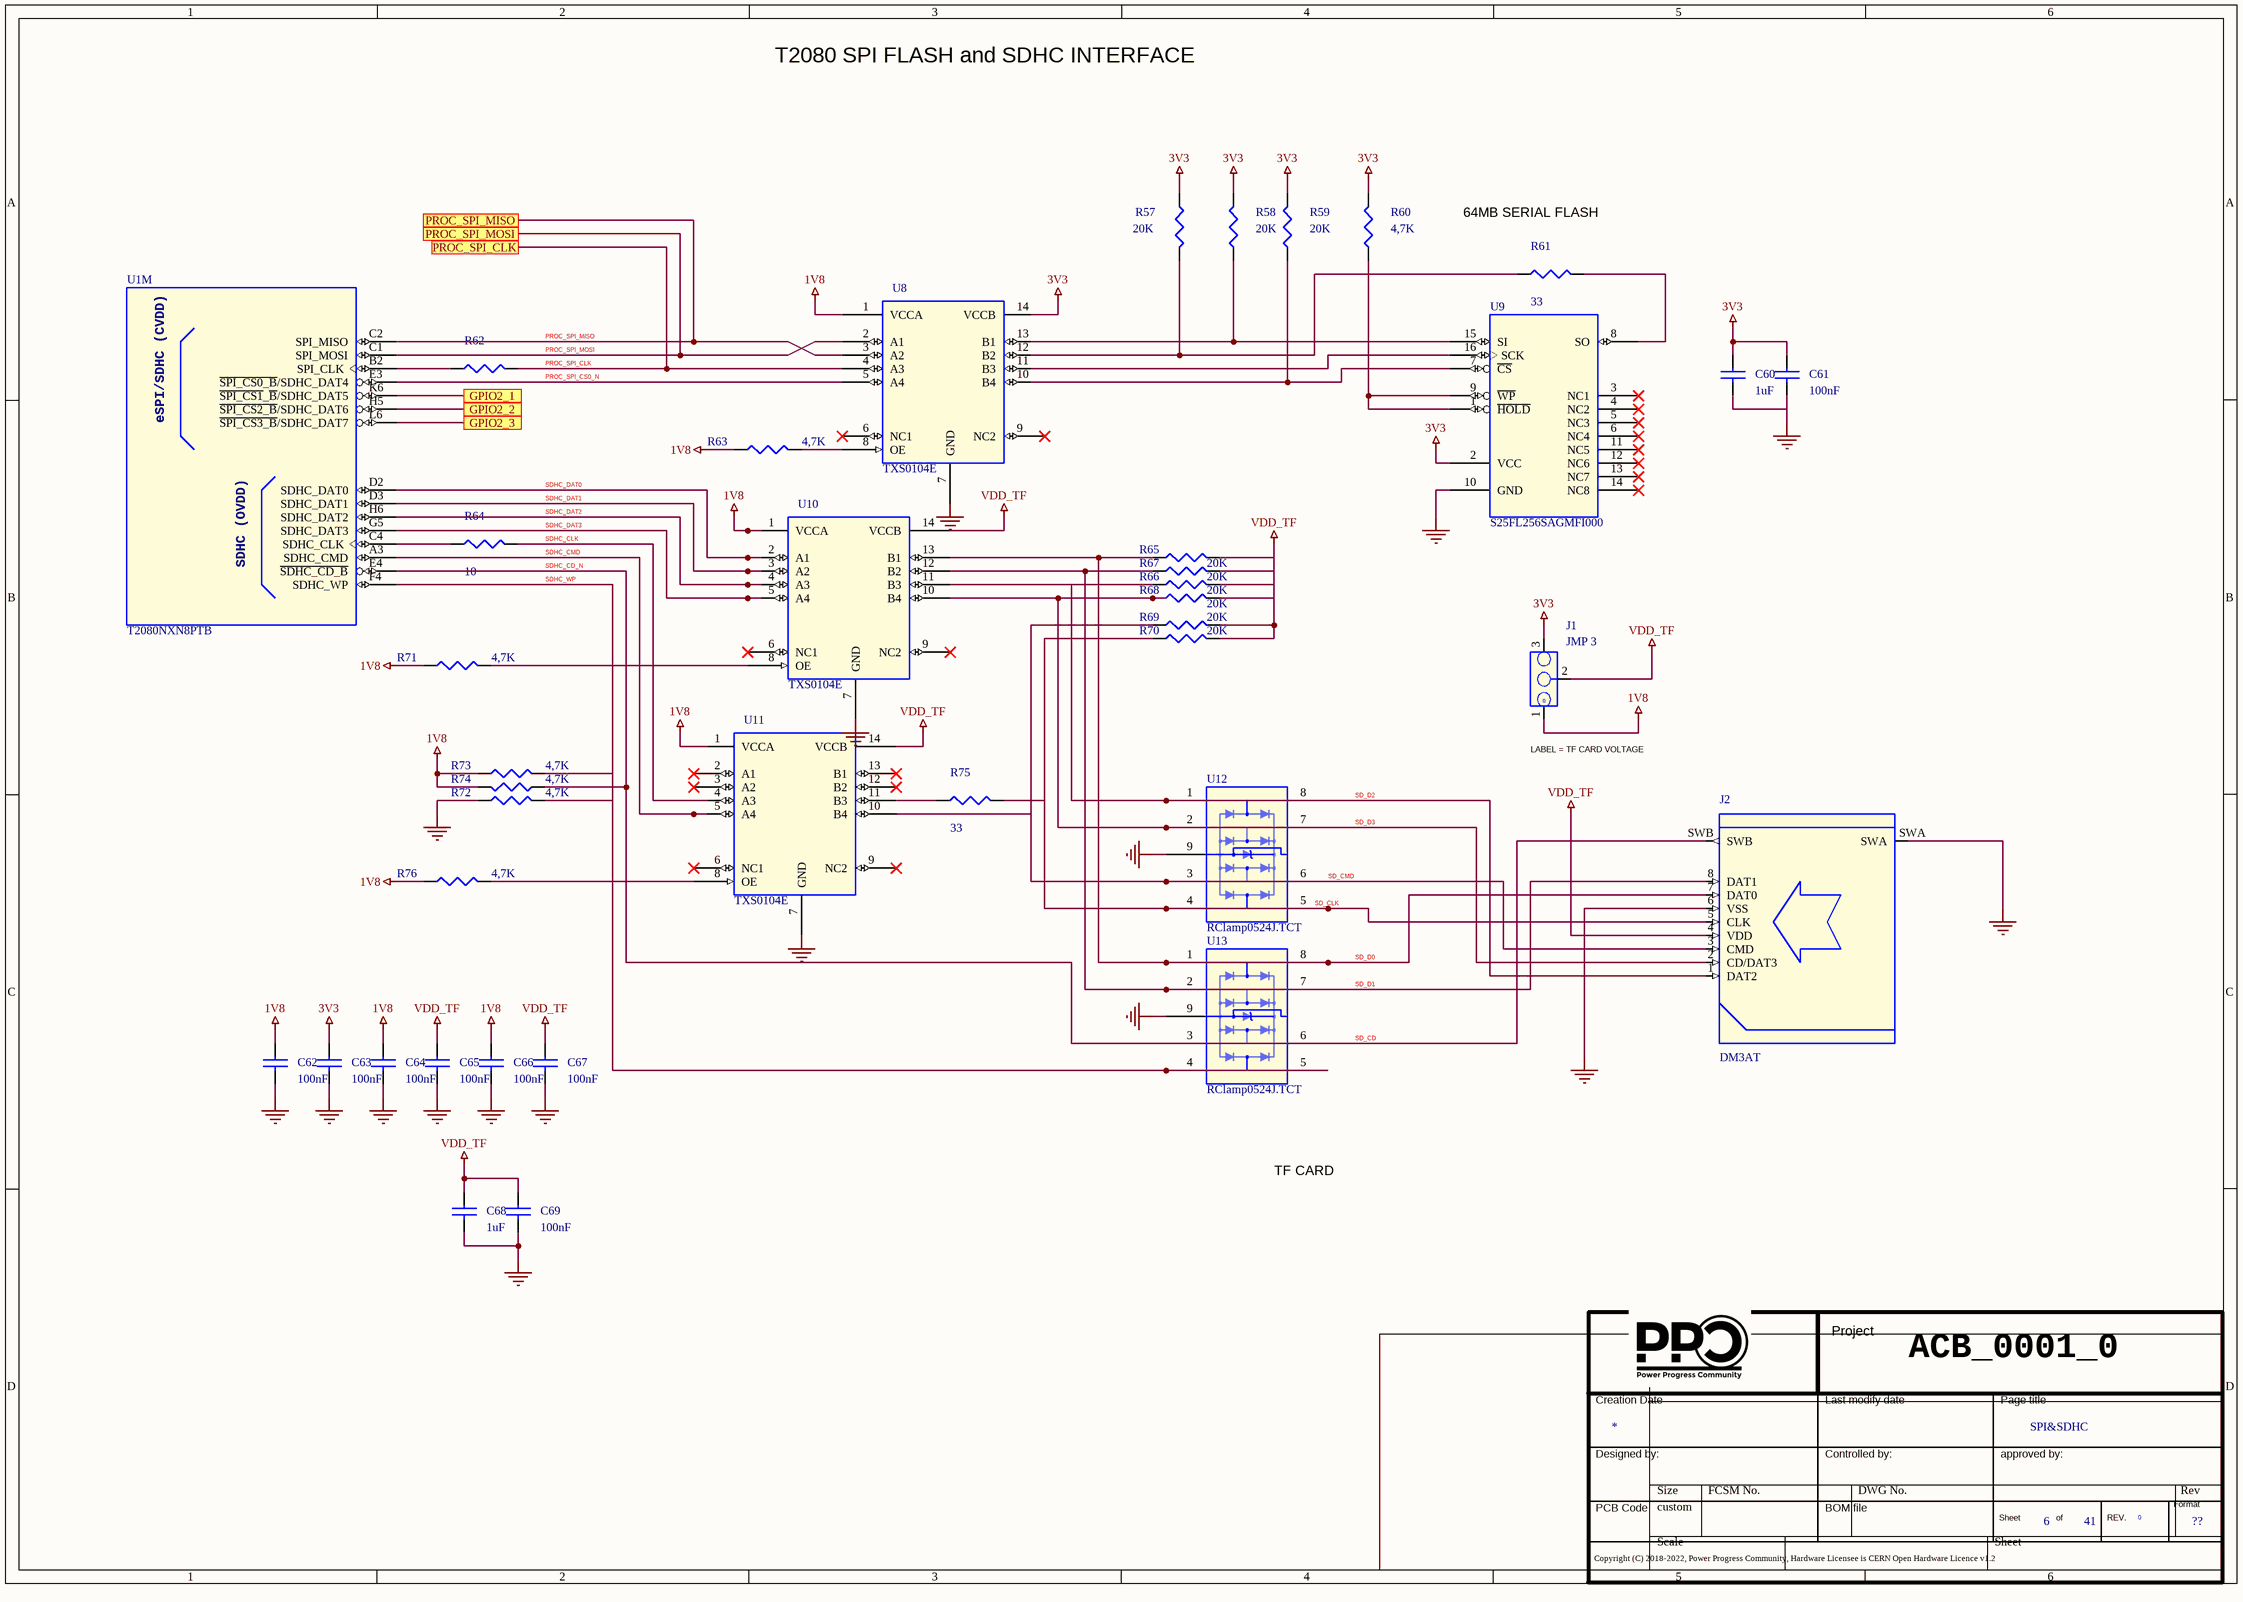
[diagram p14: 06 SPI&SDHC.SchDoc]

### Parts
(Parts that share a designator on the sheet are numbered #1, #2 ... from top to bottom, then left to right.)
*#7  Doc: SPI&SDHC  Page Count: 41  Page Number: 6  Page Size: ??  RevCode: 0  (hidden comment: Title_block_PPC)  (graphical)
C60  1uF  [SMD_0402]
C61  100nF  [SMD_0402]
C62  100nF  [SMD_0402]
C63  100nF  [SMD_0402]
C64  100nF  [SMD_0402]
C65  100nF  [SMD_0402]
C66  100nF  [SMD_0402]
C67  100nF  [SMD_0402]
C68  1uF  [SMD_0402]
C69  100nF  [SMD_0402]
J1  JMP 3  [PTH]
J2  DM3AT  [USD_SMD]
R57  20K  [SMD_0402]
R58  20K  [SMD_0402]
R59  20K  [SMD_0402]
R60  4,7K  [SMD_0402]
R61  33  [SMD_0402]
R62  10  [SMD_0402]
R63  4,7K  [SMD_0402]
R64  10  [SMD_0402]
R65  20K  [SMD_0402]
R66  20K  [SMD_0402]
R67  20K  [SMD_0402]
R68  20K  [SMD_0402]
R69  20K  [SMD_0402]
R70  20K  [SMD_0402]
R71  4,7K  [SMD_0402]
R72  4,7K  [SMD_0402]
R73  4,7K  [SMD_0402]
R74  4,7K  [SMD_0402]
R75  33  [SMD_0402]
R76  4,7K  [SMD_0402]
U1  T2080NXN8PTB  [bga]  (part M of 14)
U8  TXS0104E  [TSSOP14]
U9  S25FL256SAGMFI000  [so_16l]
U10  TXS0104E  [TSSOP14]
U11  TXS0104E  [TSSOP14]
U12  RClamp0524J.TCT  [tvs_slp2710p8]
U13  RClamp0524J.TCT  [tvs_slp2710p8]

### Ports
GPIO2_1, GPIO2_2, GPIO2_3, PROC_SPI_CLK, PROC_SPI_MISO, PROC_SPI_MOSI

### Nets
1V8: C62.1 C64.1 C66.1 J1.1 R63.1 R71.1 R73.1 R74.2 R76.1 U8.1(VCCA) U10.1(VCCA) U11.1(VCCA)
3V3: C60.1 C61.1 C63.1 J1.3 R57.2 R58.2 R59.2 R60.2 U8.14(VCCB) U9.2(VCC)
GND: C60.2 C61.2 C62.2 C63.2 C64.2 C65.2 C66.2 C67.2 C68.2 C69.2 J2.6(VSS) J2.SWA R72.1 U8.7(GND) U9.10(GND) U10.7(GND) U11.7(GND) U12.9 U13.9
VDD_TF: C65.1 C67.1 C68.1 C69.1 J1.2 J2.4(VDD) R65.2 R66.2 R67.2 R68.2 R69.2 R70.2 U10.14(VCCB) U11.14(VCCB)
PROC_SPI_CLK: R62.2 U8.4(A3) ; port PROC_SPI_CLK
PROC_SPI_CS0_N: U1.E3(~{SPI_CS0_B}/SDHC_DAT4) U8.5(A4)
PROC_SPI_MISO: U1.C2(SPI_MISO) U8.3(A2) ; port PROC_SPI_MISO
PROC_SPI_MOSI: U1.C1(SPI_MOSI) U8.2(A1) ; port PROC_SPI_MOSI
SD_CD: J2.SWB R74.1 U1.E4(~{SDHC_CD_B}) U13.3 U13.6  [also labelled SDHC_CD_N]
SD_CLK: J2.5(CLK) R70.1 R75.2 U12.4 U12.5
SD_CMD: J2.3(CMD) R69.1 U11.10(B4) U12.3 U12.6
SD_D0: J2.7(DAT0) R65.1 U10.13(B1) U13.1 U13.8
SD_D1: J2.8(DAT1) R67.1 U10.12(B2) U13.2 U13.7
SD_D2: J2.1(DAT2) R66.1 U10.11(B3) U12.1 U12.8
SD_D3: J2.2(CD/DAT3) R68.1 U10.10(B4) U12.2 U12.7
SDHC_CLK: R64.2 U11.4(A3)
SDHC_CMD: U1.A3(SDHC_CMD) U11.5(A4)
SDHC_DAT0: U1.D2(SDHC_DAT0) U10.2(A1)
SDHC_DAT1: U1.D3(SDHC_DAT1) U10.3(A2)
SDHC_DAT2: U1.H6(SDHC_DAT2) U10.4(A3)
SDHC_DAT3: U1.G5(SDHC_DAT3) U10.5(A4)
SDHC_WP: R72.2 R73.2 U1.F4(SDHC_WP) U13.4 U13.5
NetR57_1: R57.1 R61.1 U8.12(B2)
NetR58_1: R58.1 U8.13(B1) U9.15(SI)
NetR59_1: R59.1 U8.10(B4) U9.7(~{CS})
NetR60_1: R60.1 U9.1(~{HOLD}) U9.9(~{WP})
NetR61_2: R61.2 U9.8(SO)
NetR62_1: R62.1 U1.B2(SPI_CLK)
NetR63_2: R63.2 U8.8(OE)
NetR64_1: R64.1 U1.C4(SDHC_CLK)
NetR71_2: R71.2 U10.8(OE)
NetR75_1: R75.1 U11.11(B3)
NetR76_2: R76.2 U11.8(OE)
NetU1_H5: U1.H5(~{SPI_CS2_B}/SDHC_DAT6) ; port GPIO2_2
NetU1_K6: U1.K6(~{SPI_CS1}_~{B}/SDHC_DAT5) ; port GPIO2_1
NetU1_L6: U1.L6(~{SPI_CS3_B}/SDHC_DAT7) ; port GPIO2_3
NetU8_11: U8.11(B3) U9.16(SCK)

Not connected (* = marked no-connect by the designer): U8 6(NC1)* 9(NC2)*; U9 3(NC1)* 4(NC2)* 5(NC3)* 6(NC4)* 11(NC5)* 12(NC6)* 13(NC7)* 14(NC8)*; U10 6(NC1)* 9(NC2)*; U11 2(A1)* 3(A2)* 6(NC1)* 9(NC2)* 12(B2)* 13(B1)*

### Notes on the sheet
- T2080 SPI FLASH and SDHC INTERFACE
- (near R61) 64MB SERIAL FLASH
- (near J1) LABEL = TF CARD VOLTAGE
- TF CARD
- ACB_0001_0
- (in symbol T2080, part M) eSPI/SDHC (CVDD); SDHC (OVDD)

### Library data of the parts
*#7 = Title_block_PPC: Title: T2080PCIe; Author: MICETEK; Page Create Date: March  8, 1995; Page Title: ?; Page Modify Date: *
C60 = CAP NP_Dup3: as C57 on sheet 05 Flash; Part Type: Capacitors\Ceramic\SMD\0402; PCB Footprint: SMD_0402
C61 = CAP NP_Dup3: as C1 on sheet 03 DDR3; PCB Footprint: SMD_0402; Part Type: Capacitors\Ceramic\SMD\0402
C62-C67 C69 = CAP NP_Dup3: as C24 on sheet 03B_DDR3_2; Part Type: Capacitors\Ceramic\SMD\0402; PCB Footprint: SMD_0402
C68 = CAP NP_Dup3: CAP CER 1UF 25V X6S 0402; Manufacturer Part Number 1: GRM155C81E105KE11D; Manufacturer 1: Murata; Part Number: PASSIVE_1446; RSM: RC0402; Part Type: Capacitors\Ceramic\SMD\0402; PCB Footprint: SMD_0402
J1 = JUMPER_3: STRIP MASC.1x3P CS.p=2 mm; Manufacturer Part Number 1: 951103-8622-AR; Manufacturer 1: 3M; Part Number: CONNECTORS_446; RSM: PIN-2MM-3; Distributor 1: DIGIKEY(3M9322-ND); Part Type: Strip\Terminal; PCB Footprint: PTH
J2 = MicroSD Card Socket_1: CONN MICRO SD R/A PUSH-PULL SMD; Manufacturer: Hirose; Manufacturer p/n: DM3CS-SF; Part Number: CONNECTORS_330; Manufacturer Part Number 1: DM3AT-SF; RSM: HIROSE-DM3-AT; PCB Footprint: SMD 9 PIN; Distributer: Digikey; Distributer p/n: HR1972CT-ND; Part Type: SOCKET\MICRO_SD; Manufacturer 1: HIROSE; Distributor 1: DIGIKEY (HR1964CT-ND)
R57 R59 R65-R68 R70 = R_Dup6: as R11 on sheet 04 IFC; Part Type: Resistors\Fixed\SMD\0402\1%; PCB Footprint: SMD_0402
R58 R69 = R_Dup6: as R6 on sheet 04 IFC; Part Type: Resistors\Fixed\SMD\0402\1%; PCB Footprint: SMD_0402
R60 R71-R74 = R_Dup6: as R1 on sheet 03 DDR3; Manufacturer Part Number 1: RESIS.CHIP 4,7K 5% 0402 SMD; Part Type: Resistors\Fixed\SMD\0402\5%; PCB Footprint: SMD_0402
R61 R75 = R_Dup6: as R40 on sheet 04 IFC; Manufacturer Part Number 1: RESIS.CHIP 33R 5% 0402 SMD; Part Type: Resistors\Fixed\SMD\0402\5%; PCB Footprint: SMD_0402
R62 R64 = R_Dup6: RESIS.CHIP 10R 5% 0402 SMD; Manufacturer 1: ROYAL OHM; Part Number: PASSIVE_811; RSM: RC0402; PCB Footprint: SMD_0402; Manufacturer Part Number 1: RESIS.CHIP 10R 5% 0402 SMD; Part Type: Resistors\Fixed\SMD\0402\5%
R63 R76 = R_Dup6: as R14 on sheet 04 IFC; PCB Footprint: SMD_0402; Part Type: Resistors\Fixed\SMD\0402\5%; Manufacturer Part Number 1: RESIS.CHIP 4,7K 5% 0402 SMD
U1 = T2080: QRIQ MPU 1.87GT/s DDR3/3L 4x10GE; Manufacturer 1: NXP; Part Number: MICROPROCESSOR_65; PCB Footprint: BGA896; Vendor: Freescale; RSM: PBGA896-0_8MM-26X25; Distributor 1: MOUSER(841-T2080NXN8PTB); Manufacturer Part Number 1: T2080NXN8PTB; Part Type: 32 BIT; MPN: T2080; TYPE: IC
U8 = TXS0104E: BIDIRECTIONAL VOLTAGE-LEVEL TRANSLATOR; Manufacturer Part Number 1: TXS0104EPWR; Manufacturer 1: TEXAS; Part Number: LOGIC_264; RSM: TSSOP-14; PCB Footprint: TSSOP14; Distributor 1: TI.COM; Part Type: TRANSLATOR
U9 = FLASH-SERIAL-SO16: IC FLASH 256M SPI 133MHZ 16SOIC; Manufacturer 1: CYPRESS; Part Number: MEMORIES_102; MPN: N25Q512A13GSF40F; PCB Footprint: SOIC_16; Vendor: Micron; RSM: SO-16; Distributor 1: DIGIKEY(1274-1003-ND); Manufacturer Part Number 1: S25FL256SAGMFI000; Part Type: FLASH; TYPE: IC
U10 U11 = TXS0104E: BIDIRECTIONAL VOLTAGE-LEVEL TRANSLATOR; Part Number: LOGIC_264; Manufacturer 1: TEXAS; Manufacturer Part Number 1: TXS0104EPWR; RSM: TSSOP-14; PCB Footprint: TSSOP14; Part Type: TRANSLATOR; Distributor 1: TI.COM
U12 = RClamp0524J: TVS DIODE 5V 15V SLP2710P8; Manufacturer 1: Semtec; Part Number: DISCRETE_321; Vendor: Sentech; PCB Footprint: 10-UFDFN; RSM: SLP2710; Distributor 1: DIGIKEY(RCLAMP0524JCT-ND); Manufacturer Part Number 1: RClamp0524J.TCT; Part Type: Protections; TYPE: IC; MPN: RClamp0524J.TCT
U13 = RClamp0524J: TVS DIODE 5V 15V SLP2710P8; Part Number: DISCRETE_321; Manufacturer 1: Semtec; Vendor: Sentech; PCB Footprint: 10-UFDFN; TYPE: IC; MPN: RClamp0524J.TCT; Part Type: Protections; Manufacturer Part Number 1: RClamp0524J.TCT; Distributor 1: DIGIKEY(RCLAMP0524JCT-ND); RSM: SLP2710